# EAGLE schematic IoT4Bees-Ctrl_1V0 (EAGLE 7.7.0)
Assembly variants: Max, Std

## Sheet 1 of 22: MCU
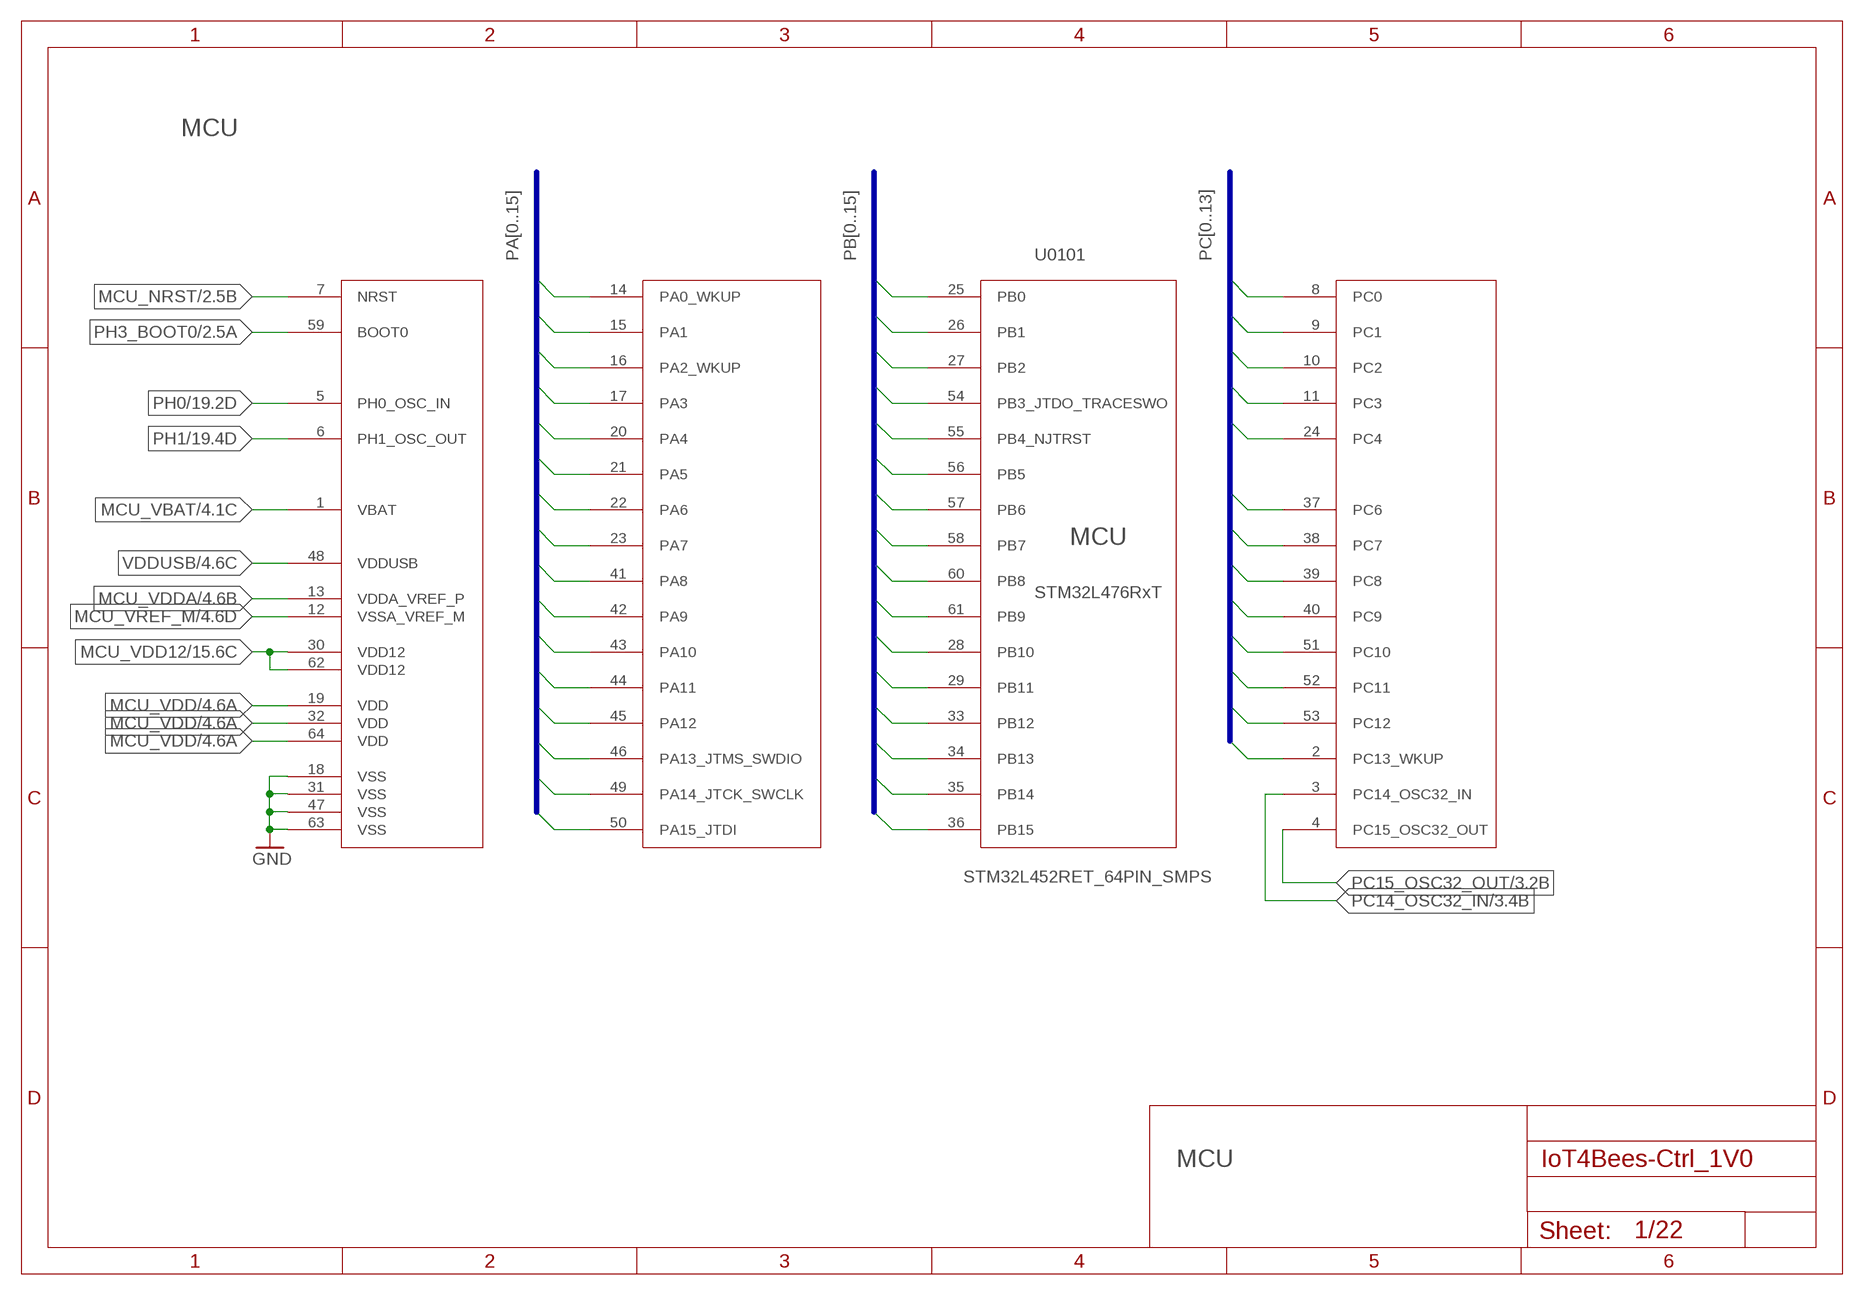
[diagram p0: schematic, sheet 1]

### Parts
U0101  STM32L452RET_64PIN_SMPS  [LQFP64]

### Nets
GND: U0101.18(VSS) U0101.31(VSS) U0101.47(VSS) U0101.63(VSS) ; also sheet 2,3,4,6,7,8,9,10,11,12,13,14,15,16,17,18,19,20,21,22
MCU_NRST: U0101.7(NRST) ; also sheet 2
MCU_VBAT: U0101.1(VBAT) ; also sheet 4
MCU_VDD: U0101.19(VDD) U0101.32(VDD) U0101.64(VDD) ; also sheet 4
MCU_VDD12: U0101.30(VDD12) U0101.62(VDD12) ; also sheet 15
MCU_VDDA: U0101.13(VDDA_VREF_P) ; also sheet 4
MCU_VREF_M: U0101.12(VSSA_VREF_M) ; also sheet 4
PA0: U0101.14(PA0_WKUP) ; also sheet 20
PA1: U0101.15(PA1) ; also sheet 21
PA2: U0101.16(PA2_WKUP) ; also sheet 21
PA3: U0101.17(PA3)
PA4: U0101.20(PA4) ; also sheet 4
PA5: U0101.21(PA5) ; also sheet 21
PA6: U0101.22(PA6) ; also sheet 21
PA7: U0101.23(PA7) ; also sheet 21
PA8: U0101.41(PA8) ; also sheet 15
PA9: U0101.42(PA9) ; also sheet 5,6,7,8,11,21
PA10: U0101.43(PA10) ; also sheet 5,6,7,8,11,21
PA11: U0101.44(PA11) ; also sheet 12
PA12: U0101.45(PA12) ; also sheet 12
PA13: U0101.46(PA13_JTMS_SWDIO) ; also sheet 2
PA14: U0101.49(PA14_JTCK_SWCLK) ; also sheet 2
PA15: U0101.50(PA15_JTDI)
PB0: U0101.25(PB0) ; also sheet 18
PB1: U0101.26(PB1) ; also sheet 21
PB2: U0101.27(PB2)
PB3: U0101.54(PB3_JTDO_TRACESWO)
PB4: U0101.55(PB4_NJTRST)
PB5: U0101.56(PB5) ; also sheet 16
PB6: U0101.57(PB6) ; also sheet 12
PB7: U0101.58(PB7) ; also sheet 12
PB8: U0101.60(PB8) ; also sheet 20
PB9: U0101.61(PB9)
PB10 [mil6_nofill]: U0101.28(PB10) ; also sheet 21
PB11: U0101.29(PB11) ; also sheet 21
PB12: U0101.33(PB12) ; also sheet 17
PB13 [mil6_nofill]: U0101.34(PB13) ; also sheet 21
PB14: U0101.35(PB14) ; also sheet 14
PB15: U0101.36(PB15) ; also sheet 15
PC0 [mil6_nofill]: U0101.8(PC0) ; also sheet 21
PC1: U0101.9(PC1) ; also sheet 21
PC2 [mil6_nofill]: U0101.10(PC2) ; also sheet 21
PC3: U0101.11(PC3) ; also sheet 21
PC4: U0101.24(PC4) ; also sheet 18,21
PC6: U0101.37(PC6)
PC7: U0101.38(PC7) ; also sheet 11
PC8: U0101.39(PC8) ; also sheet 8
PC9: U0101.40(PC9) ; also sheet 7
PC10: U0101.51(PC10) ; also sheet 9,10
PC11: U0101.52(PC11) ; also sheet 9,10
PC12: U0101.53(PC12) ; also sheet 9,10
PC13: U0101.2(PC13_WKUP) ; also sheet 9,21
PC14_OSC32_IN: U0101.3(PC14_OSC32_IN) ; also sheet 3
PC15_OSC32_OUT: U0101.4(PC15_OSC32_OUT) ; also sheet 3
PH0: U0101.5(PH0_OSC_IN) ; also sheet 19
PH1: U0101.6(PH1_OSC_OUT) ; also sheet 19
PH3_BOOT0: U0101.59(BOOT0) ; also sheet 2
VDDUSB: U0101.48(VDDUSB) ; also sheet 4

### Buses
PB[0..15]
PA[0..15]
PC[0..13]

### Notes on the sheet
- MCU
- MCU
- STM32L476RxT
- MCU

## Sheet 2 of 22: MCU Debug
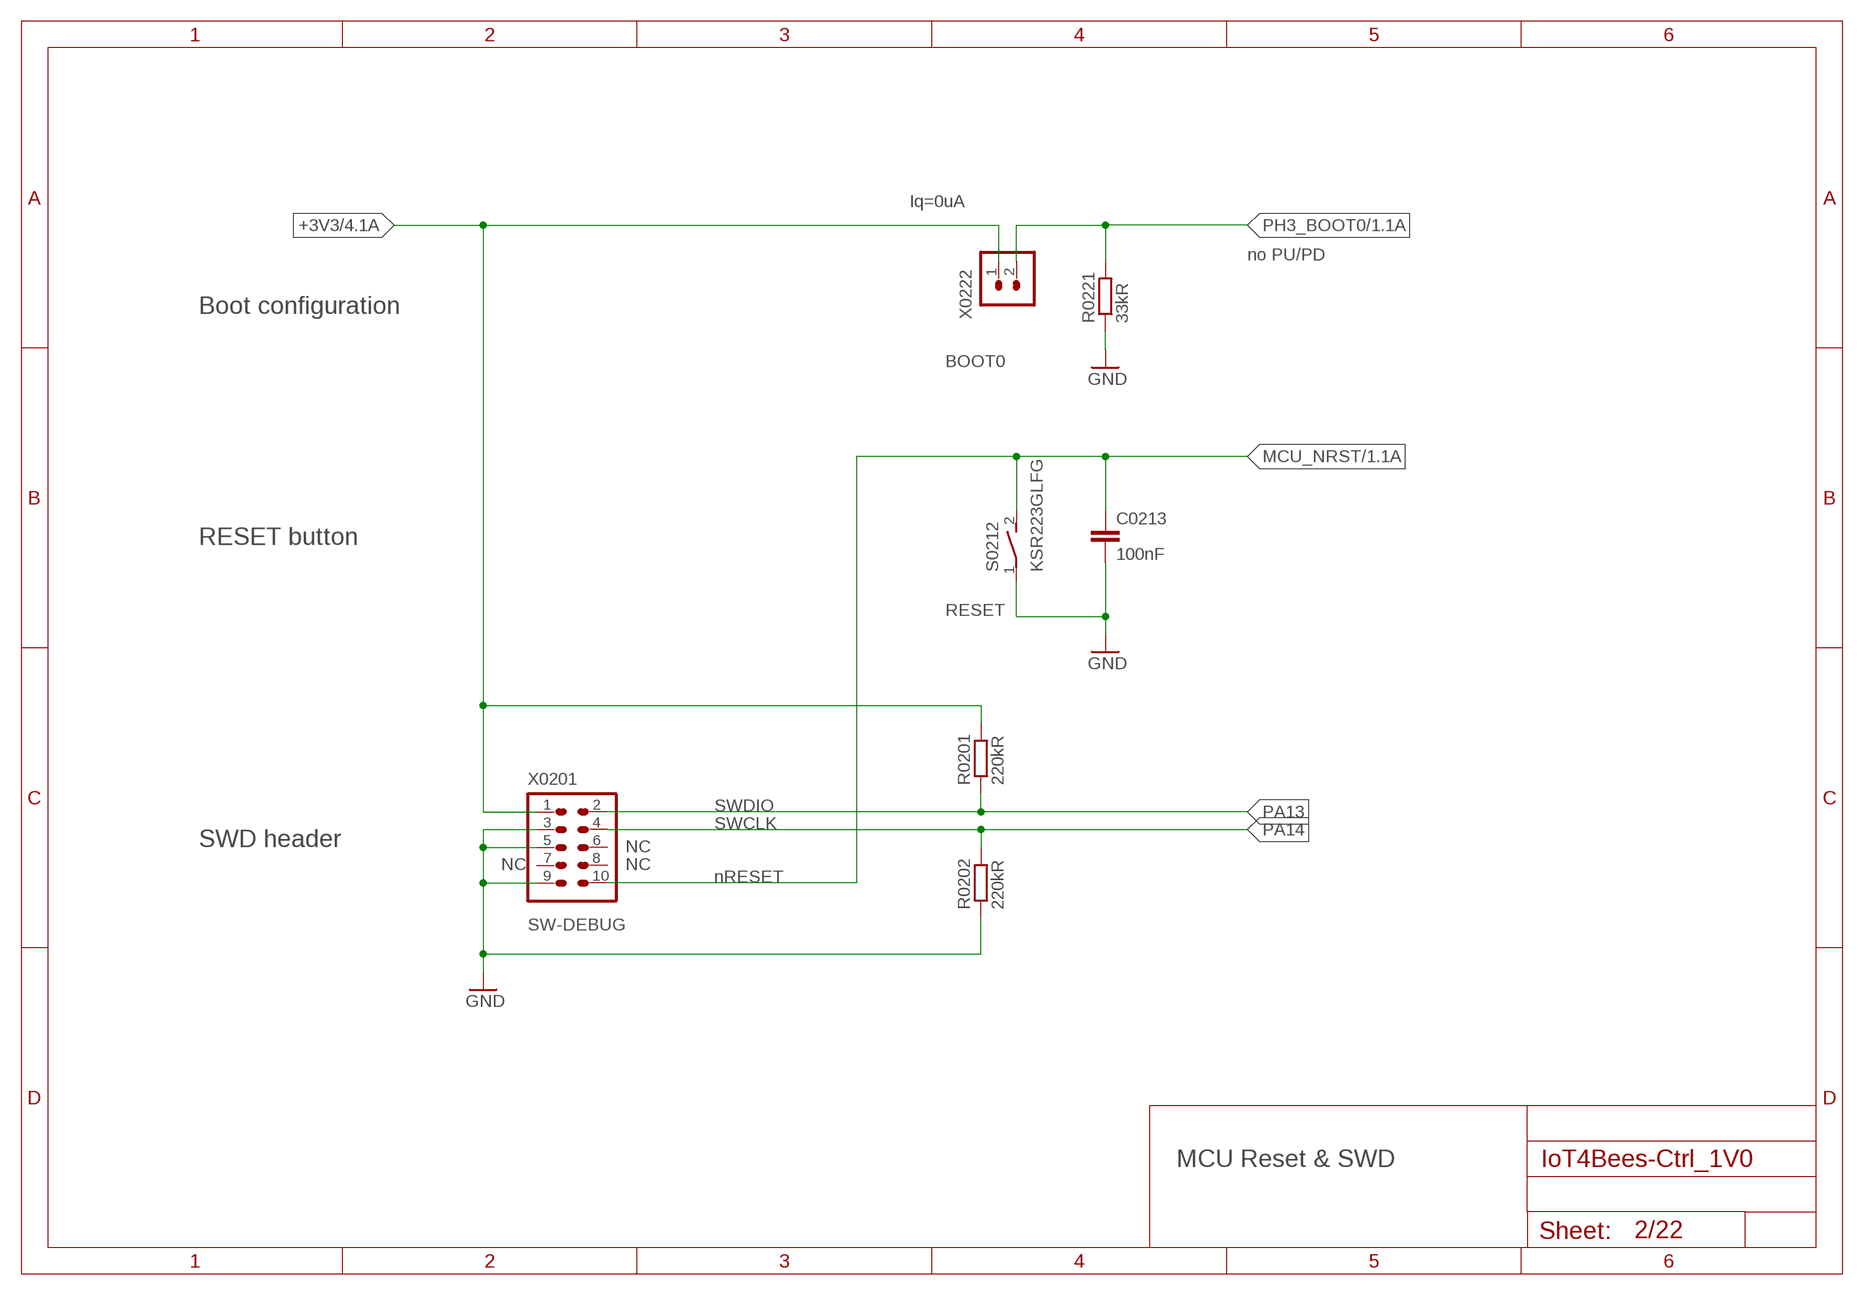
[diagram p1: schematic, sheet 2]

### Parts
C0213  100nF  C-EUC0402  [C0402]
R0201  220kR  R-EU_R0402  [R0402]
R0202  220kR  R-EU_R0402  [R0402]
R0221  33kR  R-EU_R0402  [R0402]
S0212  KSR223GLFG  KSR223G_SMD_1POL  [KSR223G_SMD_1POL]  (not fitted in variant Std)
X0201  FTSH-105-01-F-D-K  2X05_1MM27_SHROUDED_CORTEX_JTAG_SWD"  [2X05_1MM27_SHROUDED_CORTEX_JTAG_SWD]  (not fitted in variant Std)
X0222  HEADER-1X2  [1X02]  (not fitted in variant Std)

### Nets
+3V3: R0201.2 X0201.1 X0222.1 ; also sheet 4,13,14,15,16,17,18,20,21
GND: C0213.2 R0202.1 R0221.1 S0212.1(P) X0201.3 X0201.5 X0201.9 ; also sheet 1,3,4,6,7,8,9,10,11,12,13,14,15,16,17,18,19,20,21,22
MCU_NRST: C0213.1 S0212.2(S) X0201.10 ; also sheet 1
PA13: R0201.1 X0201.2 ; also sheet 1
PA14: R0202.2 X0201.4 ; also sheet 1
PH3_BOOT0: R0221.2 X0222.2 ; also sheet 1
Unconnected: X0201.6 X0201.7 X0201.8

### Notes on the sheet
- Iq=0uA
- no PU/PD
- Boot configuration
- BOOT0
- RESET button
- RESET
- SWDIO
- SWCLK
- SWD header
- NC
- NC | NC
- nRESET
- SW-DEBUG
- MCU Reset & SWD

## Sheet 3 of 22: MCU LSE 32.768 kHz
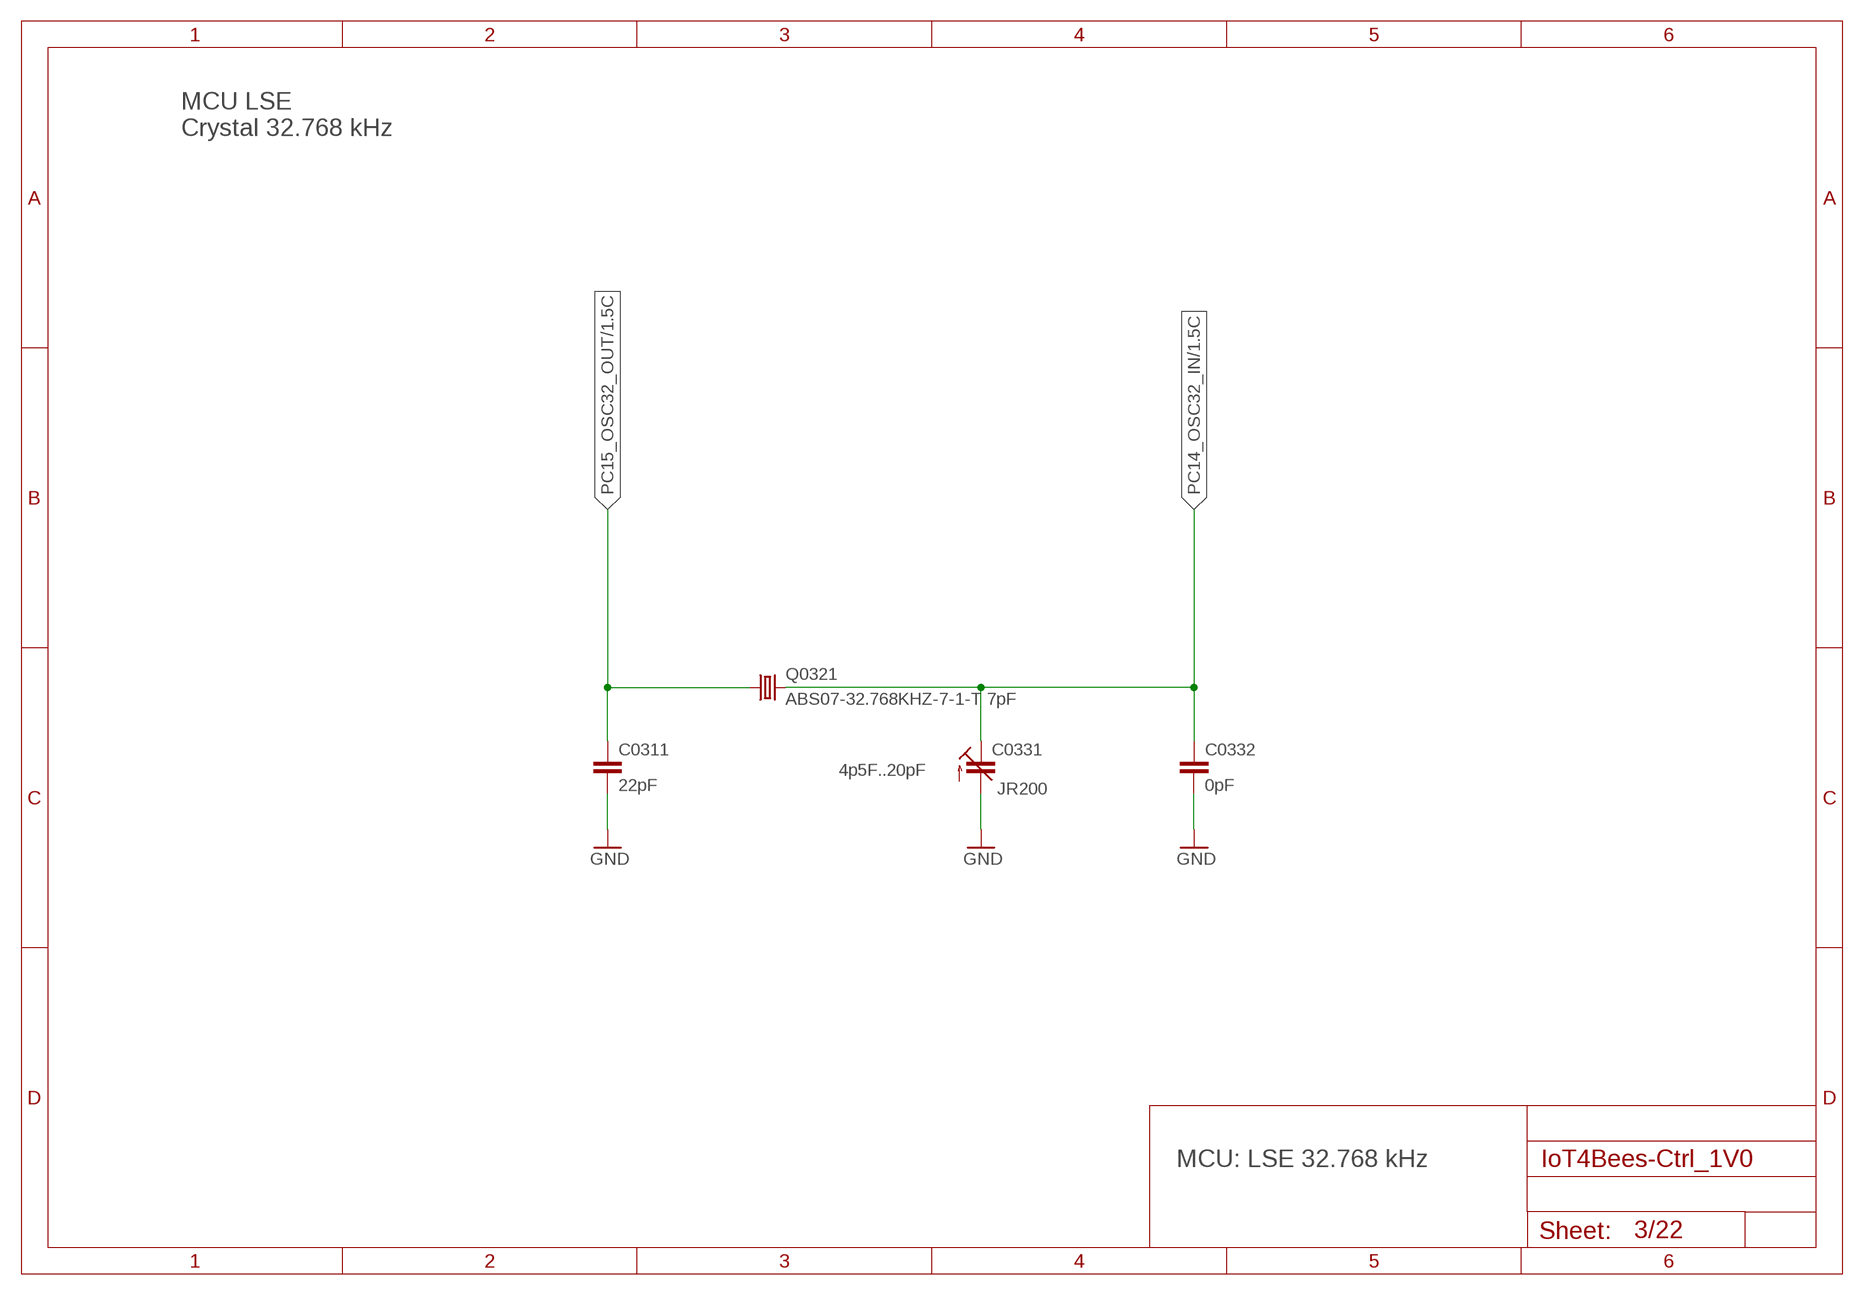
[diagram p2: schematic, sheet 3]

### Parts
C0311  22pF  C-EUC0402  [C0402]
C0331  JR200  C-TRIMM3MM2_2MM5  [3MM2_X_2MM5]  (not fitted in variant Std)
C0332  0pF  C-EUC0402  [C0402]  (variant Std: 10pF)  (not fitted in variant Max)
Q0321  ABS07-32.768KHZ-7-1-T 7pF  ABS07-32.768KHZ  [ABS07]

### Nets
GND: C0311.2 C0331.+(A) C0332.2 ; also sheet 1,2,4,6,7,8,9,10,11,12,13,14,15,16,17,18,19,20,21,22
PC14_OSC32_IN: C0331.-(E) C0332.1 Q0321.2 ; also sheet 1
PC15_OSC32_OUT: C0311.1 Q0321.1 ; also sheet 1

### Notes on the sheet
- MCU LSE
  Crystal 32.768 kHz
- 4p5F..20pF
- MCU: LSE 32.768 kHz

## Sheet 4 of 22: MCU Power Distribution
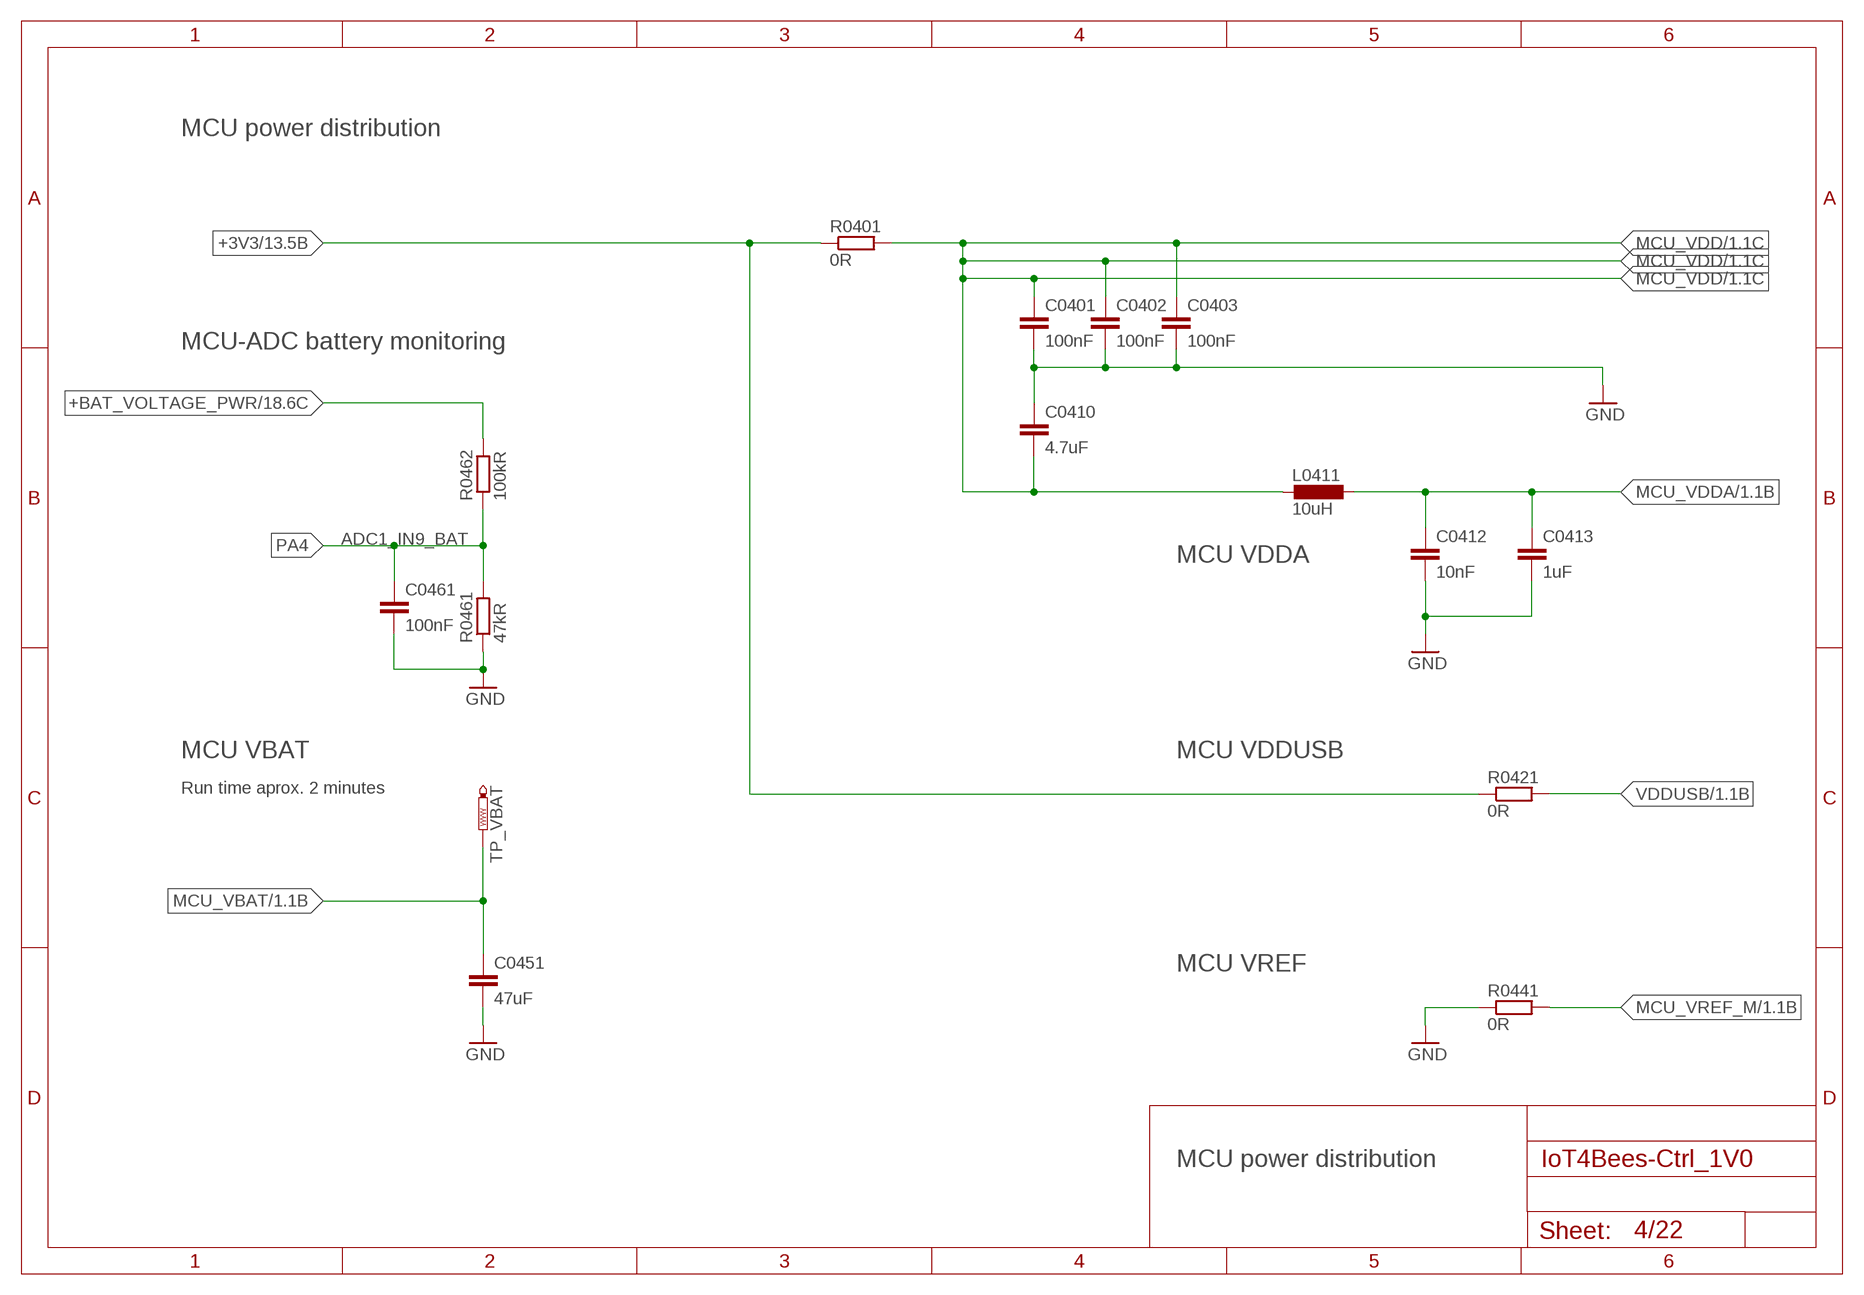
[diagram p3: schematic, sheet 4]

### Parts
C0401  100nF  C-EUC0402  [C0402]
C0402  100nF  C-EUC0402  [C0402]
C0403  100nF  C-EUC0402  [C0402]
C0410  4.7uF  C-EUC0603  [C0603]
C0412  10nF  C-EUC0402  [C0402]
C0413  1uF  C-EUC0402  [C0402]
C0451  47uF  C-EUC0805  [C0805]
C0461  100nF  C-EUC0402  [C0402]
L0411  10uH  L-EUL0603  [L0603]
R0401  0R  R-EU_R0402  [R0402]
R0421  0R  R-EU_R0402  [R0402]
R0441  0R  R-EU_R0402  [R0402]
R0461  47kR  R-EU_R0402  [R0402]
R0462  100kR  R-EU_R0402  [R0402]
TP_VBAT  PTR1TP06R  [TP06R]

### Nets
+3V3: R0401.1 R0421.1 ; also sheet 2,13,14,15,16,17,18,20,21
+BAT_VOLTAGE_PWR: R0462.2 ; also sheet 18,21
GND: C0401.2 C0402.2 C0403.2 C0410.1 C0412.2 C0413.2 C0451.2 C0461.2 R0441.1 R0461.1 ; also sheet 1,2,3,6,7,8,9,10,11,12,13,14,15,16,17,18,19,20,21,22
MCU_VBAT: C0451.1 TP_VBAT.TP ; also sheet 1
MCU_VDD: C0401.1 C0402.1 C0403.1 C0410.2 L0411.1 R0401.2 ; also sheet 1
MCU_VDDA: C0412.1 C0413.1 L0411.2 ; also sheet 1
MCU_VREF_M: R0441.2 ; also sheet 1
PA4: C0461.1 R0461.2 R0462.1 ; also sheet 1
VDDUSB: R0421.2 ; also sheet 1

### Notes on the sheet
- MCU power distribution
- MCU-ADC battery monitoring
- ADC1_IN9_BAT
- MCU VDDA
- MCU VBAT | MCU VDDUSB
- Run time aprox. 2 minutes
- MCU VREF
- MCU power distribution

## Sheet 5 of 22: I2C1 Termination / Addr space
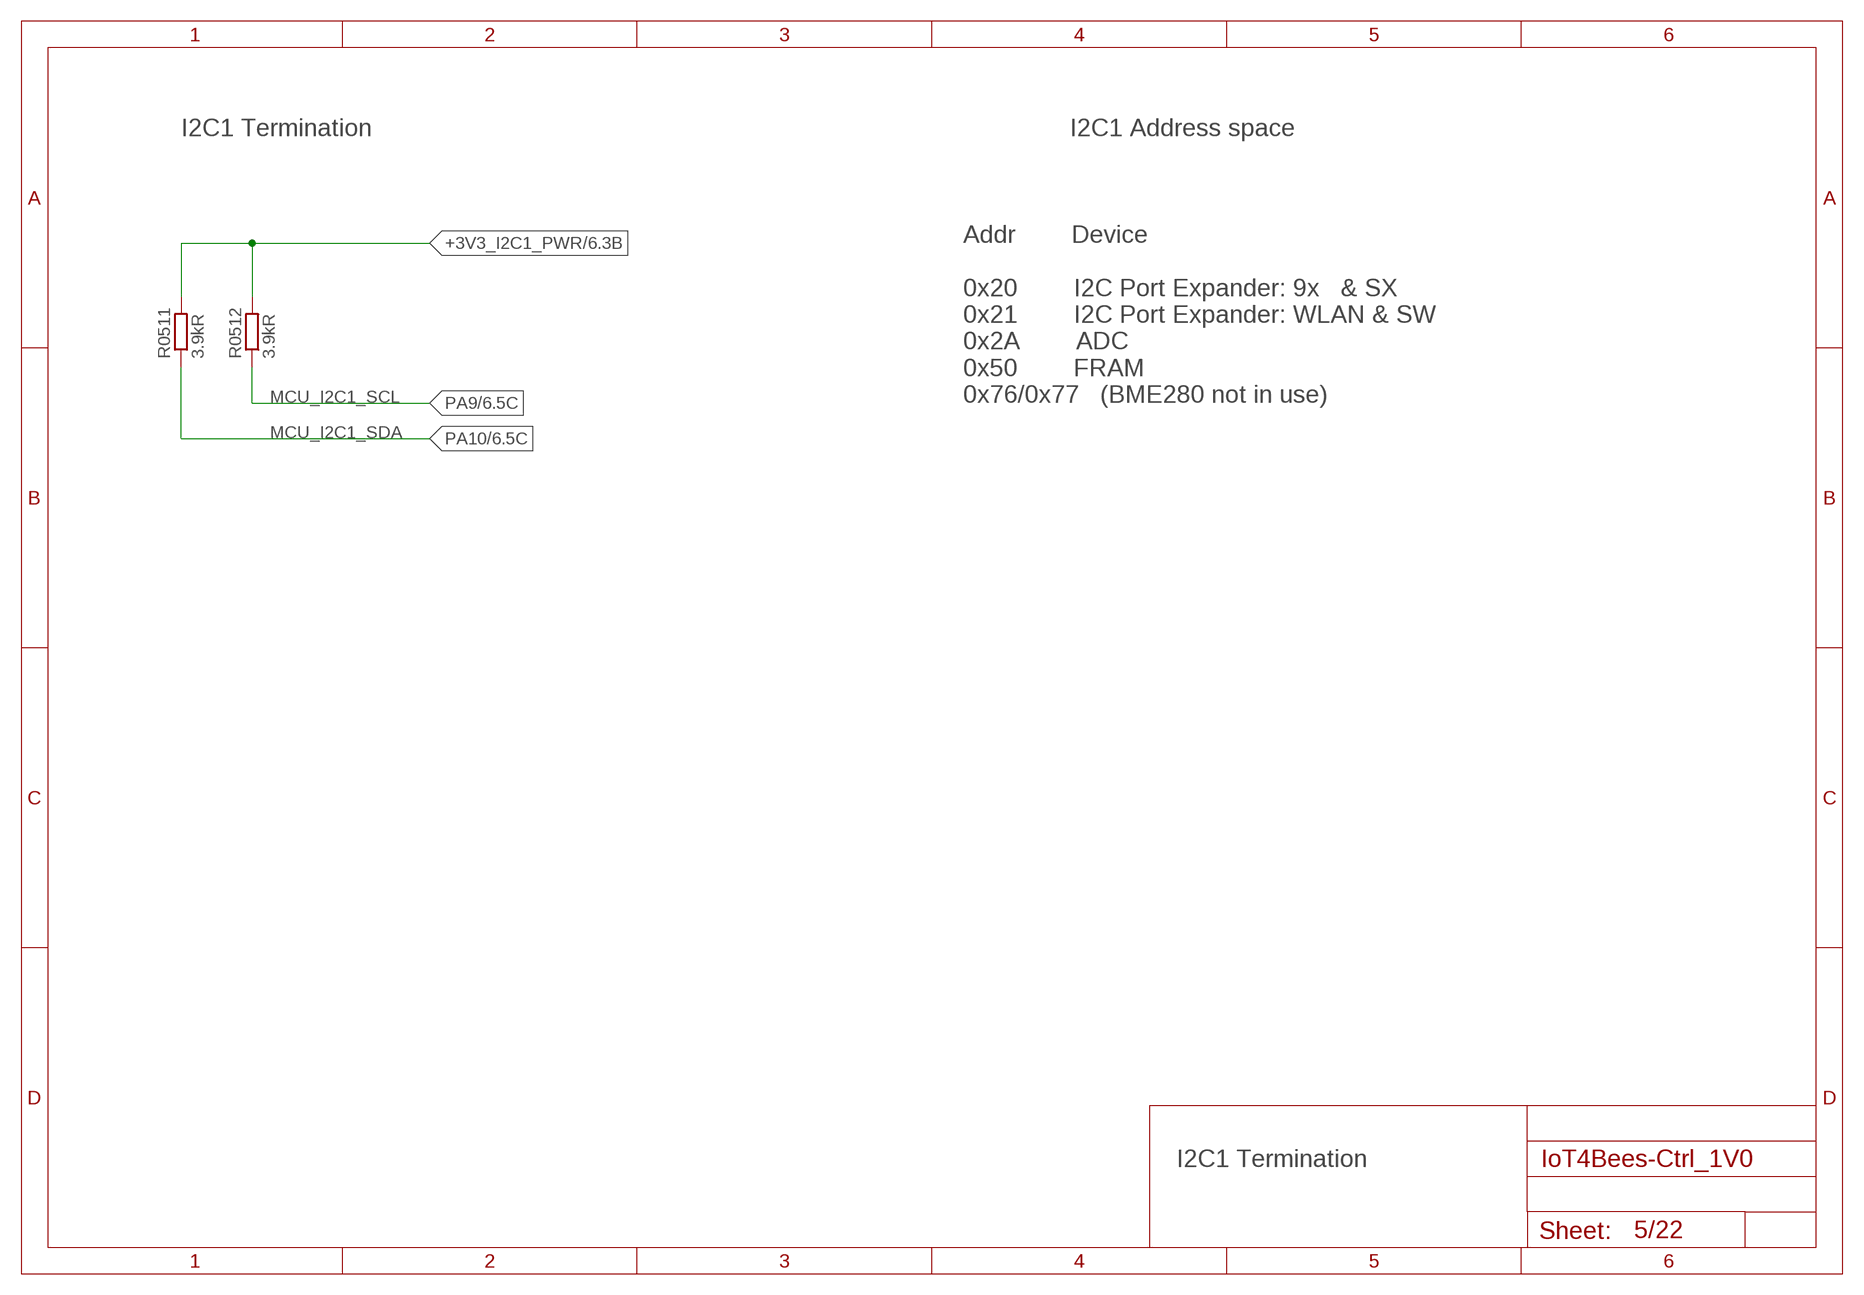
[diagram p4: schematic, sheet 5]

### Parts
R0511  3.9kR  R-EU_R0402  [R0402]
R0512  3.9kR  R-EU_R0402  [R0402]

### Nets
+3V3_I2C1_PWR: R0511.2 R0512.2 ; also sheet 6,7,8,11,15,21
PA9: R0512.1 ; also sheet 1,6,7,8,11,21
PA10: R0511.1 ; also sheet 1,6,7,8,11,21

### Notes on the sheet
- I2C1 Termination | I2C1 Address space
- MCU_I2C1_SCL
- Addr        Device
  
  0x20        I2C Port Expander: 9x   & SX
  0x21        I2C Port Expander: WLAN & SW
  0x2A        ADC
  0x50        FRAM
  0x76/0x77   (BME280 not in use)
- MCU_I2C1_SDA
- I2C1 Termination

## Sheet 6 of 22: I2C1 - FRAM 64k x 8b
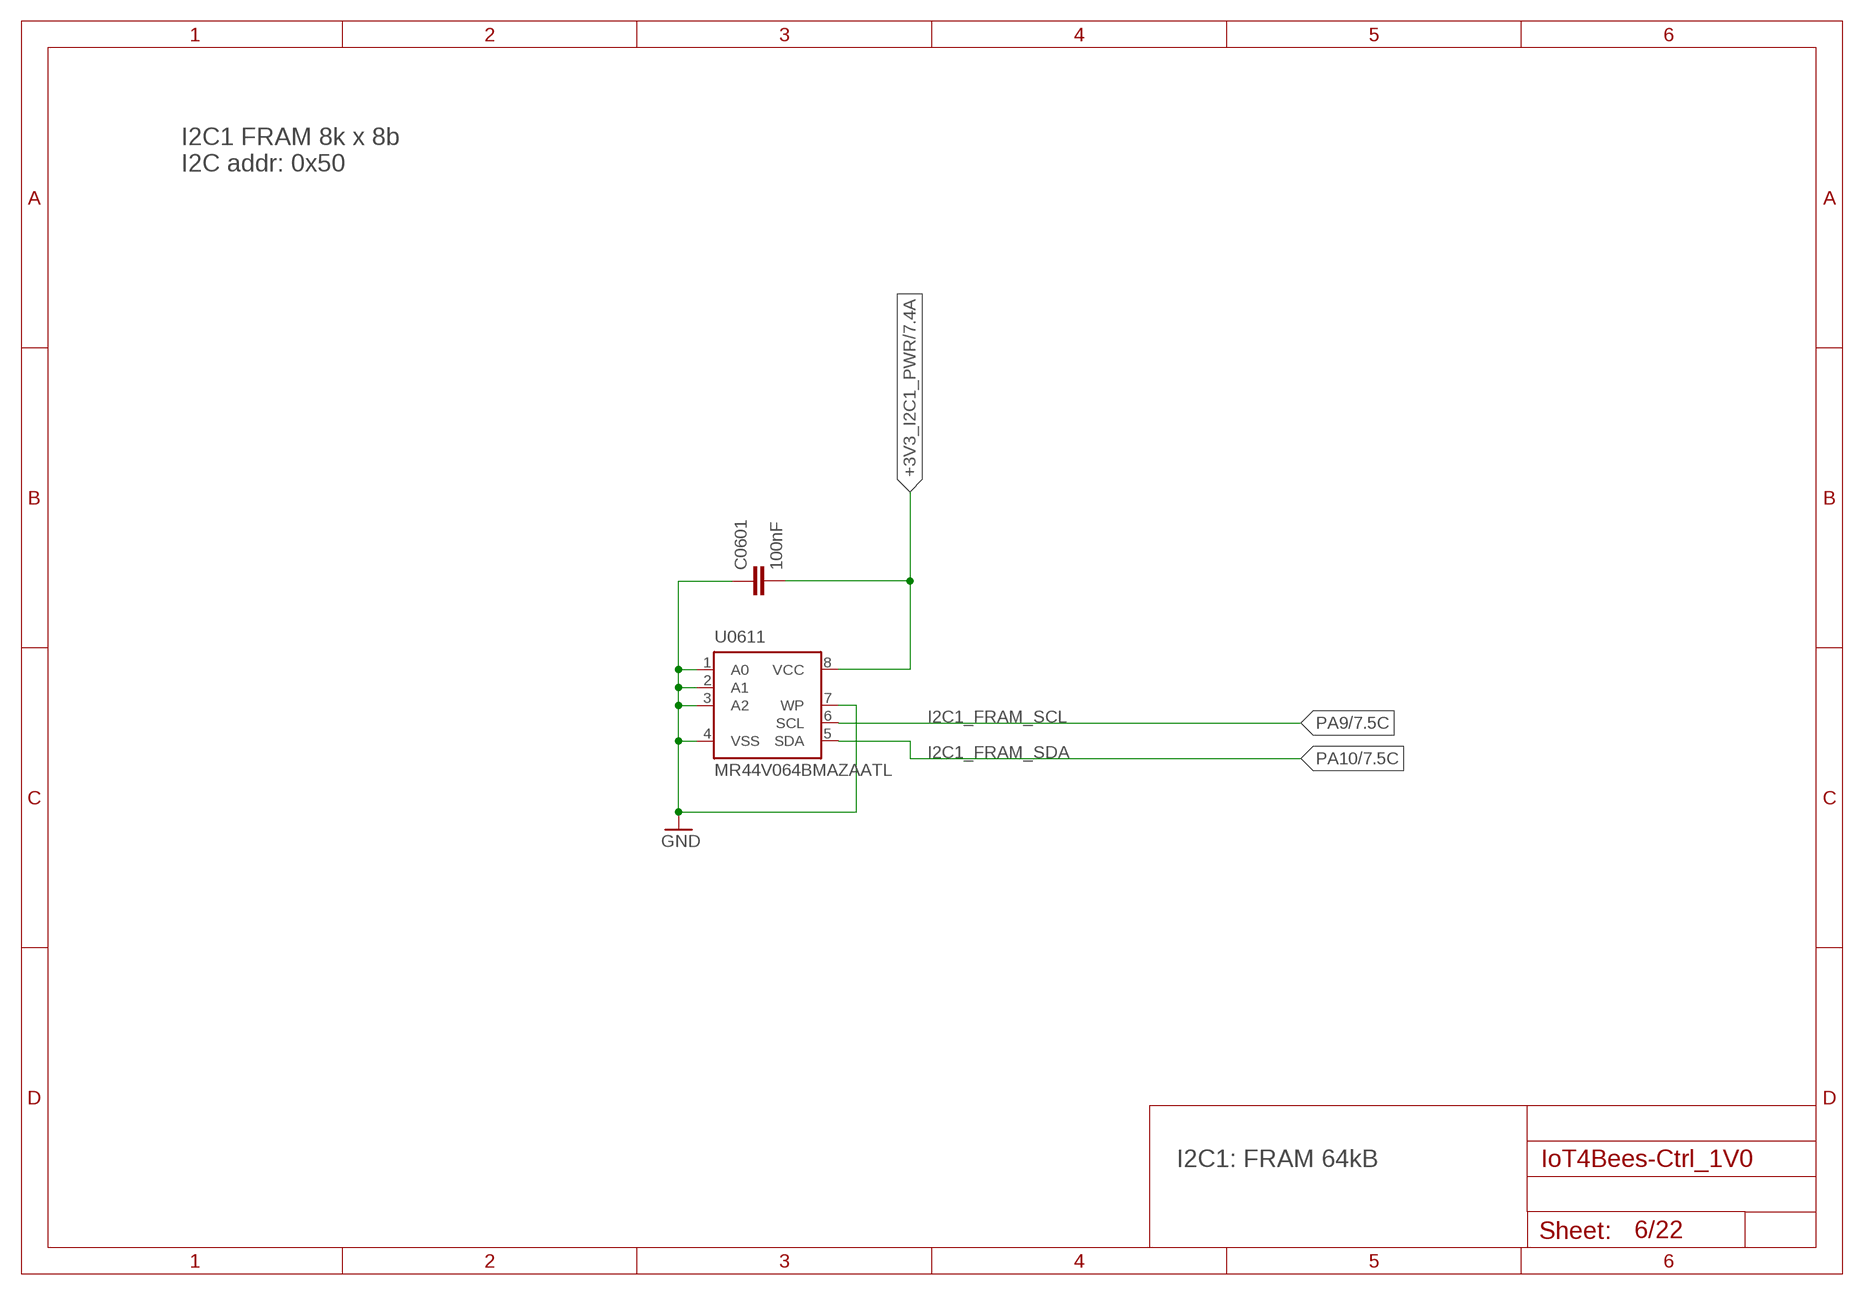
[diagram p5: schematic, sheet 6]

### Parts
C0601  100nF  C-EUC0402  [C0402]
U0611  MR44V064BMAZAATL  FEDR44V064B-02_FRAM_8K-8_I2C  [SOIC8_150MIL]

### Nets
+3V3_I2C1_PWR: C0601.2 U0611.8(VCC) ; also sheet 5,7,8,11,15,21
GND: C0601.1 U0611.1(A0) U0611.2(A1) U0611.3(A2) U0611.4(VSS) U0611.7(WP) ; also sheet 1,2,3,4,7,8,9,10,11,12,13,14,15,16,17,18,19,20,21,22
PA9: U0611.6(SCL) ; also sheet 1,5,7,8,11,21
PA10: U0611.5(SDA) ; also sheet 1,5,7,8,11,21

### Notes on the sheet
- I2C1 FRAM 8k x 8b
  I2C addr: 0x50
- I2C1_FRAM_SCL
- I2C1_FRAM_SDA
- I2C1: FRAM 64kB

## Sheet 7 of 22: I2C1 - ADC
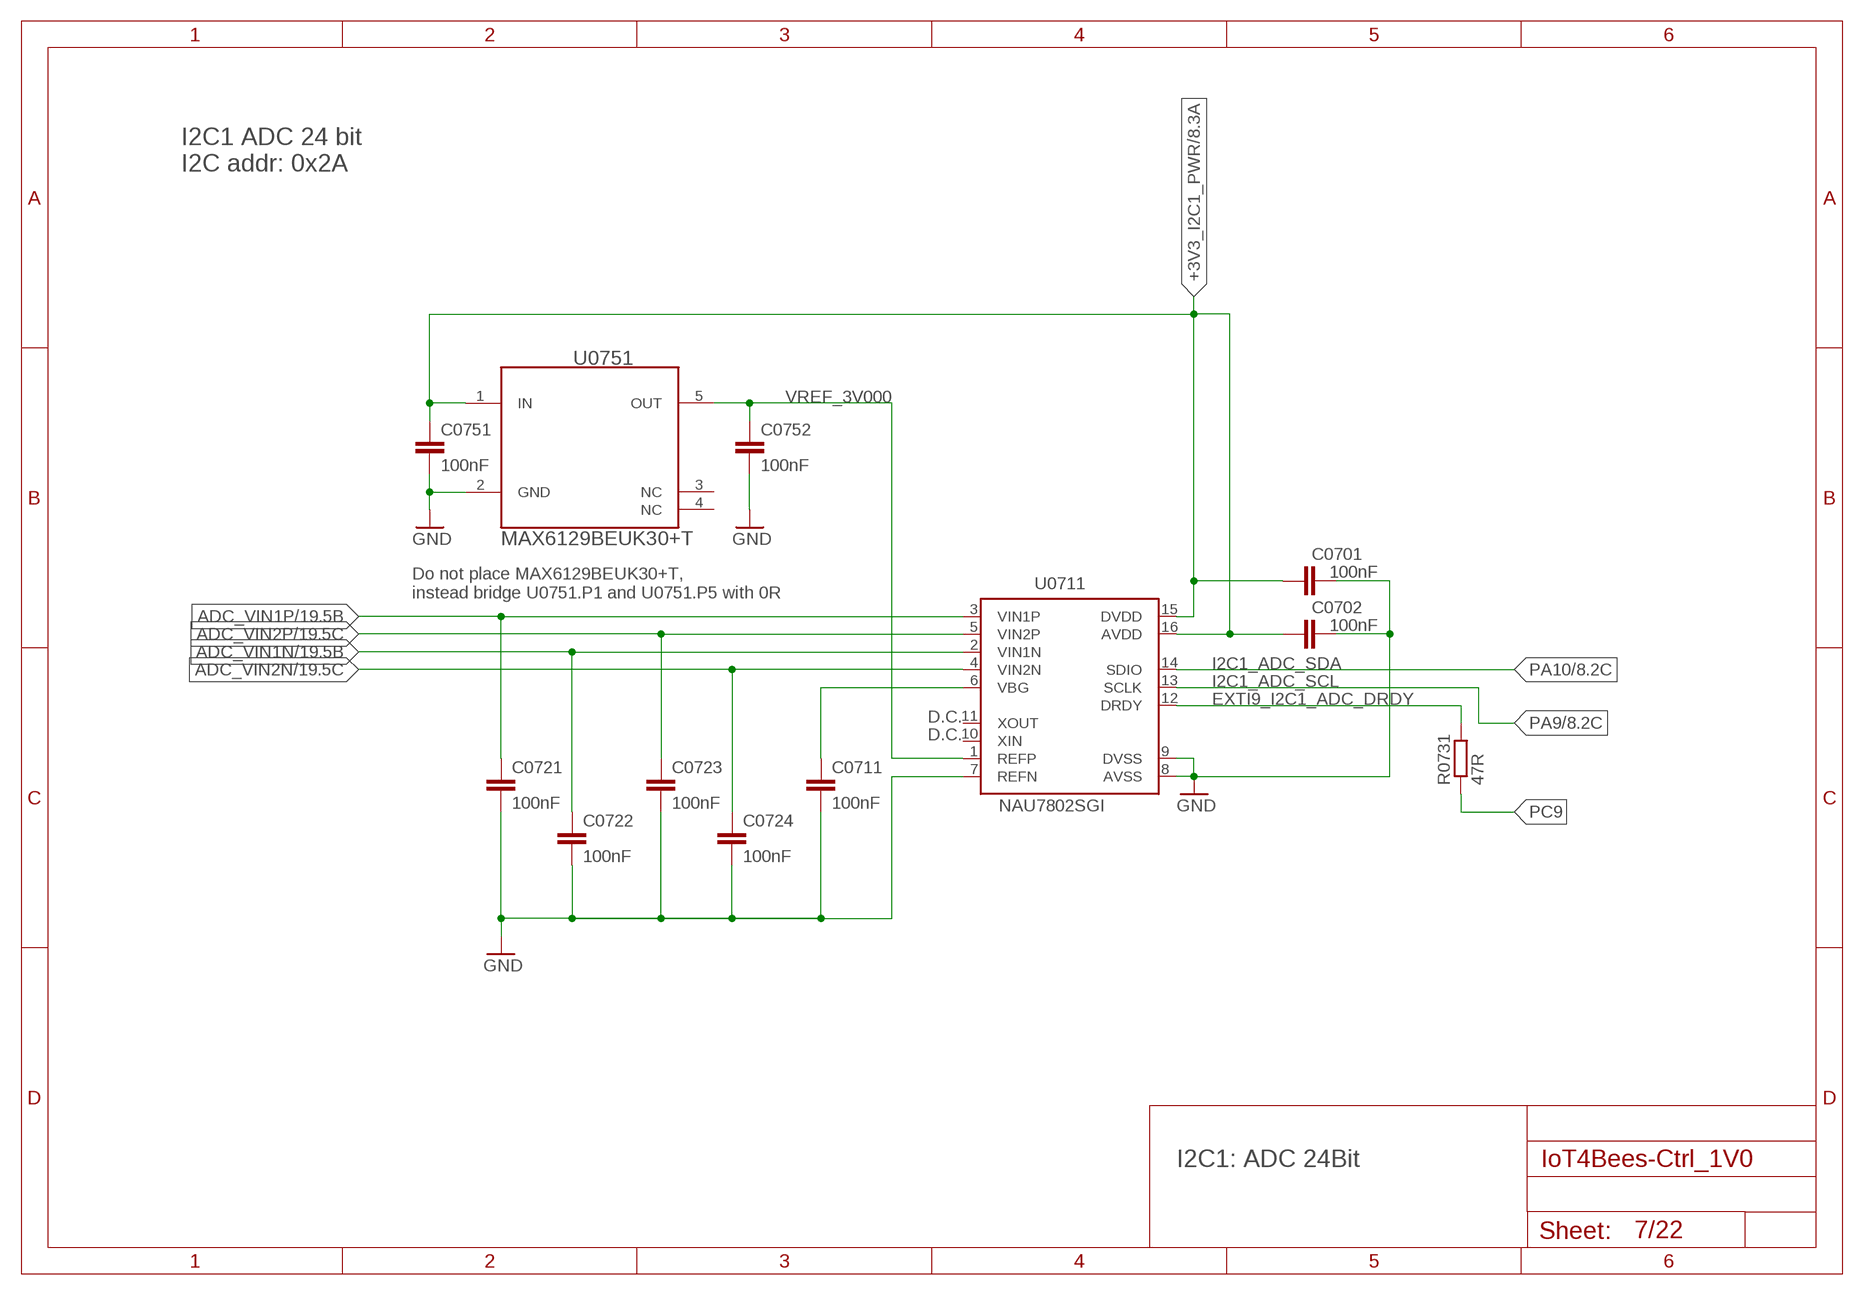
[diagram p6: schematic, sheet 7]

### Parts
C0701  100nF  C-EUC0402  [C0402]  (not fitted in variant Std)
C0702  100nF  C-EUC0402  [C0402]
C0711  100nF  C-EUC0402  [C0402]
C0721  100nF  C-EUC0402  [C0402]
C0722  100nF  C-EUC0402  [C0402]
C0723  100nF  C-EUC0402  [C0402]
C0724  100nF  C-EUC0402  [C0402]
C0751  100nF  C-EUC0402  [C0402]
C0752  100nF  C-EUC0402  [C0402]
R0731  47R  R-EU_R0402  [R0402]
U0711  NAU7802SGI  NAU7802_24BIT_I2C  [LSOP16]
U0751  MAX6129BEUK30+T  MAX6129_VREF  [SOT23P290X160-5N]

### Nets
+3V3_I2C1_PWR: C0701.1 C0702.1 C0751.1 U0711.15(DVDD) U0711.16(AVDD) U0751.1(IN) ; also sheet 5,6,8,11,15,21
ADC_VBG: C0711.1 U0711.6(VBG)
ADC_VIN1N: C0722.1 U0711.2(VIN1N) ; also sheet 19
ADC_VIN1P: C0721.1 U0711.3(VIN1P) ; also sheet 19
ADC_VIN2N: C0724.1 U0711.4(VIN2N) ; also sheet 19
ADC_VIN2P: C0723.1 U0711.5(VIN2P) ; also sheet 19
EXTI9_I2C1_ADC_DRDY: R0731.2 U0711.12(DRDY)
GND: C0701.2 C0702.2 C0711.2 C0721.2 C0722.2 C0723.2 C0724.2 C0751.2 C0752.2 U0711.7(REFN) U0711.8(AVSS) U0711.9(DVSS) U0751.2(GND) ; also sheet 1,2,3,4,6,8,9,10,11,12,13,14,15,16,17,18,19,20,21,22
PA9: U0711.13(SCLK) ; also sheet 1,5,6,8,11,21
PA10: U0711.14(SDIO) ; also sheet 1,5,6,8,11,21
PC9: R0731.1 ; also sheet 1
VREF_3V000: C0752.1 U0711.1(REFP) U0751.5(OUT)
Unconnected: U0711.10(XIN) U0711.11(XOUT) U0751.3(NC) U0751.4(NC)

### Notes on the sheet
- I2C1 ADC 24 bit
  I2C addr: 0x2A
- Do not place MAX6129BEUK30+T,
  instead bridge U0751.P1 and U0751.P5 with 0R
- I2C1_ADC_SDA
- I2C1_ADC_SCL
- D.C.
- D.C.
- I2C1: ADC 24Bit

## Sheet 8 of 22: I2C1 - PORT EXPANDER A: 9x, SX
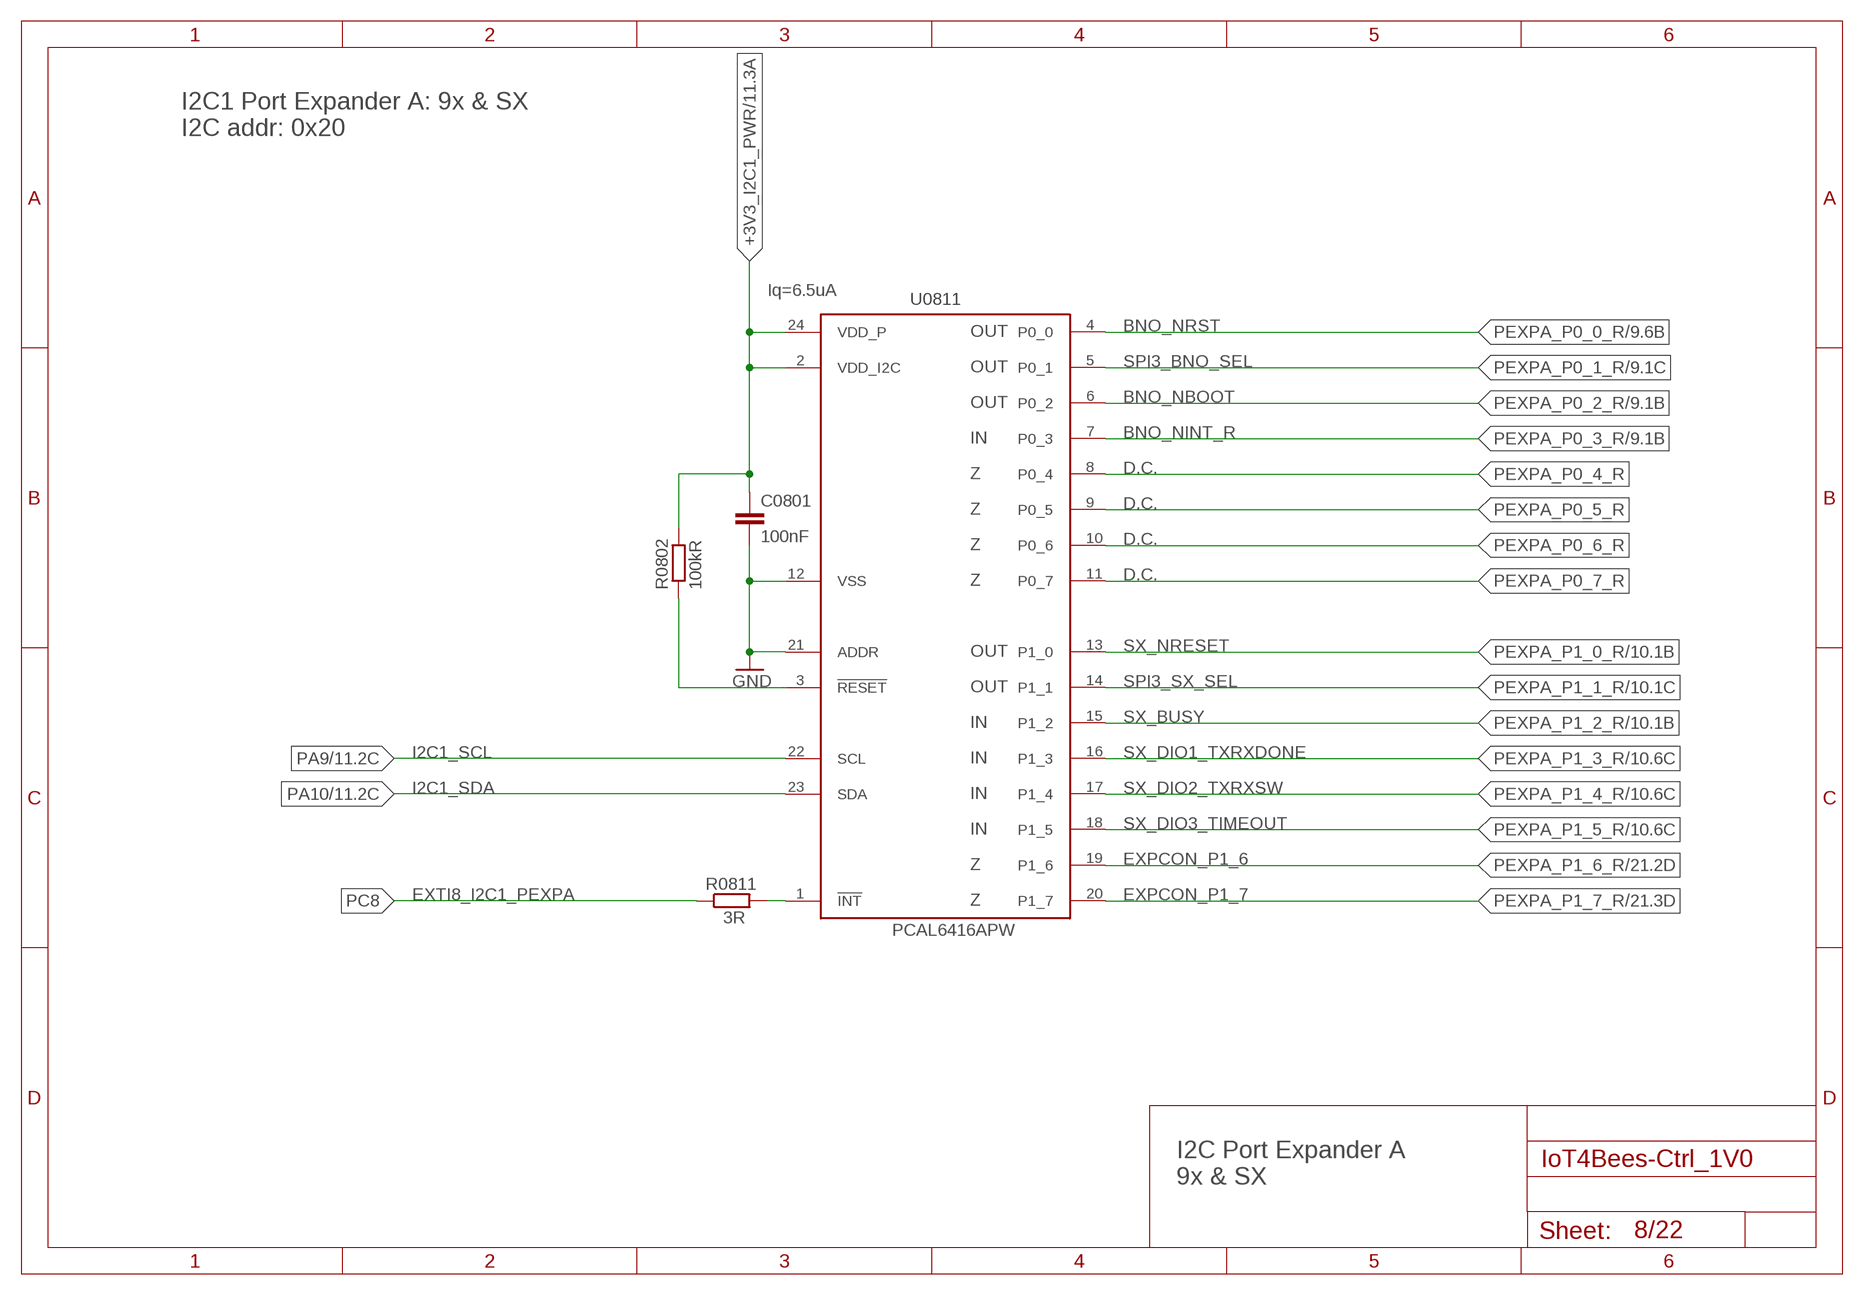
[diagram p7: schematic, sheet 8]

### Parts
C0801  100nF  C-EUC0402  [C0402]
R0802  100kR  R-EU_R0402  [R0402]
R0811  3R  R-EU_R0402  [R0402]
U0811  PCAL6416APW  [TSSOP24_SOT355-1]

### Nets
+3V3_I2C1_PWR: C0801.1 R0802.2 U0811.2(VDD_I2C) U0811.24(VDD_P) ; also sheet 5,6,7,11,15,21
GND: C0801.2 U0811.12(VSS) U0811.21(ADDR) ; also sheet 1,2,3,4,6,7,9,10,11,12,13,14,15,16,17,18,19,20,21,22
PA9: U0811.22(SCL) ; also sheet 1,5,6,7,11,21
PA10: U0811.23(SDA) ; also sheet 1,5,6,7,11,21
PC8: R0811.1 ; also sheet 1
PEXPA_INTN: R0811.2 U0811.1(!INT)
PEXPA_P0_0_R: U0811.4(P0_0) ; also sheet 9
PEXPA_P0_1_R: U0811.5(P0_1) ; also sheet 9
PEXPA_P0_2_R: U0811.6(P0_2) ; also sheet 9
PEXPA_P0_3_R: U0811.7(P0_3) ; also sheet 9
PEXPA_P0_4_R: U0811.8(P0_4)
PEXPA_P0_5_R: U0811.9(P0_5)
PEXPA_P0_6_R: U0811.10(P0_6)
PEXPA_P0_7_R: U0811.11(P0_7)
PEXPA_P1_0_R: U0811.13(P1_0) ; also sheet 10
PEXPA_P1_1_R: U0811.14(P1_1) ; also sheet 10
PEXPA_P1_2_R: U0811.15(P1_2) ; also sheet 10
PEXPA_P1_3_R: U0811.16(P1_3) ; also sheet 10
PEXPA_P1_4_R: U0811.17(P1_4) ; also sheet 10
PEXPA_P1_5_R: U0811.18(P1_5) ; also sheet 10
PEXPA_P1_6_R: U0811.19(P1_6) ; also sheet 21
PEXPA_P1_7_R: U0811.20(P1_7) ; also sheet 21
PEXPA_RESET: R0802.1 U0811.3(!RESET)

### Notes on the sheet
- I2C1 Port Expander A: 9x & SX
  I2C addr: 0x20
- Iq=6.5uA
- BNO_NRST
- OUT
- SPI3_BNO_SEL
- OUT
- BNO_NBOOT
- OUT
- BNO_NINT_R
- IN
- D.C.
- Z
- D.C.
- Z
- D.C.
- Z
- D.C.
- Z
- SX_NRESET
- OUT
- SPI3_SX_SEL
- OUT
- SX_BUSY
- IN
- I2C1_SCL | SX_DIO1_TXRXDONE
- IN
- I2C1_SDA | SX_DIO2_TXRXSW
- IN
- SX_DIO3_TIMEOUT
- IN
- EXPCON_P1_6
- Z
- EXTI8_I2C1_PEXPA | EXPCON_P1_7
- Z
- I2C Port Expander A
  9x & SX

## Sheet 9 of 22: SPI3 - 9 axis motion sensor
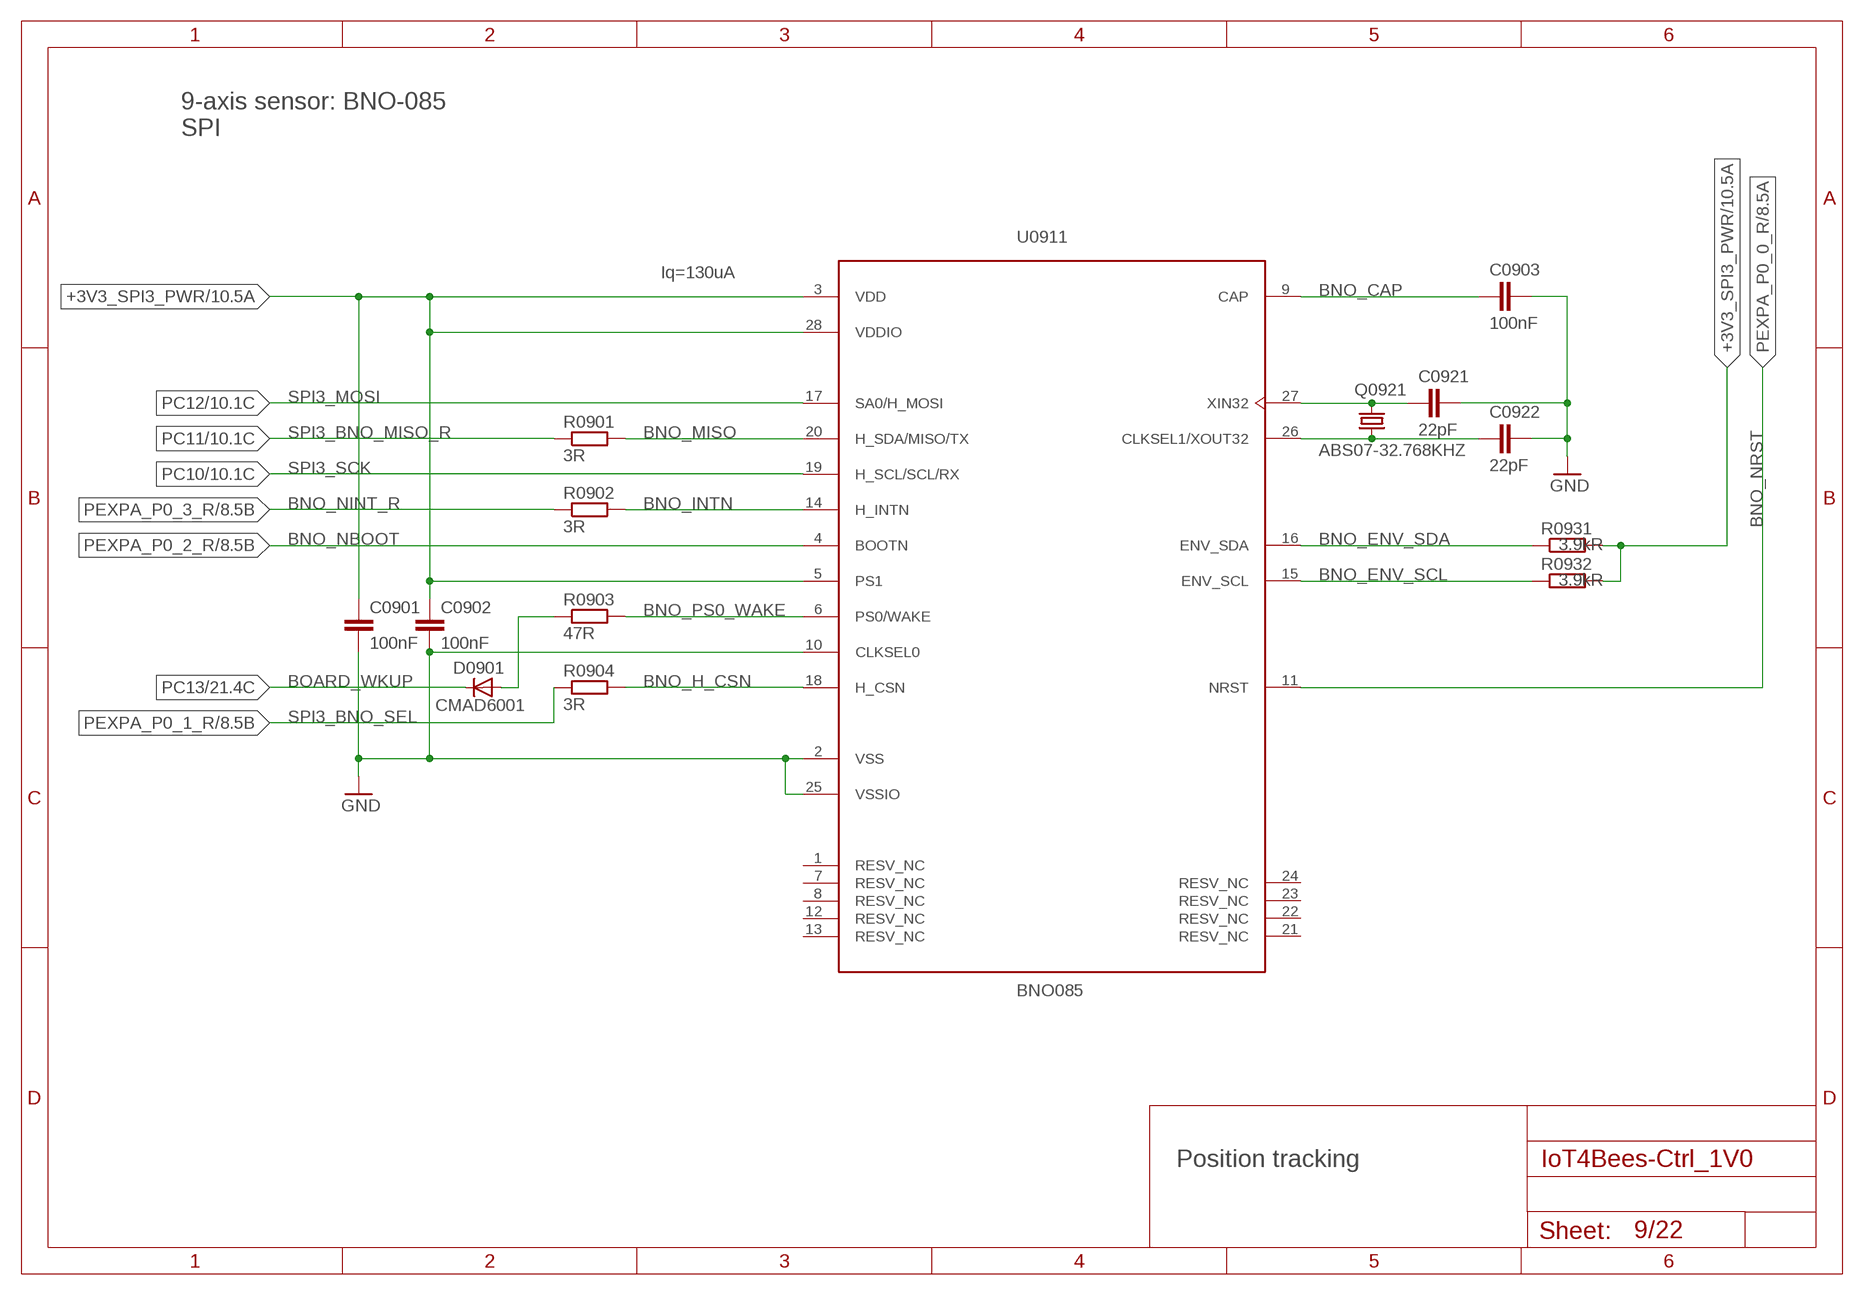
[diagram p8: schematic, sheet 9]

### Parts
C0901  100nF  C-EUC0402  [C0402]  (not fitted in variant Std)
C0902  100nF  C-EUC0402  [C0402]  (not fitted in variant Std)
C0903  100nF  C-EUC0402  [C0402]  (not fitted in variant Std)
C0921  22pF  C-EUC0402  [C0402]  (not fitted in variant Std)
C0922  22pF  C-EUC0402  [C0402]  (not fitted in variant Std)
D0901  CMAD6001  D_SOD923  [SOD923]  (not fitted in variant Std)
Q0921  ABS07-32.768KHZ  [ABS07]  (not fitted in variant Std)
R0901  3R  R-EU_R0402  [R0402]  (not fitted in variant Std)
R0902  3R  R-EU_R0402  [R0402]  (not fitted in variant Std)
R0903  47R  R-EU_R0402  [R0402]  (not fitted in variant Std)
R0904  3R  R-EU_R0402  [R0402]  (not fitted in variant Std)
R0931  3.9kR  R-EU_R0402  [R0402]  (not fitted in variant Std)
R0932  3.9kR  R-EU_R0402  [R0402]  (not fitted in variant Std)
U0911  BNO085  [BNO085_LGA28]  (not fitted in variant Std)

### Nets
+3V3_SPI3_PWR: C0901.1 C0902.1 R0931.2 R0932.2 U0911.3(VDD) U0911.5(PS1) U0911.28(VDDIO) ; also sheet 10,16,21
BNO085_PS0_WAKE_R: D0901.A R0903.1
BNO_CAP: C0903.1 U0911.9(CAP)
BNO_CLKSEL1_XOUT32: C0922.1 Q0921.1 U0911.26(CLKSEL1/XOUT32)
BNO_ENV_SCL: R0932.1 U0911.15(ENV_SCL)
BNO_ENV_SDA: R0931.1 U0911.16(ENV_SDA)
BNO_H_CSN: R0904.2 U0911.18(H_CSN)
BNO_INTN: R0902.2 U0911.14(H_INTN)
BNO_MISO: R0901.2 U0911.20(H_SDA/MISO/TX)
BNO_PS0_WAKE: R0903.2 U0911.6(PS0/WAKE)
BNO_XIN32: C0921.1 Q0921.2 U0911.27(XIN32)
GND: C0901.2 C0902.2 C0903.2 C0921.2 C0922.2 U0911.2(VSS) U0911.10(CLKSEL0) U0911.25(VSSIO) ; also sheet 1,2,3,4,6,7,8,10,11,12,13,14,15,16,17,18,19,20,21,22
PC10: U0911.19(H_SCL/SCL/RX) ; also sheet 1,10
PC11: R0901.1 ; also sheet 1,10
PC12: U0911.17(SA0/H_MOSI) ; also sheet 1,10
PC13: D0901.C ; also sheet 1,21
PEXPA_P0_0_R: U0911.11(NRST) ; also sheet 8
PEXPA_P0_1_R: R0904.1 ; also sheet 8
PEXPA_P0_2_R: U0911.4(BOOTN) ; also sheet 8
PEXPA_P0_3_R: R0902.1 ; also sheet 8
Unconnected: U0911.1(RESV_NC) U0911.7(RESV_NC) U0911.8(RESV_NC) U0911.12(RESV_NC) U0911.13(RESV_NC) U0911.21(RESV_NC) U0911.22(RESV_NC) U0911.23(RESV_NC) U0911.24(RESV_NC)

### Notes on the sheet
- 9-axis sensor: BNO-085
  SPI
- Iq=130uA
- SPI3_MOSI
- SPI3_BNO_MISO_R
- SPI3_SCK
- BNO_NINT_R
- BNO_NRST
- BNO_NBOOT
- BOARD_WKUP
- SPI3_BNO_SEL
- Position tracking

## Sheet 10 of 22: SPI3 - LoRaWAN TRX
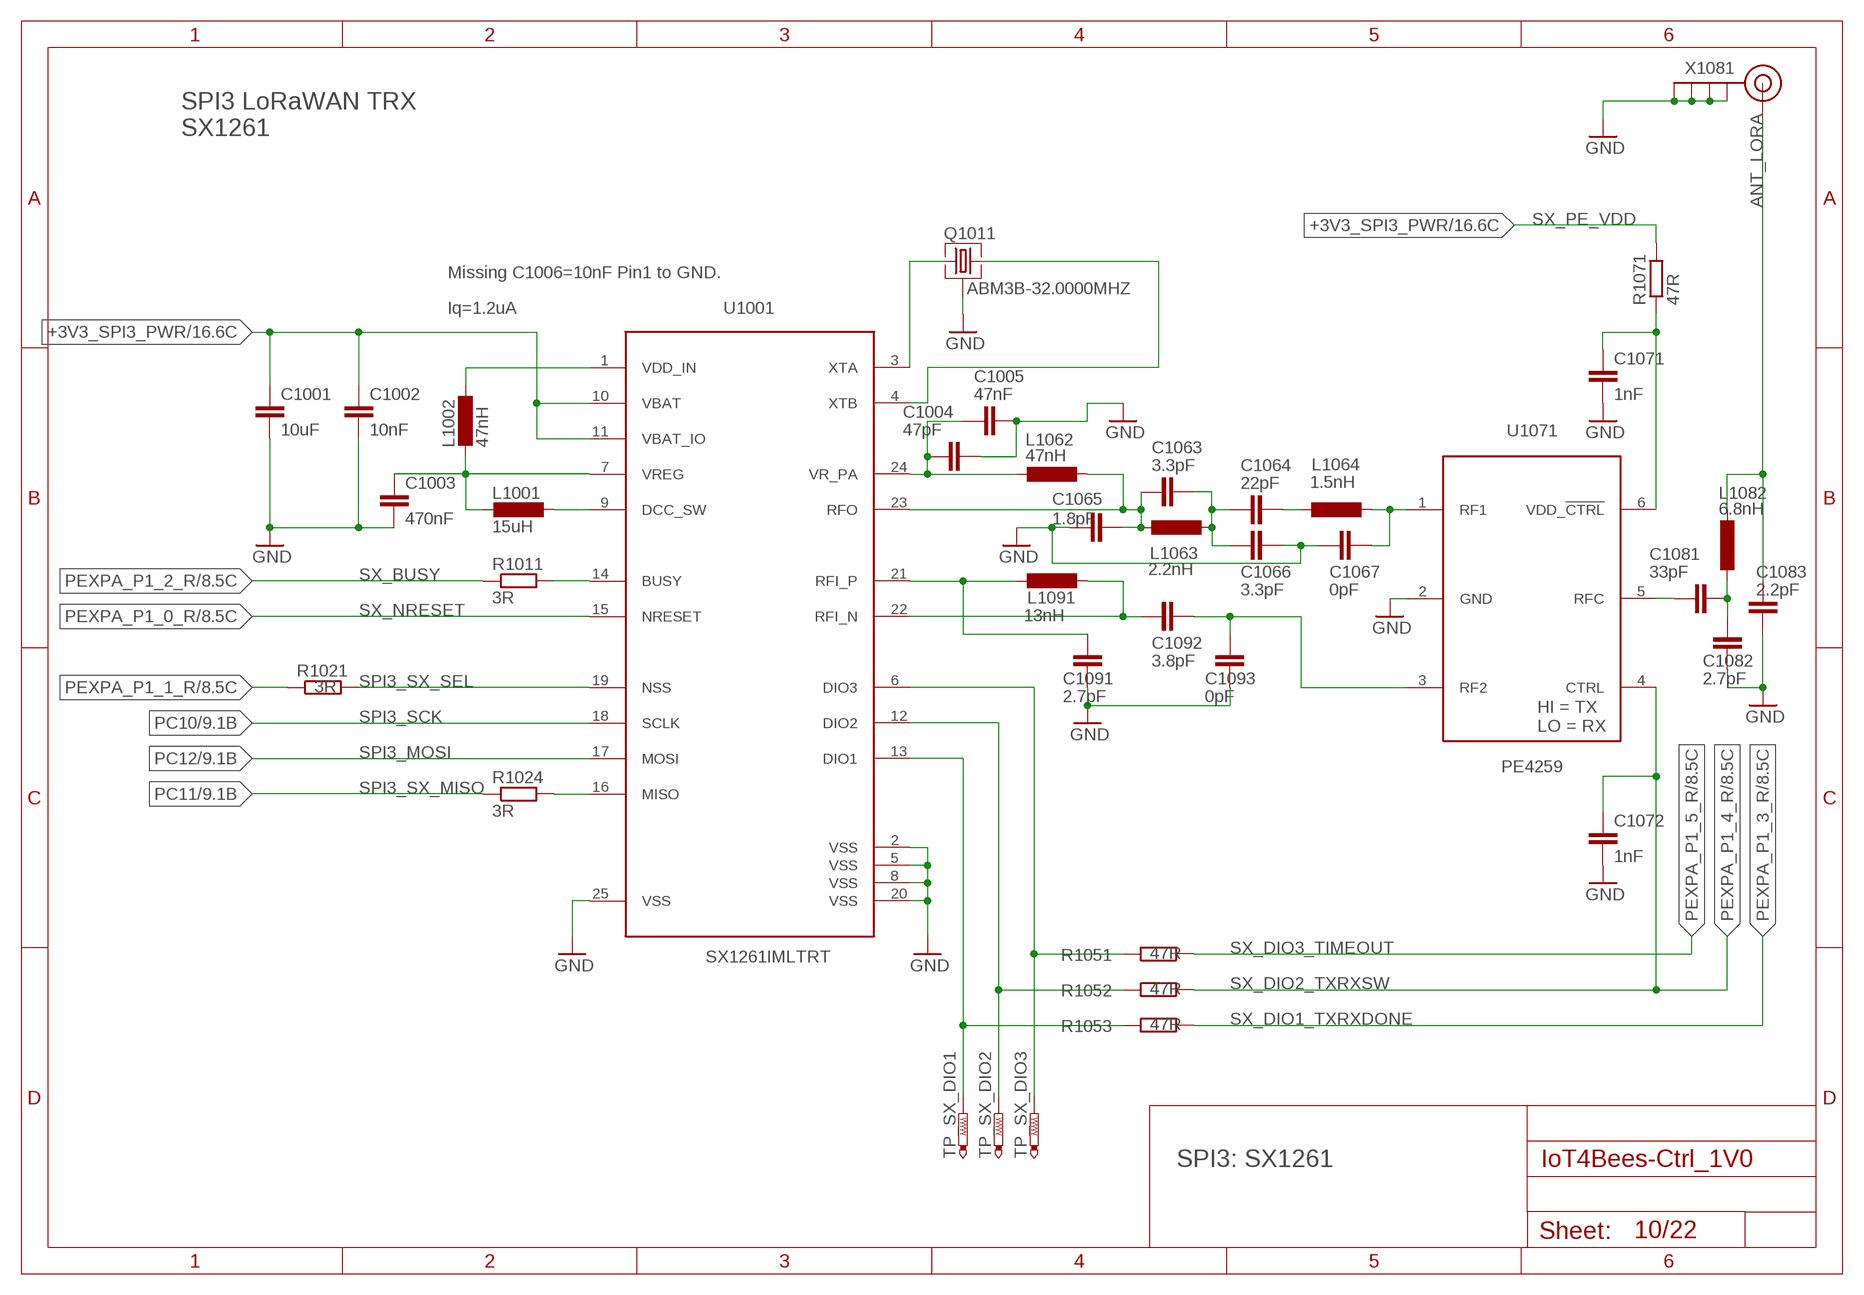
[diagram p9: schematic, sheet 10]

### Parts
C1001  10uF  C-EUC0603  [C0603]
C1002  10nF  C-EUC0402  [C0402]
C1003  470nF  C-EUC0402  [C0402]
C1004  47pF  C-EUC0402  [C0402]
C1005  47nF  C-EUC0402  [C0402]
C1063  3.3pF  C-EUC0402  [C0402]
C1064  22pF  C-EUC0402  [C0402]
C1065  1.8pF  C-EUC0402  [C0402]
C1066  3.3pF  C-EUC0402  [C0402]
C1067  0pF  C-EUC0402  [C0402]
C1071  1nF  C-EUC0402  [C0402]
C1072  1nF  C-EUC0402  [C0402]
C1081  33pF  C-EUC0402  [C0402]
C1082  2.7pF  C-EUC0402  [C0402]
C1083  2.2pF  C-EUC0402  [C0402]
C1091  2.7pF  C-EUC0402  [C0402]
C1092  3.8pF  C-EUC0402  [C0402]
C1093  0pF  C-EUC0402  [C0402]
L1001  15uH  L-EUL0805  [L0805]
L1002  47nH  L-EUL0603  [L0603]
L1062  47nH  L-EUL0603  [L0603]
L1063  2.2nH  L-EUL0603  [L0603]
L1064  1.5nH  L-EUL0603  [L0603]
L1082  6.8nH  L-EUL0603  [L0603]
L1091  13nH  L-EUL0603  [L0603]
Q1011  ABM3B-32.0000MHZ  [ABM3B]
R1011  3R  R-EU_R0402  [R0402]
R1021  3R  R-EU_R0402  [R0402]
R1024  3R  R-EU_R0402  [R0402]
R1051  47R  R-EU_R0402  [R0402]
R1052  47R  R-EU_R0402  [R0402]
R1053  47R  R-EU_R0402  [R0402]
R1071  47R  R-EU_R0402  [R0402]
TP_SX_DIO1  PTR1TP06R  [TP06R]
TP_SX_DIO2  PTR1TP06R  [TP06R]
TP_SX_DIO3  PTR1TP06R  [TP06R]
U1001  SX1261IMLTRT  SX1261  [QFN24-4X4-0P5-PAD]
U1071  PE4259  [SC-70_6-LEAD_2X1MM25_0P65]
X1081  ANTENNATINY  [SMA_UFL_PAD_TINY]

### Nets
+3V3_SPI3_PWR: C1001.1 C1002.1 R1071.2 U1001.10(VBAT) U1001.11(VBAT_IO) ; also sheet 9,16,21
ANT_LORA: C1083.2 L1082.1 X1081.ANT1(SIGNAL) X1081.ANT2(SIGNAL) X1081.ANT3(SIGNAL)
GND: C1001.2 C1002.2 C1003.2 C1004.2 C1005.2 C1065.1 C1066.2 C1067.2 C1071.2 C1072.2 C1082.1 C1083.1 C1091.1 C1093.1 Q1011.2 Q1011.4 U1001.2(VSS) U1001.5(VSS) U1001.8(VSS) U1001.20(VSS) U1001.25(VSS) U1071.2(GND) X1081.GND1(GND) X1081.GND2(GND) X1081.GND3(GND) X1081.GND4(GND) ; also sheet 1,2,3,4,6,7,8,9,11,12,13,14,15,16,17,18,19,20,21,22
MCU_SX_SEL_OUT: R1021.2 U1001.19(NSS)
PC10: U1001.18(SCLK) ; also sheet 1,9
PC11: R1024.1 ; also sheet 1,9
PC12: U1001.17(MOSI) ; also sheet 1,9
PE_!CTRL: C1071.1 R1071.1 U1071.6(VDD_!CTRL)
PE_RFC: C1081.1 U1071.5(RFC)
PE_RFC_2: C1081.2 C1082.2 L1082.2
PEXPA_P1_0_R: U1001.15(NRESET) ; also sheet 8
PEXPA_P1_1_R: R1021.1 ; also sheet 8
PEXPA_P1_2_R: R1011.1 ; also sheet 8
PEXPA_P1_3_R: R1053.2 ; also sheet 8
PEXPA_P1_4_R: C1072.1 R1052.2 U1071.4(CTRL) ; also sheet 8
PEXPA_P1_5_R: R1051.2 ; also sheet 8
SX_BUSY: R1011.2 U1001.14(BUSY)
SX_DCC_SW: L1001.1 U1001.9(DCC_SW)
SX_DIO1: R1053.1 TP_SX_DIO1.TP U1001.13(DIO1)
SX_DIO2: R1052.1 TP_SX_DIO2.TP U1001.12(DIO2)
SX_DIO3: R1051.1 TP_SX_DIO3.TP U1001.6(DIO3)
SX_MISO: R1024.2 U1001.16(MISO)
SX_RFI_2: C1092.2 C1093.2 U1071.3(RF2)
SX_RFI_N: C1092.1 L1091.1 U1001.22(RFI_N)
SX_RFI_P: C1091.2 L1091.2 U1001.21(RFI_P)
SX_RFO: C1063.1 C1065.2 L1062.1 L1063.2 U1001.23(RFO)
SX_RFO_3: C1063.2 C1064.1 C1066.1 L1063.1
SX_RFO_4: C1064.2 L1064.2
SX_RFO_5: C1067.1 L1064.1 U1071.1(RF1)
SX_VDD_IN: L1002.1 U1001.1(VDD_IN)
SX_VR_PA: C1004.1 C1005.1 L1062.2 U1001.24(VR_PA)
SX_VREG: C1003.1 L1001.2 L1002.2 U1001.7(VREG)
SX_XTA: Q1011.1 U1001.3(XTA)
SX_XTB: Q1011.3 U1001.4(XTB)

### Notes on the sheet
- X1081
- SPI3 LoRaWAN TRX
  SX1261
- SX_PE_VDD
- Missing C1006=10nF Pin1 to GND.
- Iq=1.2uA
- SX_BUSY
- SX_NRESET
- SPI3_SX_SEL
- SPI3_SCK
- HI = TX
  LO = RX
- SPI3_MOSI
- SPI3_SX_MISO
- SX_DIO3_TIMEOUT
- SX_DIO2_TXRXSW
- SX_DIO1_TXRXDONE
- SPI3: SX1261

## Sheet 11 of 22: I2C1 - PORT EXPANDER B: WLAN & SW
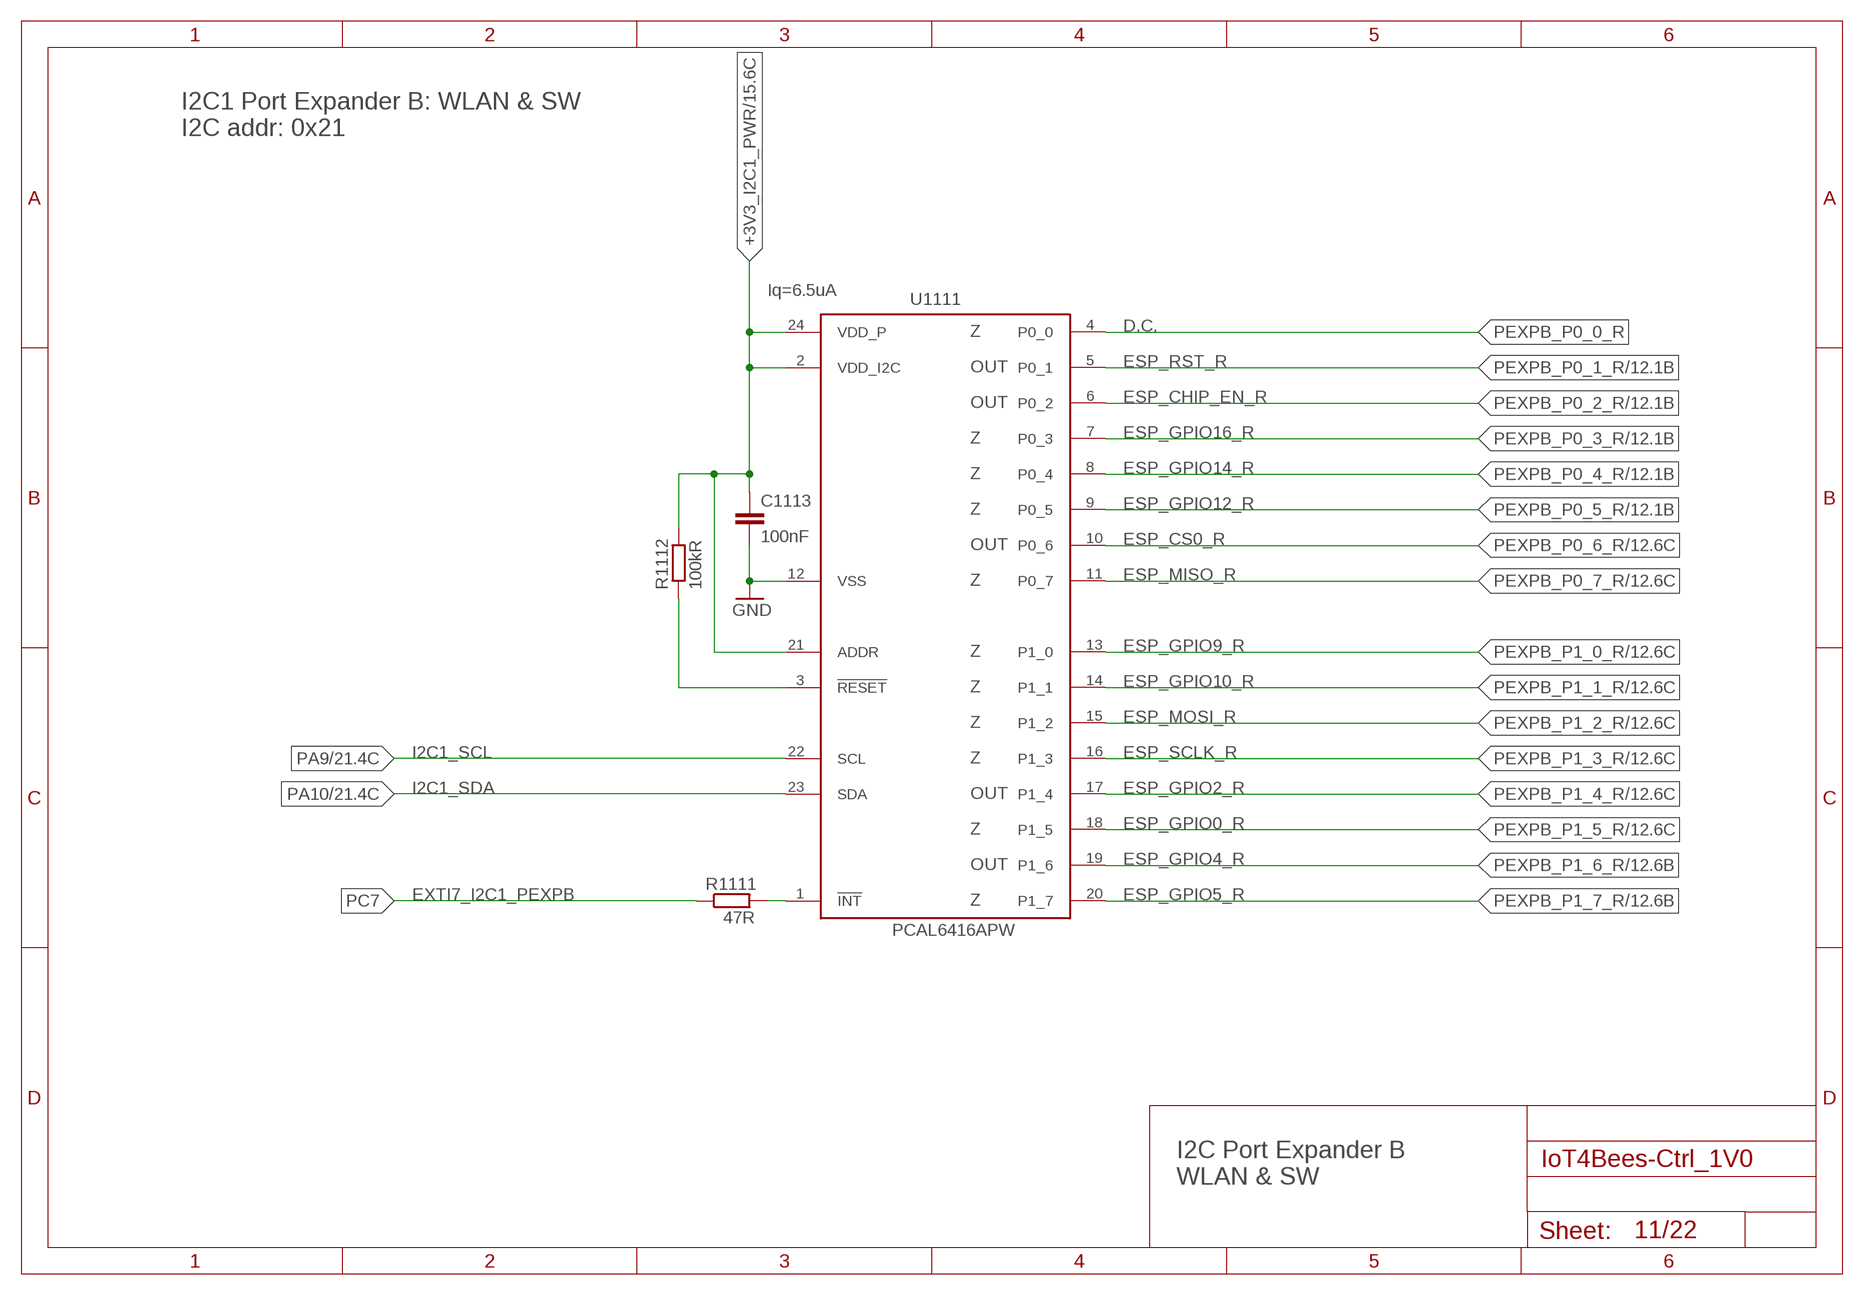
[diagram p10: schematic, sheet 11]

### Parts
C1113  100nF  C-EUC0402  [C0402]
R1111  47R  R-EU_R0402  [R0402]
R1112  100kR  R-EU_R0402  [R0402]
U1111  PCAL6416APW  [TSSOP24_SOT355-1]

### Nets
+3V3_I2C1_PWR: C1113.1 R1112.2 U1111.2(VDD_I2C) U1111.21(ADDR) U1111.24(VDD_P) ; also sheet 5,6,7,8,15,21
GND: C1113.2 U1111.12(VSS) ; also sheet 1,2,3,4,6,7,8,9,10,12,13,14,15,16,17,18,19,20,21,22
PA9: U1111.22(SCL) ; also sheet 1,5,6,7,8,21
PA10: U1111.23(SDA) ; also sheet 1,5,6,7,8,21
PC7: R1111.1 ; also sheet 1
PEXPB_INTN: R1111.2 U1111.1(!INT)
PEXPB_P0_0_R: U1111.4(P0_0)
PEXPB_P0_1_R: U1111.5(P0_1) ; also sheet 12
PEXPB_P0_2_R: U1111.6(P0_2) ; also sheet 12
PEXPB_P0_3_R: U1111.7(P0_3) ; also sheet 12
PEXPB_P0_4_R: U1111.8(P0_4) ; also sheet 12
PEXPB_P0_5_R: U1111.9(P0_5) ; also sheet 12
PEXPB_P0_6_R: U1111.10(P0_6) ; also sheet 12
PEXPB_P0_7_R: U1111.11(P0_7) ; also sheet 12
PEXPB_P1_0_R: U1111.13(P1_0) ; also sheet 12
PEXPB_P1_1_R: U1111.14(P1_1) ; also sheet 12
PEXPB_P1_2_R: U1111.15(P1_2) ; also sheet 12
PEXPB_P1_3_R: U1111.16(P1_3) ; also sheet 12
PEXPB_P1_4_R: U1111.17(P1_4) ; also sheet 12
PEXPB_P1_5_R: U1111.18(P1_5) ; also sheet 12
PEXPB_P1_6_R: U1111.19(P1_6) ; also sheet 12
PEXPB_P1_7_R: U1111.20(P1_7) ; also sheet 12
PEXPB_RESET: R1112.1 U1111.3(!RESET)

### Notes on the sheet
- I2C1 Port Expander B: WLAN & SW
  I2C addr: 0x21
- Iq=6.5uA
- D.C.
- Z
- ESP_RST_R
- OUT
- ESP_CHIP_EN_R
- OUT
- ESP_GPIO16_R
- Z
- ESP_GPIO14_R
- Z
- ESP_GPIO12_R
- Z
- ESP_CS0_R
- OUT
- ESP_MISO_R
- Z
- ESP_GPIO9_R
- Z
- ESP_GPIO10_R
- Z
- ESP_MOSI_R
- Z
- I2C1_SCL | ESP_SCLK_R
- Z
- I2C1_SDA | ESP_GPIO2_R
- OUT
- ESP_GPIO0_R
- Z
- ESP_GPIO4_R
- OUT
- EXTI7_I2C1_PEXPB | ESP_GPIO5_R
- Z
- I2C Port Expander B
  WLAN & SW

## Sheet 12 of 22: SPI3 - WLAN / BLE
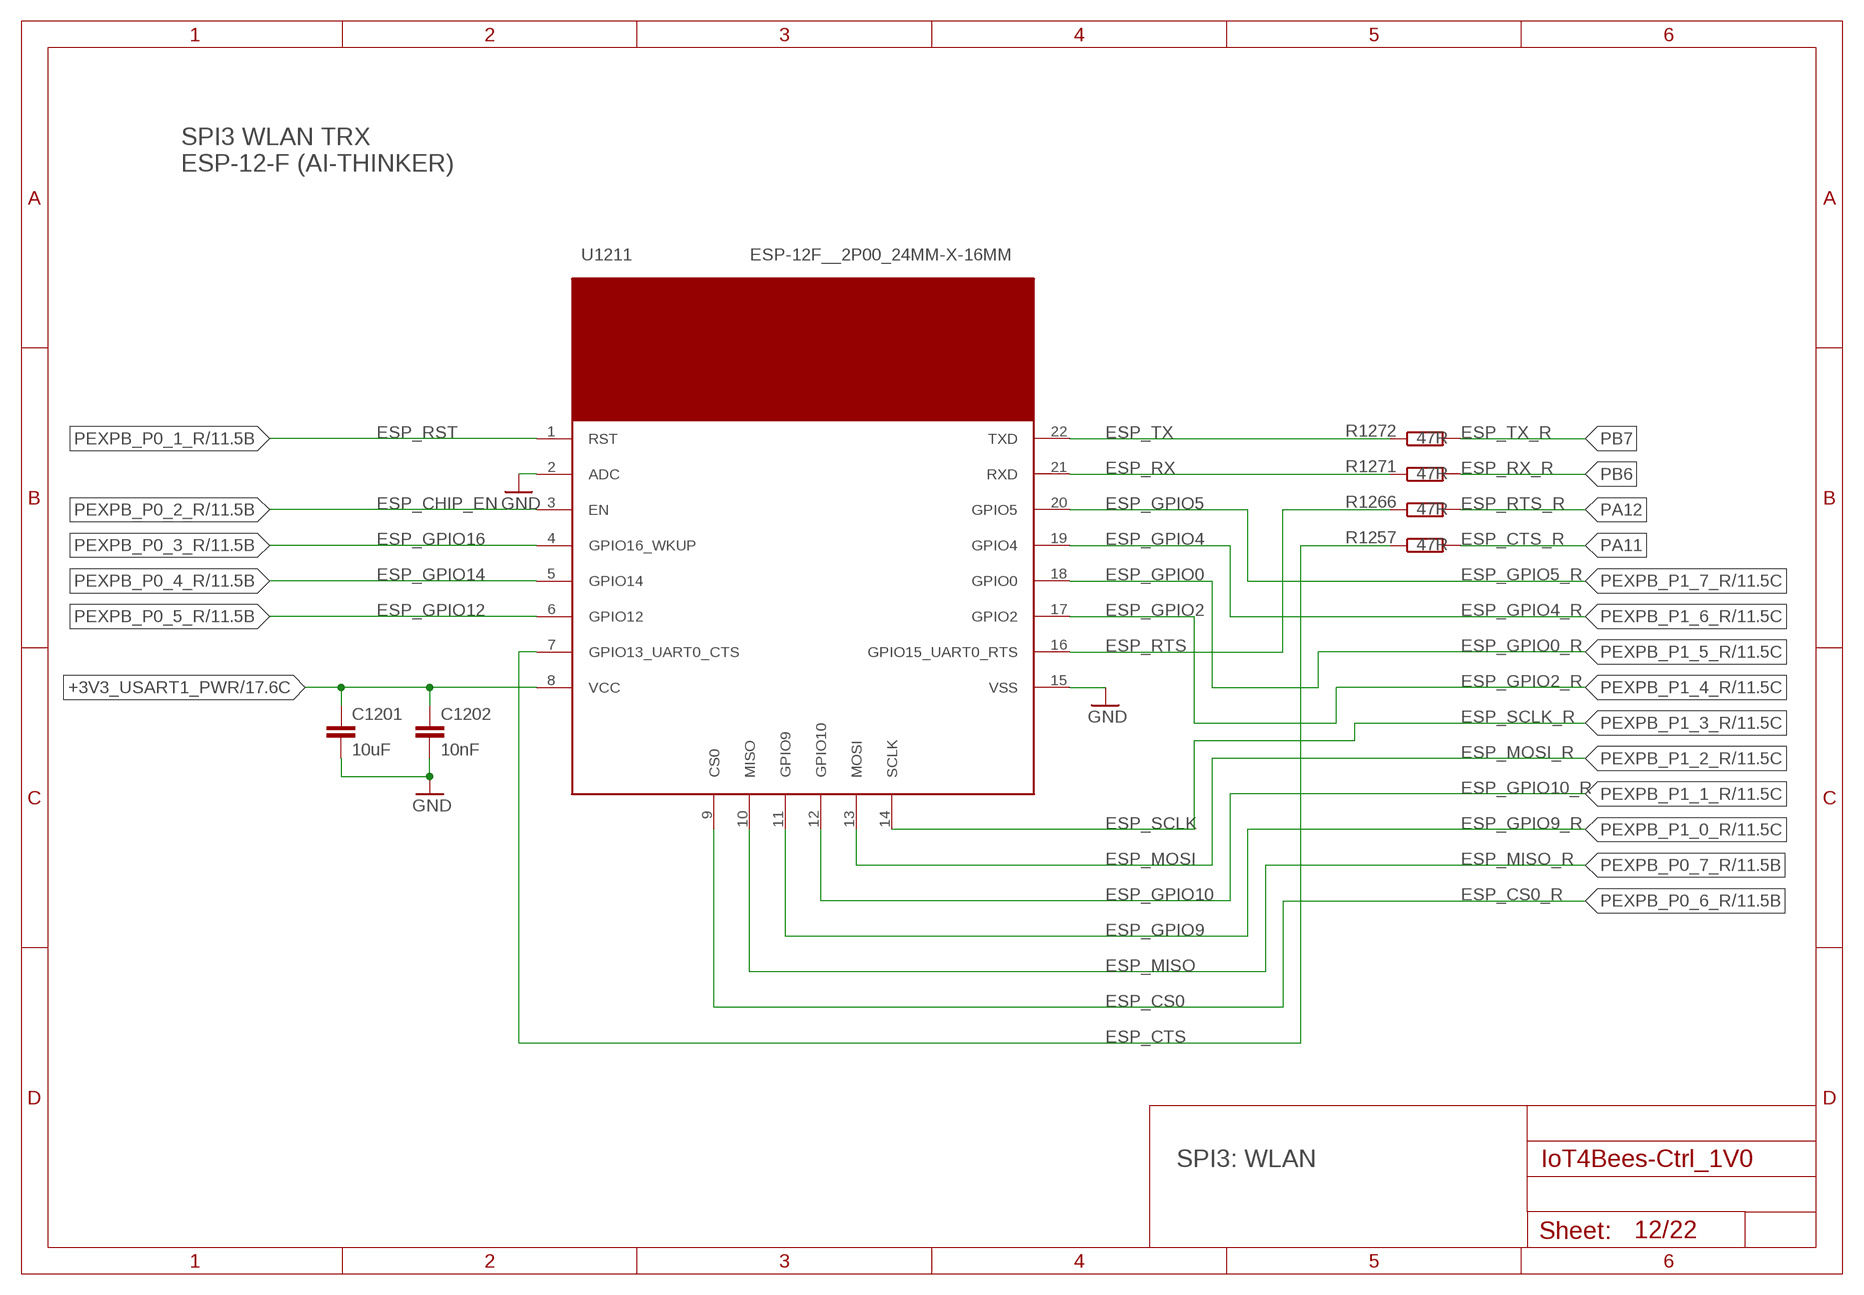
[diagram p11: schematic, sheet 12]

### Parts
C1201  10uF  C-EUC0603  [C0603]
C1202  10nF  C-EUC0402  [C0402]
R1257  47R  R-EU_R0402  [R0402]
R1266  47R  R-EU_R0402  [R0402]
R1271  47R  R-EU_R0402  [R0402]
R1272  47R  R-EU_R0402  [R0402]
U1211  ESP-12F__2P00_24MM-X-16MM  [ESP-12F__2P00_24MM-X-16MM]

### Nets
+3V3_USART1_PWR: C1201.1 C1202.1 U1211.8(VCC) ; also sheet 17
ESP_CTS: R1257.1 U1211.7(GPIO13_UART0_CTS)
ESP_RTS: R1266.1 U1211.16(GPIO15_UART0_RTS)
ESP_RX: R1271.1 U1211.21(RXD)
ESP_TX: R1272.1 U1211.22(TXD)
GND: C1201.2 C1202.2 U1211.2(ADC) U1211.15(VSS) ; also sheet 1,2,3,4,6,7,8,9,10,11,13,14,15,16,17,18,19,20,21,22
PA11: R1257.2 ; also sheet 1
PA12: R1266.2 ; also sheet 1
PB6: R1271.2 ; also sheet 1
PB7: R1272.2 ; also sheet 1
PEXPB_P0_1_R: U1211.1(RST) ; also sheet 11
PEXPB_P0_2_R: U1211.3(EN) ; also sheet 11
PEXPB_P0_3_R: U1211.4(GPIO16_WKUP) ; also sheet 11
PEXPB_P0_4_R: U1211.5(GPIO14) ; also sheet 11
PEXPB_P0_5_R: U1211.6(GPIO12) ; also sheet 11
PEXPB_P0_6_R: U1211.9(CS0) ; also sheet 11
PEXPB_P0_7_R: U1211.10(MISO) ; also sheet 11
PEXPB_P1_0_R: U1211.11(GPIO9) ; also sheet 11
PEXPB_P1_1_R: U1211.12(GPIO10) ; also sheet 11
PEXPB_P1_2_R: U1211.13(MOSI) ; also sheet 11
PEXPB_P1_3_R: U1211.14(SCLK) ; also sheet 11
PEXPB_P1_4_R: U1211.17(GPIO2) ; also sheet 11
PEXPB_P1_5_R: U1211.18(GPIO0) ; also sheet 11
PEXPB_P1_6_R: U1211.19(GPIO4) ; also sheet 11
PEXPB_P1_7_R: U1211.20(GPIO5) ; also sheet 11

### Notes on the sheet
- SPI3 WLAN TRX
  ESP-12-F (AI-THINKER)
- ESP_RST | ESP_TX_R
- ESP_RX_R
- ESP_CHIP_EN | ESP_GPIO5 | ESP_RTS_R
- ESP_GPIO16 | ESP_GPIO4 | ESP_CTS_R
- ESP_GPIO14 | ESP_GPIO0 | ESP_GPIO5_R
- ESP_GPIO12 | ESP_GPIO2 | ESP_GPIO4_R
- ESP_GPIO0_R
- ESP_GPIO2_R
- ESP_SCLK_R
- ESP_MOSI_R
- ESP_GPIO10_R
- ESP_SCLK | ESP_GPIO9_R
- ESP_MOSI | ESP_MISO_R
- ESP_GPIO10 | ESP_CS0_R
- ESP_GPIO9
- ESP_MISO
- ESP_CS0
- SPI3: WLAN

## Sheet 13 of 22: PMIC 4V .. 6V5 --> 3V3
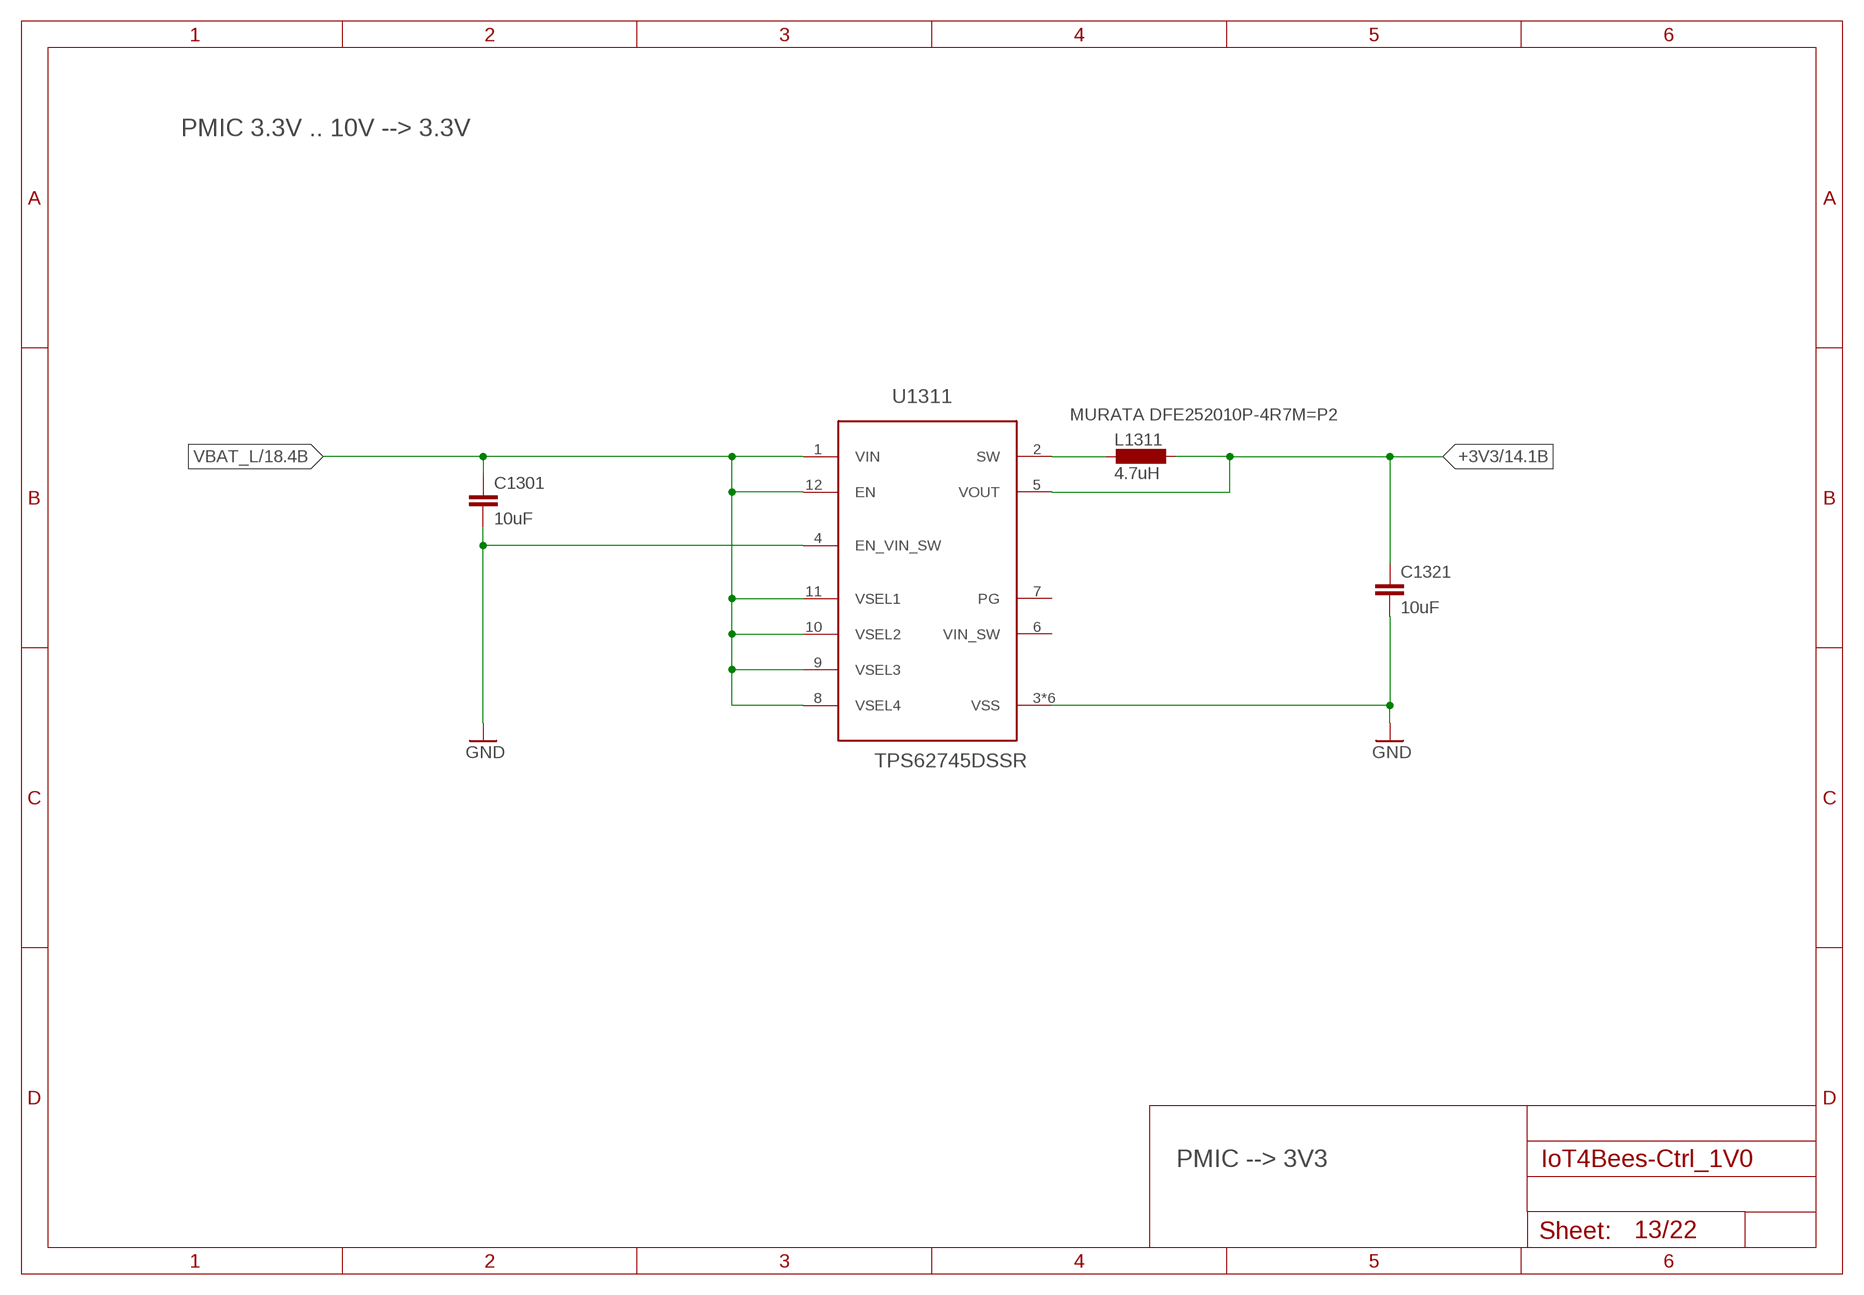
[diagram p12: schematic, sheet 13]

### Parts
C1301  10uF  C-EUC0603  [C0603]
C1321  10uF  C-EUC0603  [C0603]
L1311  4.7uH  L-EUL2520  [L2520]
U1311  TPS62745DSSR  TPS62745  [WSON-12]

### Nets
+3V3: C1321.1 L1311.1 U1311.5(VOUT) ; also sheet 2,4,14,15,16,17,18,20,21
GND: C1301.2 C1321.2 U1311.3(VSS) U1311.4(EN_VIN_SW) U1311.13(VSS) U1311.14(VSS) U1311.G1(VSS) U1311.G2(VSS) U1311.G3(VSS) ; also sheet 1,2,3,4,6,7,8,9,10,11,12,14,15,16,17,18,19,20,21,22
PMIC3V3_SW: L1311.2 U1311.2(SW)
VBAT_L: C1301.1 U1311.1(VIN) U1311.8(VSEL4) U1311.9(VSEL3) U1311.10(VSEL2) U1311.11(VSEL1) U1311.12(EN) ; also sheet 18,20,21
Unconnected: U1311.6(VIN_SW) U1311.7(PG)

### Notes on the sheet
- PMIC 3.3V .. 10V --> 3.3V
- MURATA DFE252010P-4R7M=P2
- PMIC --> 3V3

## Sheet 14 of 22: PMIC 3V3 --> 1V2
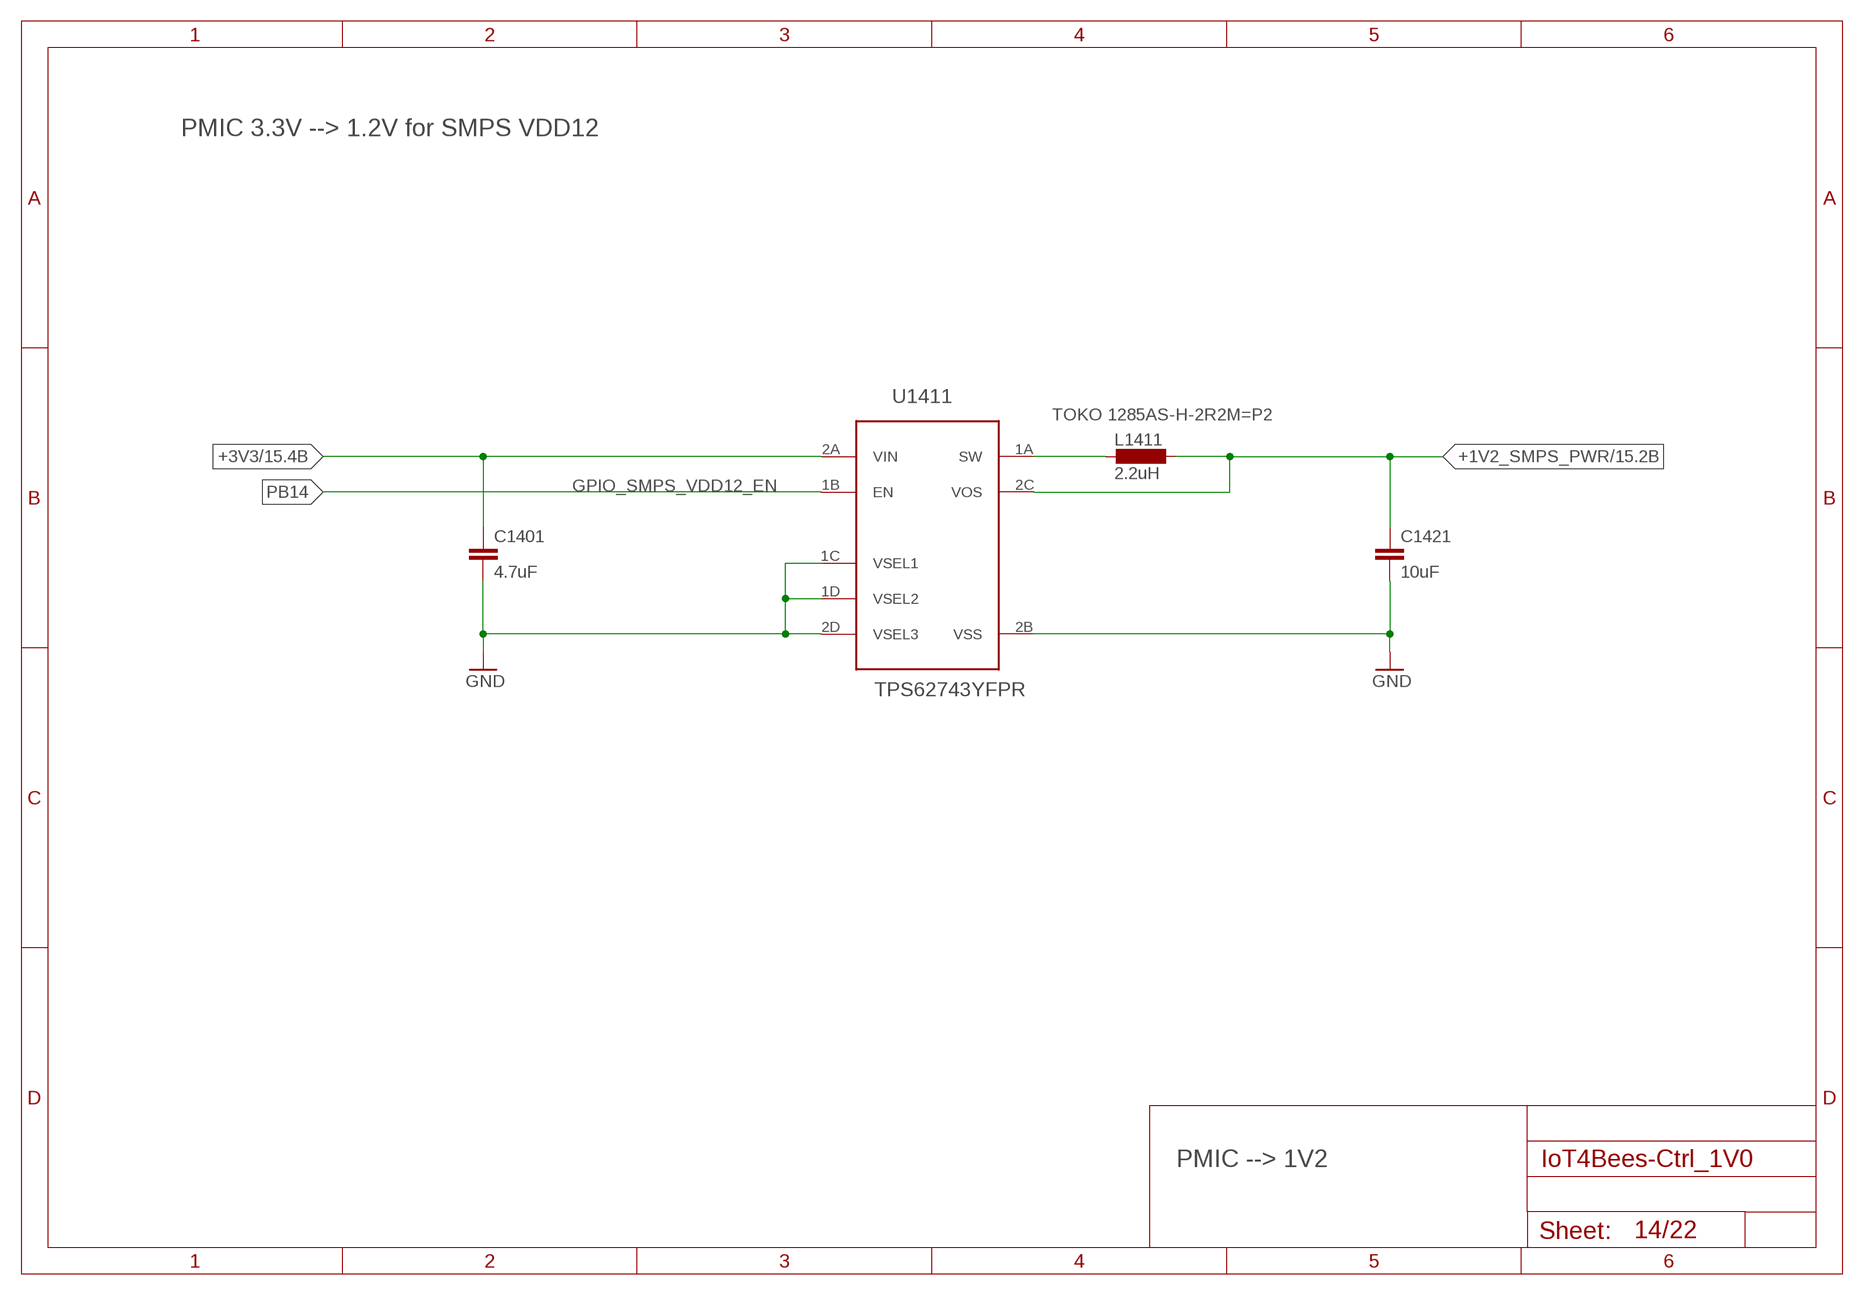
[diagram p13: schematic, sheet 14]

### Parts
C1401  4.7uF  C-EUC0603  [C0603]
C1421  10uF  C-EUC0603  [C0603]
L1411  2.2uH  L-EUL2016  [L2016]
U1411  TPS62743YFPR  TPS62743  [WCSP-8]

### Nets
+1V2_SMPS_PWR: C1421.1 L1411.1 U1411.2C(VOS) ; also sheet 15
+3V3: C1401.1 U1411.2A(VIN) ; also sheet 2,4,13,15,16,17,18,20,21
GND: C1401.2 C1421.2 U1411.1C(VSEL1) U1411.1D(VSEL2) U1411.2B(VSS) U1411.2D(VSEL3) ; also sheet 1,2,3,4,6,7,8,9,10,11,12,13,15,16,17,18,19,20,21,22
PB14: U1411.1B(EN) ; also sheet 1
PMIC1V2_SW: L1411.2 U1411.1A(SW)

### Notes on the sheet
- PMIC 3.3V --> 1.2V for SMPS VDD12
- TOKO 1285AS-H-2R2M=P2
- GPIO_SMPS_VDD12_EN
- PMIC --> 1V2

## Sheet 15 of 22: SW SMPS VDD12, I2C1 PWR
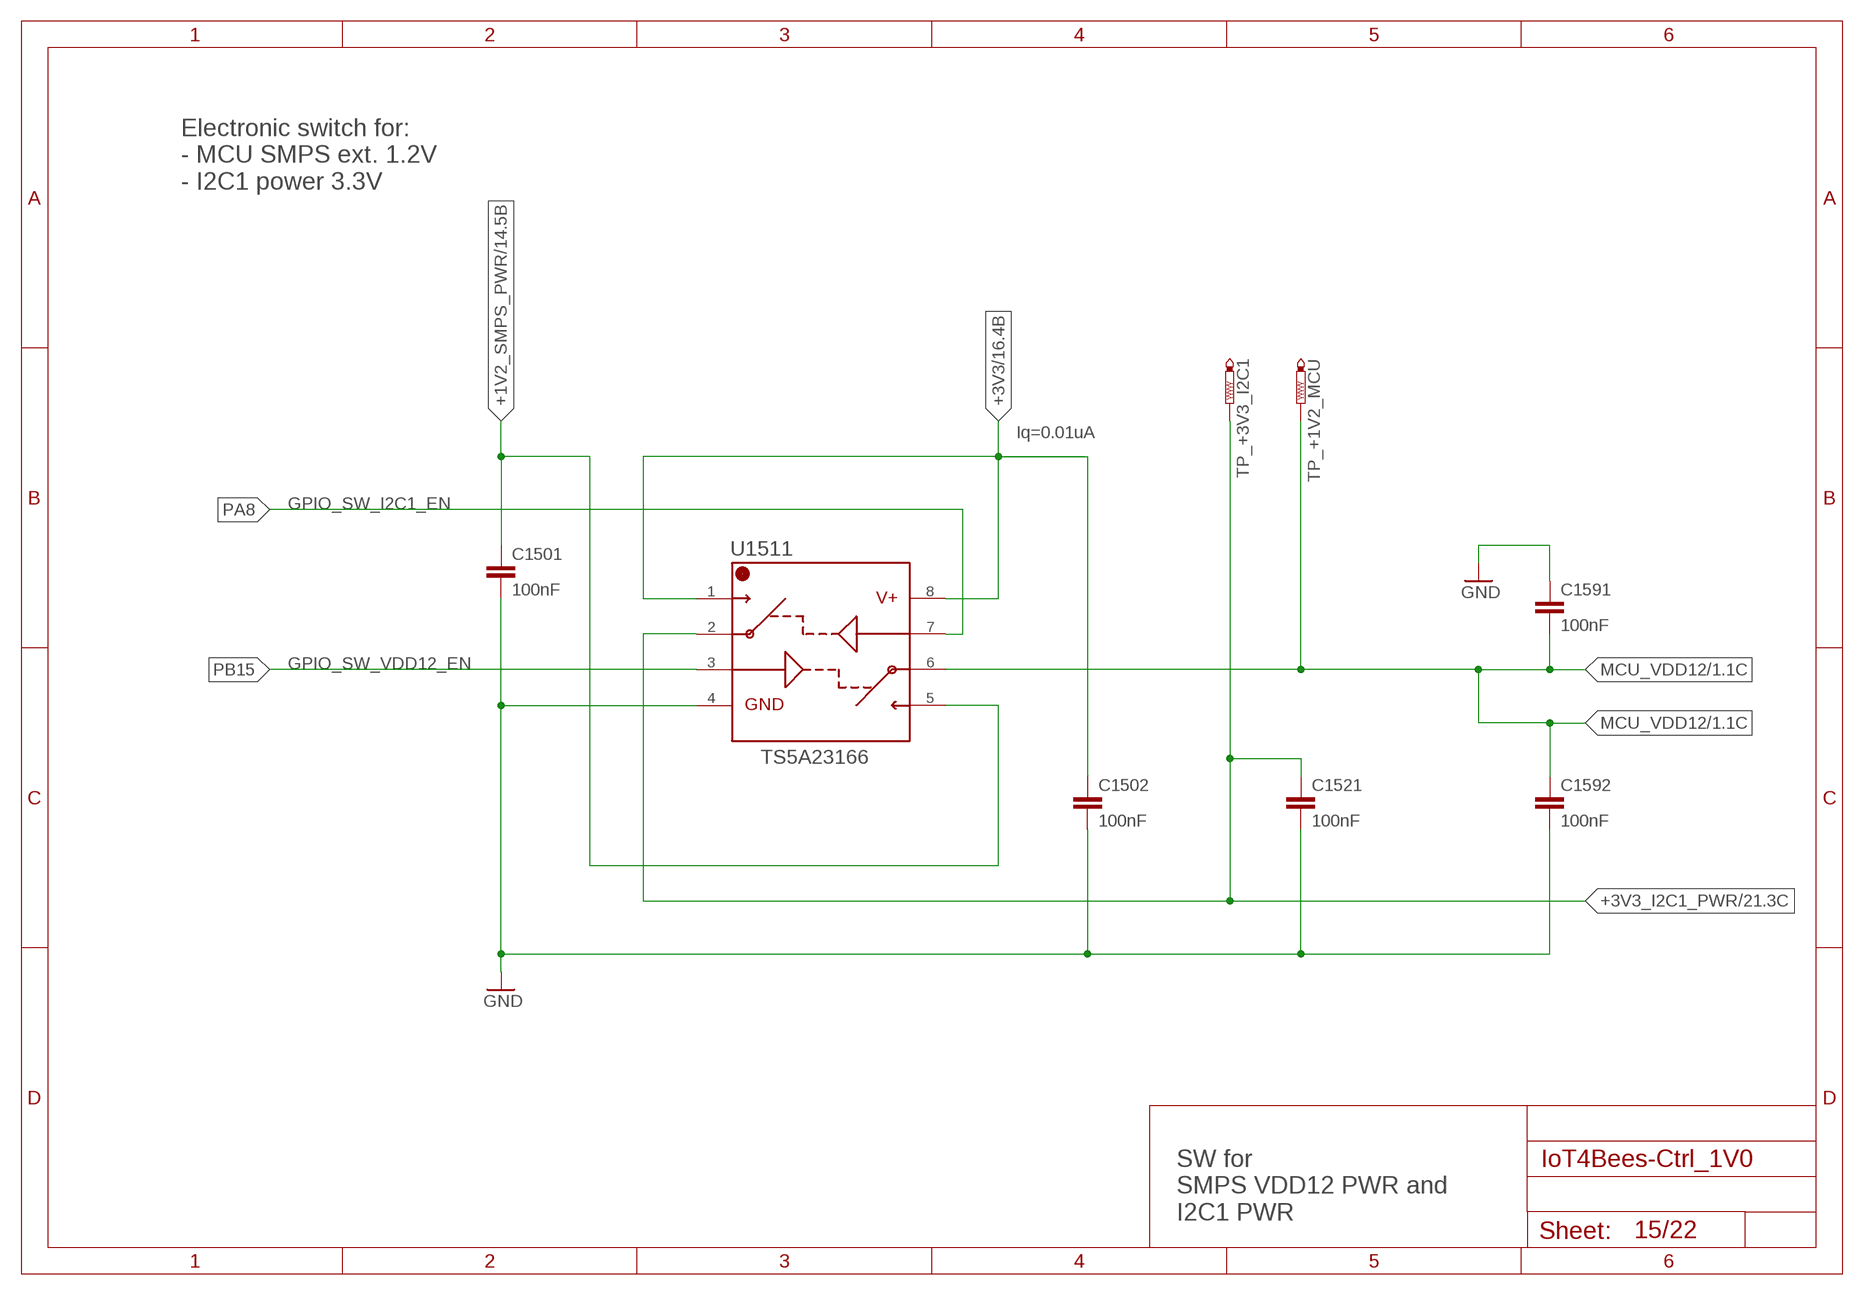
[diagram p14: schematic, sheet 15]

### Parts
C1501  100nF  C-EUC0402  [C0402]
C1502  100nF  C-EUC0402  [C0402]
C1521  100nF  C-EUC0402  [C0402]
C1591  100nF  C-EUC0402  [C0402]
C1592  100nF  C-EUC0402  [C0402]
TP_+1V2_MCU  PTR1TP06R  [TP06R]
TP_+3V3_I2C1  PTR1TP06R  [TP06R]
U1511  TS5A23166  [R-PDSO-G8]

### Nets
+1V2_SMPS_PWR: C1501.1 U1511.5 ; also sheet 14
+3V3: C1502.1 U1511.1 U1511.8 ; also sheet 2,4,13,14,16,17,18,20,21
+3V3_I2C1_PWR: C1521.1 TP_+3V3_I2C1.TP U1511.2 ; also sheet 5,6,7,8,11,21
GND: C1501.2 C1502.2 C1521.2 C1591.1 C1592.2 U1511.4 ; also sheet 1,2,3,4,6,7,8,9,10,11,12,13,14,16,17,18,19,20,21,22
MCU_VDD12: C1591.2 C1592.1 TP_+1V2_MCU.TP U1511.6 ; also sheet 1
PA8: U1511.7 ; also sheet 1
PB15: U1511.3 ; also sheet 1

### Notes on the sheet
- Electronic switch for:
  - MCU SMPS ext. 1.2V
  - I2C1 power 3.3V
- Iq=0.01uA
- GPIO_SW_I2C1_EN
- GPIO_SW_VDD12_EN
- SW for 
  SMPS VDD12 PWR and
  I2C1 PWR

## Sheet 16 of 22: SW SPI3 PWR
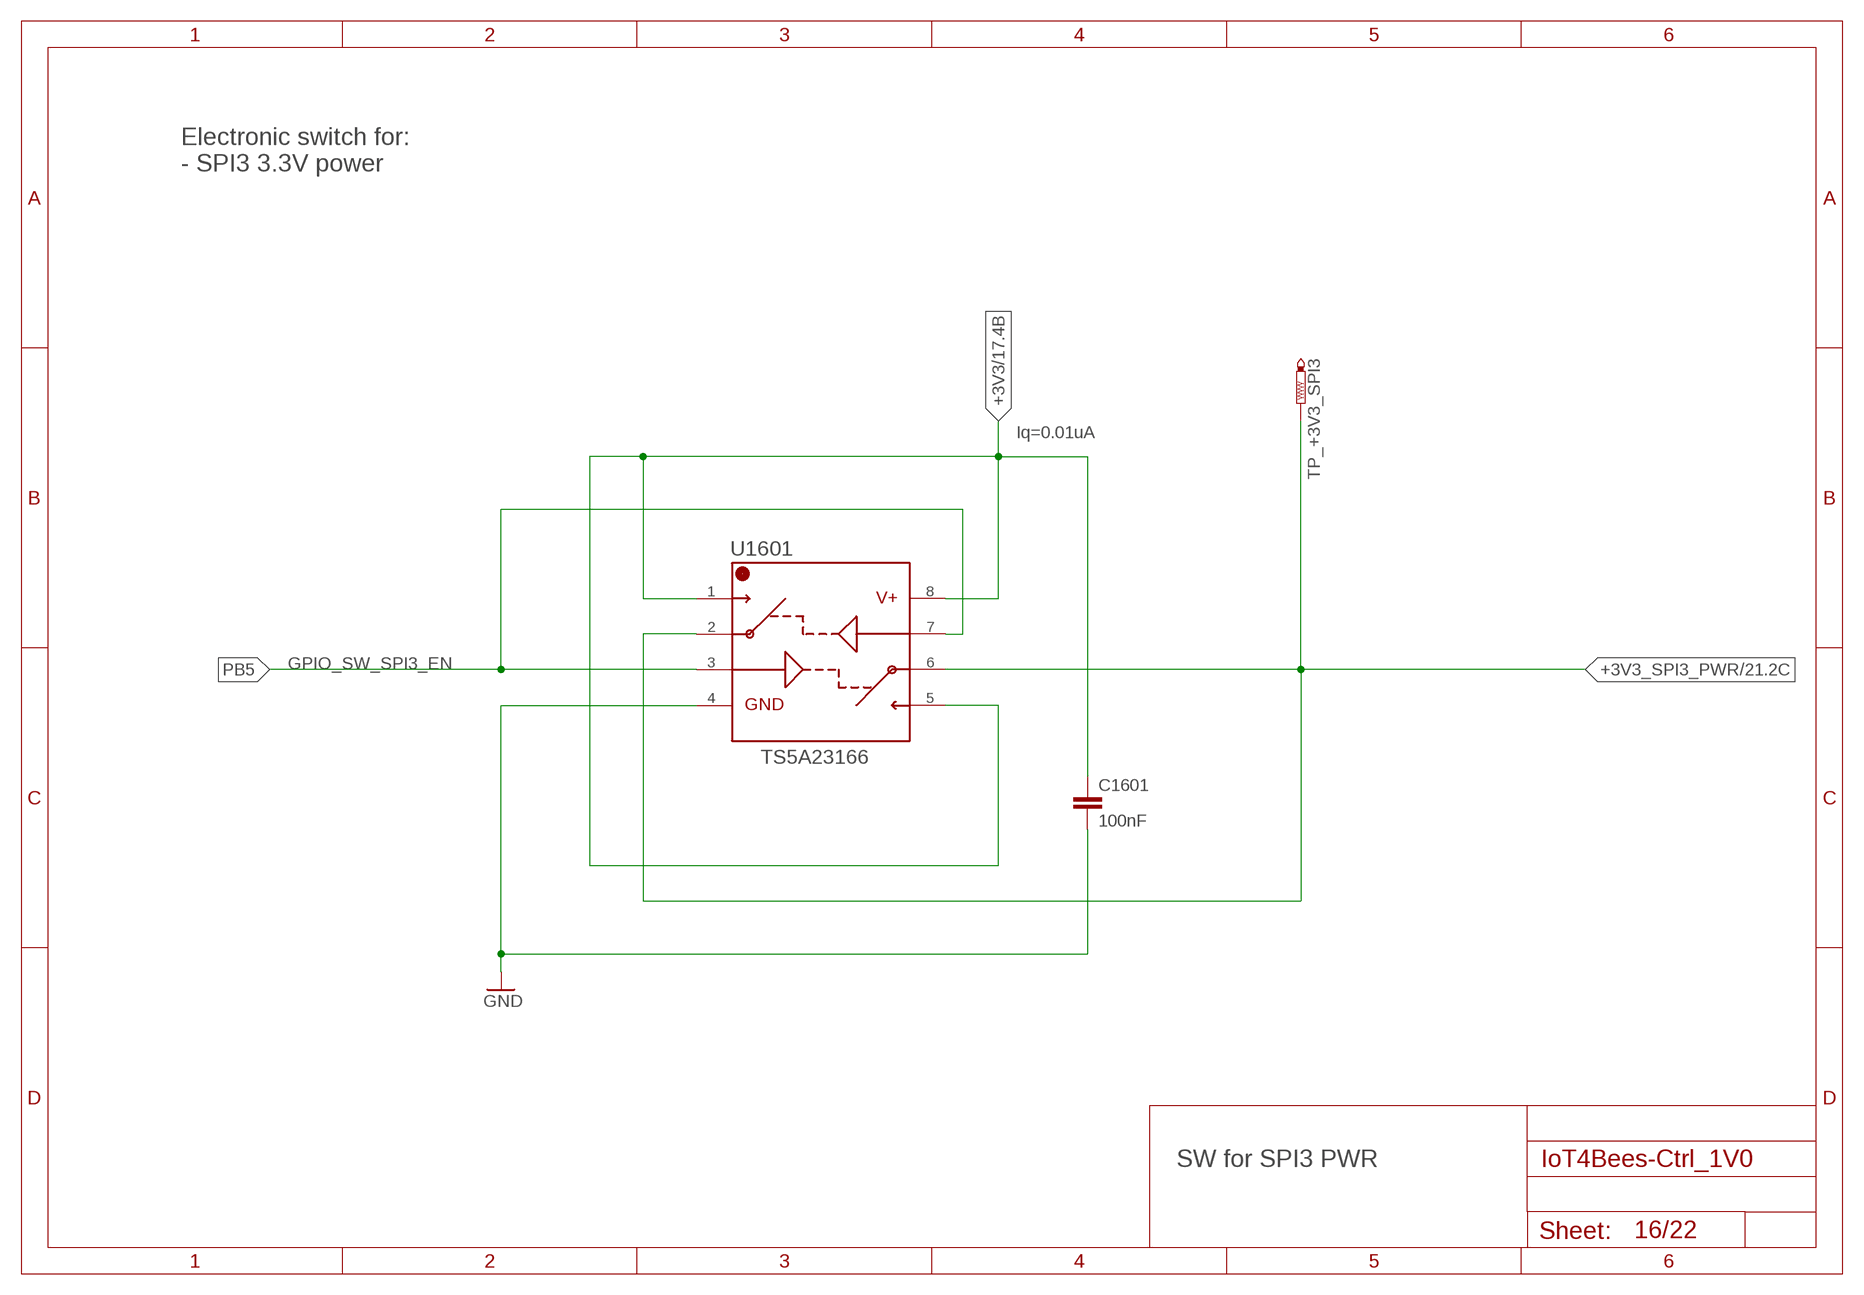
[diagram p15: schematic, sheet 16]

### Parts
C1601  100nF  C-EUC0402  [C0402]
TP_+3V3_SPI3  PTR1TP06R  [TP06R]
U1601  TS5A23166  [R-PDSO-G8]

### Nets
+3V3: C1601.1 U1601.1 U1601.5 U1601.8 ; also sheet 2,4,13,14,15,17,18,20,21
+3V3_SPI3_PWR: TP_+3V3_SPI3.TP U1601.2 U1601.6 ; also sheet 9,10,21
GND: C1601.2 U1601.4 ; also sheet 1,2,3,4,6,7,8,9,10,11,12,13,14,15,17,18,19,20,21,22
PB5: U1601.3 U1601.7 ; also sheet 1

### Notes on the sheet
- Electronic switch for:
  - SPI3 3.3V power
- Iq=0.01uA
- GPIO_SW_SPI3_EN
- SW for SPI3 PWR

## Sheet 17 of 22: SW USART1 PWR (WLAN)
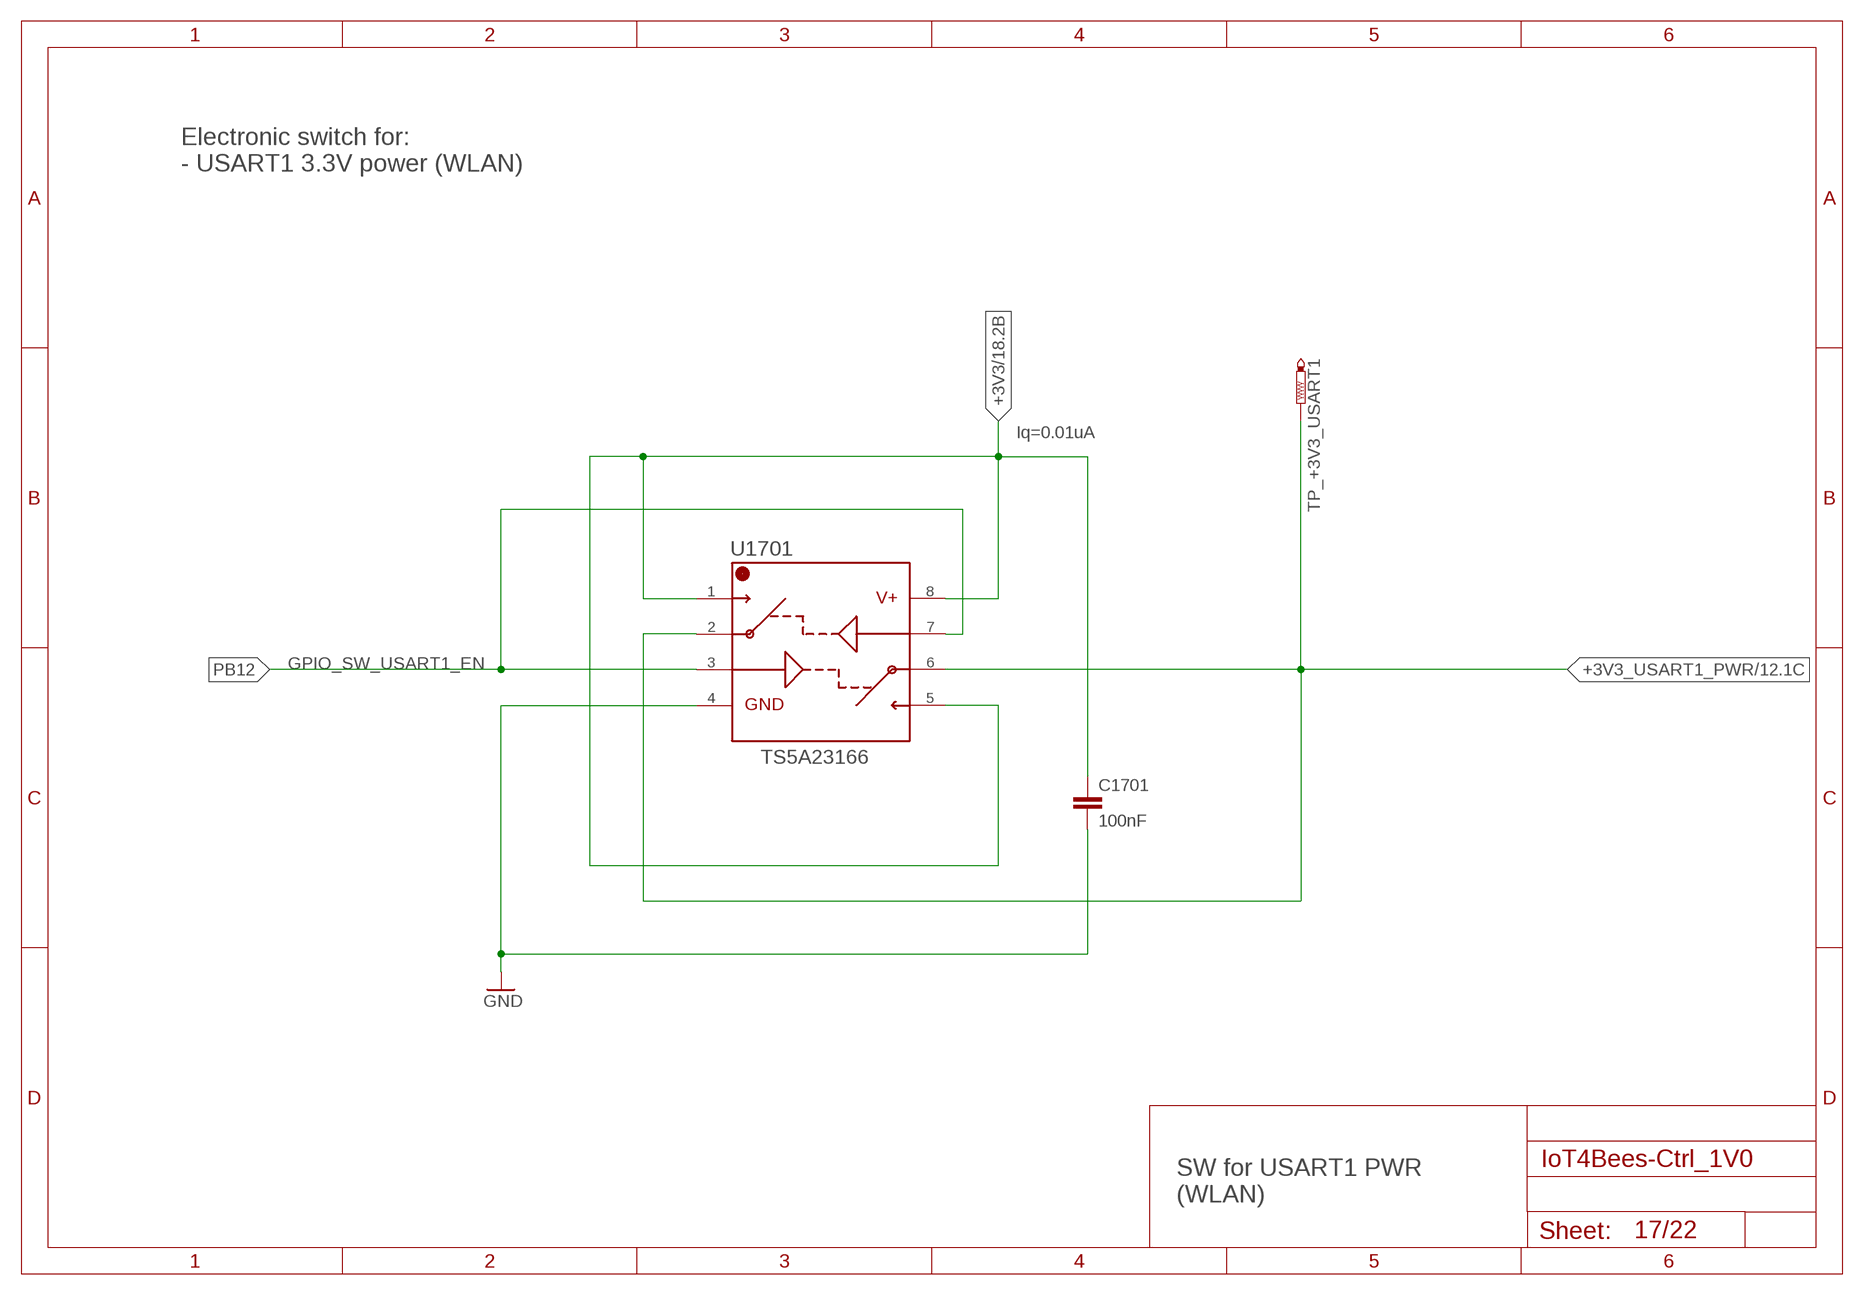
[diagram p16: schematic, sheet 17]

### Parts
C1701  100nF  C-EUC0402  [C0402]
TP_+3V3_USART1  PTR1TP06R  [TP06R]
U1701  TS5A23166  [R-PDSO-G8]

### Nets
+3V3: C1701.1 U1701.1 U1701.5 U1701.8 ; also sheet 2,4,13,14,15,16,18,20,21
+3V3_USART1_PWR: TP_+3V3_USART1.TP U1701.2 U1701.6 ; also sheet 12
GND: C1701.2 U1701.4 ; also sheet 1,2,3,4,6,7,8,9,10,11,12,13,14,15,16,18,19,20,21,22
PB12: U1701.3 U1701.7 ; also sheet 1

### Notes on the sheet
- Electronic switch for:
  - USART1 3.3V power (WLAN)
- Iq=0.01uA
- GPIO_SW_USART1_EN
- SW for USART1 PWR
  (WLAN)

## Sheet 18 of 22: SW BRIDGES, BAT_VOLTAGE
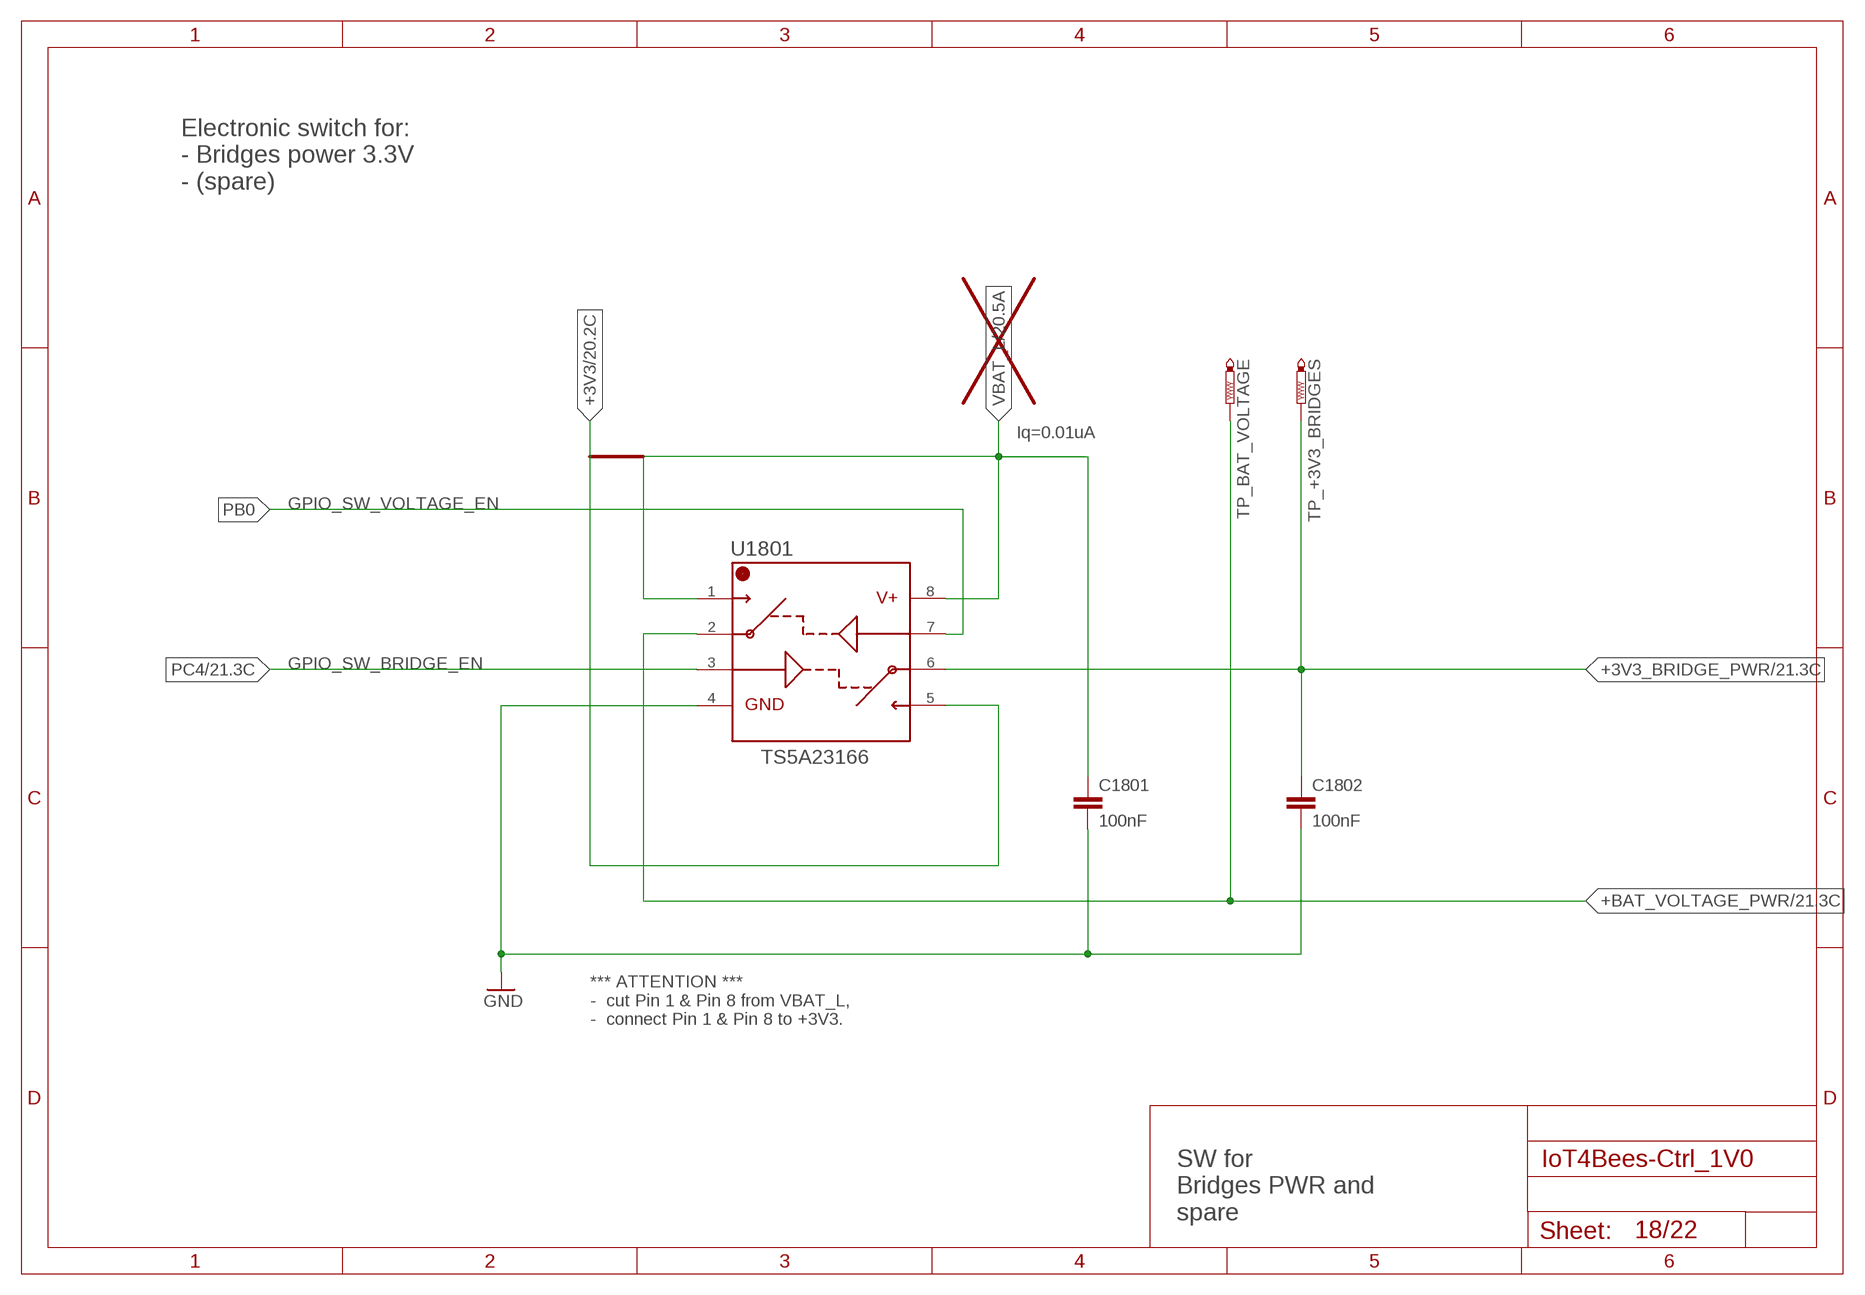
[diagram p17: schematic, sheet 18]

### Parts
C1801  100nF  C-EUC0402  [C0402]
C1802  100nF  C-EUC0402  [C0402]
TP_+3V3_BRIDGES  PTR1TP06R  [TP06R]
TP_BAT_VOLTAGE  PTR1TP06R  [TP06R]
U1801  TS5A23166  [R-PDSO-G8]  (not fitted in variant Max)  (not fitted in variant Std)

### Nets
+3V3: U1801.5 ; also sheet 2,4,13,14,15,16,17,20,21
+3V3_BRIDGE_PWR: C1802.1 TP_+3V3_BRIDGES.TP U1801.6 ; also sheet 19,21
+BAT_VOLTAGE_PWR: TP_BAT_VOLTAGE.TP U1801.2 ; also sheet 4,21
GND: C1801.2 C1802.2 U1801.4 ; also sheet 1,2,3,4,6,7,8,9,10,11,12,13,14,15,16,17,19,20,21,22
PB0: U1801.7 ; also sheet 1
PC4: U1801.3 ; also sheet 1,21
VBAT_L: C1801.1 U1801.1 U1801.8 ; also sheet 13,20,21

### Notes on the sheet
- Electronic switch for:
  - Bridges power 3.3V
  - (spare)
- Iq=0.01uA
- GPIO_SW_VOLTAGE_EN
- GPIO_SW_BRIDGE_EN
- *** ATTENTION ***
  -  cut Pin 1 & Pin 8 from VBAT_L,
  -  connect Pin 1 & Pin 8 to +3V3.
- SW for 
  Bridges PWR and
  spare

## Sheet 19 of 22: ADC MUXER
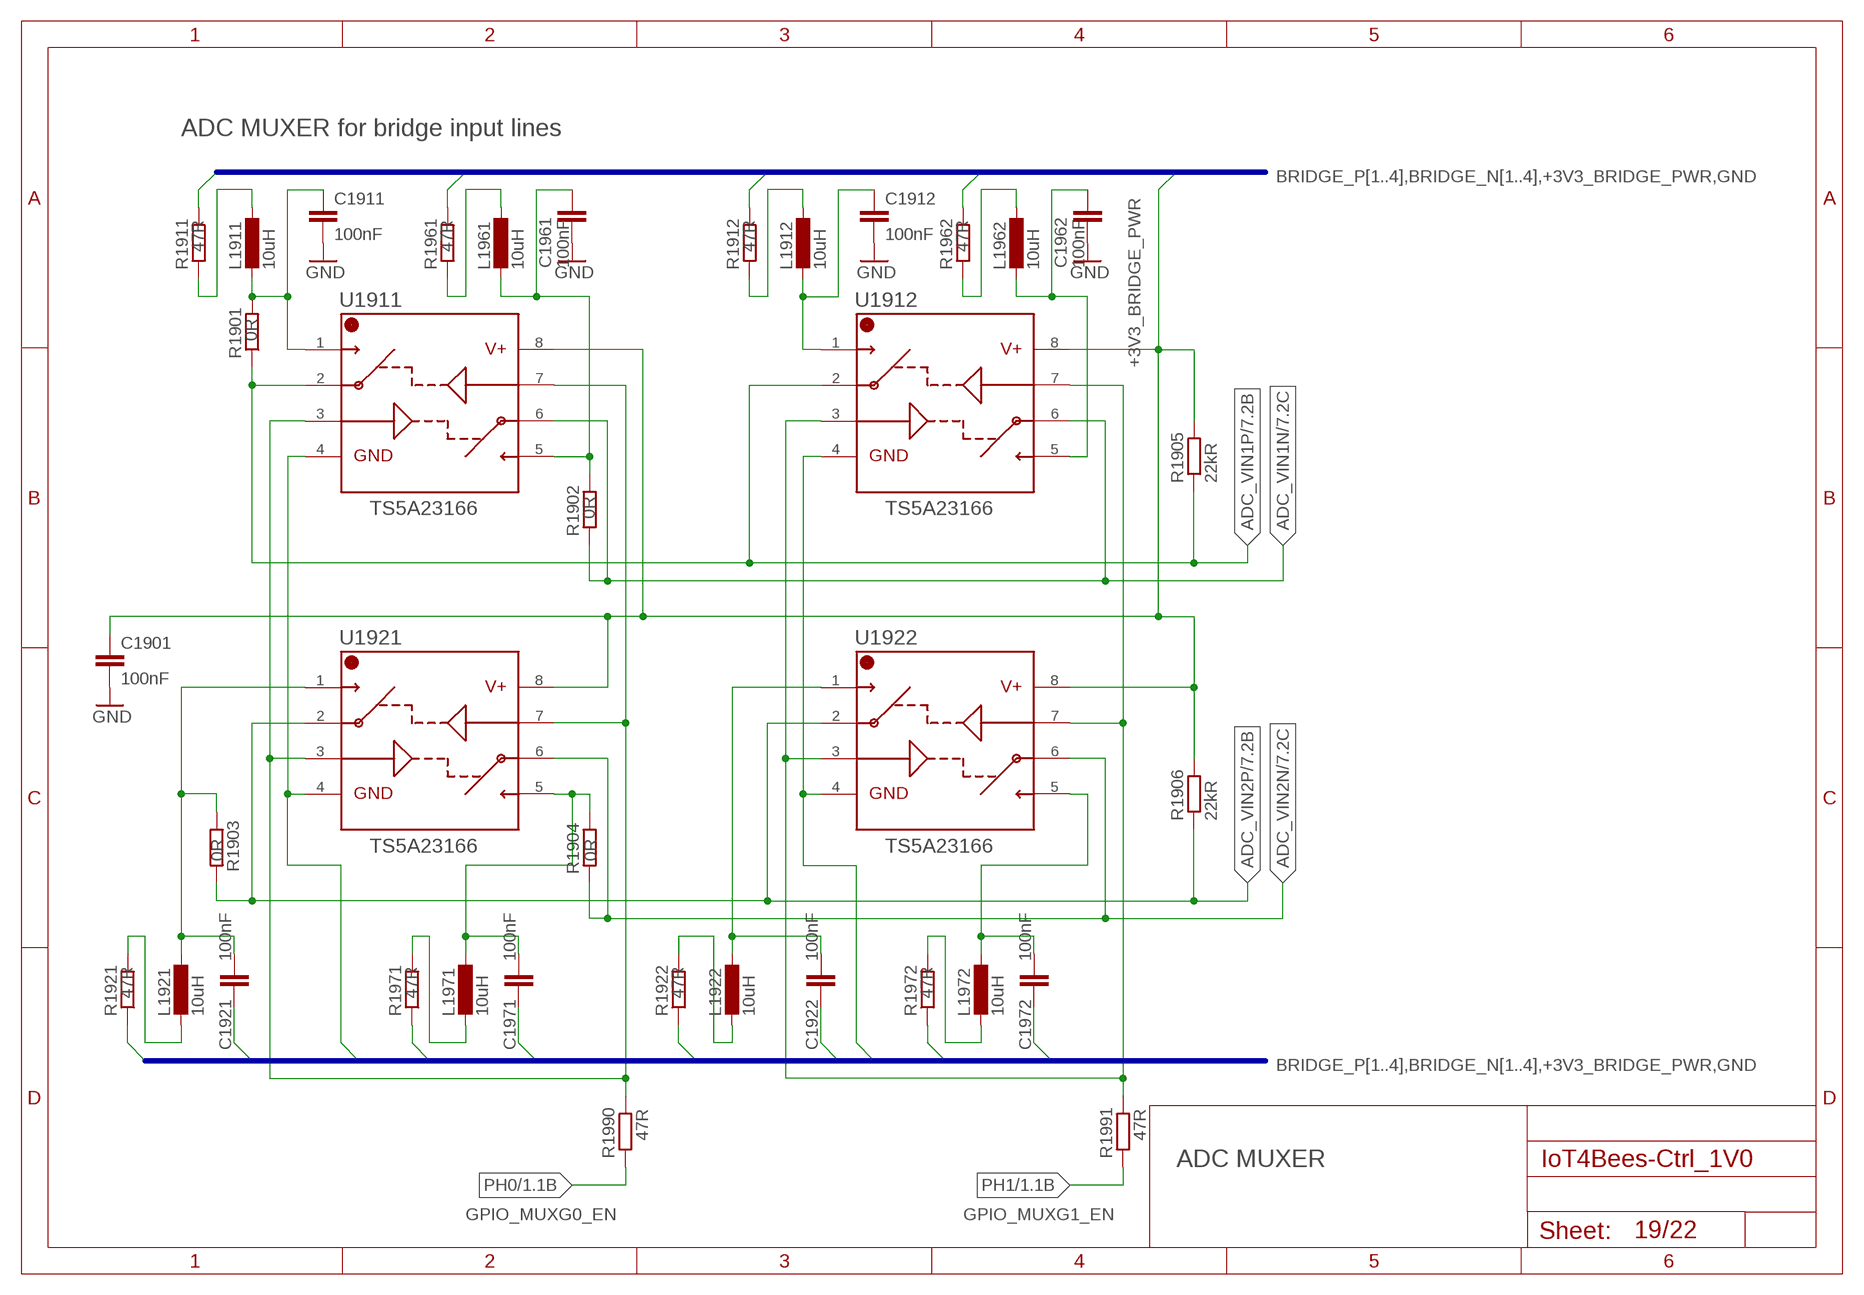
[diagram p18: schematic, sheet 19]

### Parts
C1901  100nF  C-EUC0402  [C0402]  (not fitted in variant Std)
C1911  100nF  C-EUC0402  [C0402]
C1912  100nF  C-EUC0402  [C0402]
C1921  100nF  C-EUC0402  [C0402]
C1922  100nF  C-EUC0402  [C0402]
C1961  100nF  C-EUC0402  [C0402]
C1962  100nF  C-EUC0402  [C0402]
C1971  100nF  C-EUC0402  [C0402]
C1972  100nF  C-EUC0402  [C0402]
L1911  10uH  L-EUL0603  [L0603]
L1912  10uH  L-EUL0603  [L0603]
L1921  10uH  L-EUL0603  [L0603]
L1922  10uH  L-EUL0603  [L0603]
L1961  10uH  L-EUL0603  [L0603]
L1962  10uH  L-EUL0603  [L0603]
L1971  10uH  L-EUL0603  [L0603]
L1972  10uH  L-EUL0603  [L0603]
R1901  0R  R-EU_R0402  [R0402]  (not fitted in variant Max)
R1902  0R  R-EU_R0402  [R0402]  (not fitted in variant Max)
R1903  0R  R-EU_R0402  [R0402]  (not fitted in variant Max)
R1904  0R  R-EU_R0402  [R0402]  (not fitted in variant Max)
R1905  22kR  R-EU_R0402  [R0402]  (not fitted in variant Std)
R1906  22kR  R-EU_R0402  [R0402]  (not fitted in variant Std)
R1911  47R  R-EU_R0402  [R0402]
R1912  47R  R-EU_R0402  [R0402]
R1921  47R  R-EU_R0402  [R0402]
R1922  47R  R-EU_R0402  [R0402]
R1961  47R  R-EU_R0402  [R0402]
R1962  47R  R-EU_R0402  [R0402]
R1971  47R  R-EU_R0402  [R0402]
R1972  47R  R-EU_R0402  [R0402]
R1990  47R  R-EU_R0402  [R0402]  (not fitted in variant Std)
R1991  47R  R-EU_R0402  [R0402]  (not fitted in variant Std)
U1911  TS5A23166  [R-PDSO-G8]  (not fitted in variant Std)
U1912  TS5A23166  [R-PDSO-G8]  (not fitted in variant Std)
U1921  TS5A23166  [R-PDSO-G8]  (not fitted in variant Std)
U1922  TS5A23166  [R-PDSO-G8]  (not fitted in variant Std)

### Nets
+3V3_BRIDGE_PWR: C1901.1 R1905.2 R1906.2 U1911.8 U1912.8 U1921.8 U1922.8 ; also sheet 18,21
ADC_MUX1_P1: C1911.1 L1911.1 R1901.2 U1911.1
ADC_MUX1_P1_L: L1911.2 R1911.1
ADC_MUX1_P5: C1961.1 L1961.1 R1902.2 U1911.5
ADC_MUX1_P5_L: L1961.2 R1961.1
ADC_MUX2_P1: C1921.1 L1921.2 R1903.1 U1921.1
ADC_MUX2_P1_L: L1921.1 R1921.2
ADC_MUX2_P5: C1971.1 L1971.2 R1904.1 U1921.5
ADC_MUX2_P5_L: L1971.1 R1971.2
ADC_MUX3_P1: C1912.1 L1912.1 U1912.1
ADC_MUX3_P1_L: L1912.2 R1912.1
ADC_MUX3_P5: C1962.1 L1962.1 U1912.5
ADC_MUX3_P5_L: L1962.2 R1962.1
ADC_MUX4_P1: C1922.1 L1922.2 U1922.1
ADC_MUX4_P1_L: L1922.1 R1922.2
ADC_MUX4_P5: C1972.1 L1972.2 U1922.5
ADC_MUX4_P5_L: L1972.1 R1972.2
ADC_MUX_GROUP0: R1990.2 U1911.3 U1911.7 U1921.3 U1921.7
ADC_MUX_GROUP1: R1991.2 U1912.3 U1912.7 U1922.3 U1922.7
ADC_VIN1N: R1902.1 U1911.6 U1912.6 ; also sheet 7
ADC_VIN1P: R1901.1 R1905.1 U1911.2 U1912.2 ; also sheet 7
ADC_VIN2N: R1904.2 U1921.6 U1922.6 ; also sheet 7
ADC_VIN2P: R1903.2 R1906.1 U1921.2 U1922.2 ; also sheet 7
BRIDGE_N1: R1961.2 ; also sheet 21
BRIDGE_N2: R1971.1 ; also sheet 21
BRIDGE_N3: R1962.2 ; also sheet 21
BRIDGE_N4: R1972.1 ; also sheet 21
BRIDGE_P1: R1911.2 ; also sheet 21
BRIDGE_P2: R1921.1 ; also sheet 21
BRIDGE_P3: R1912.2 ; also sheet 21
BRIDGE_P4: R1922.1 ; also sheet 21
GND: C1901.2 C1911.2 C1912.2 C1921.2 C1922.2 C1961.2 C1962.2 C1971.2 C1972.2 U1911.4 U1912.4 U1921.4 U1922.4 ; also sheet 1,2,3,4,6,7,8,9,10,11,12,13,14,15,16,17,18,20,21,22
PH0: R1990.1 ; also sheet 1
PH1: R1991.1 ; also sheet 1

### Buses
BRIDGE_P[1..4],BRIDGE_N[1..4],+3V3_BRIDGE_PWR,GND

### Notes on the sheet
- ADC MUXER for bridge input lines
- ADC MUXER
- GPIO_MUXG0_EN | GPIO_MUXG1_EN

## Sheet 20 of 22: Batteries - Reed contact
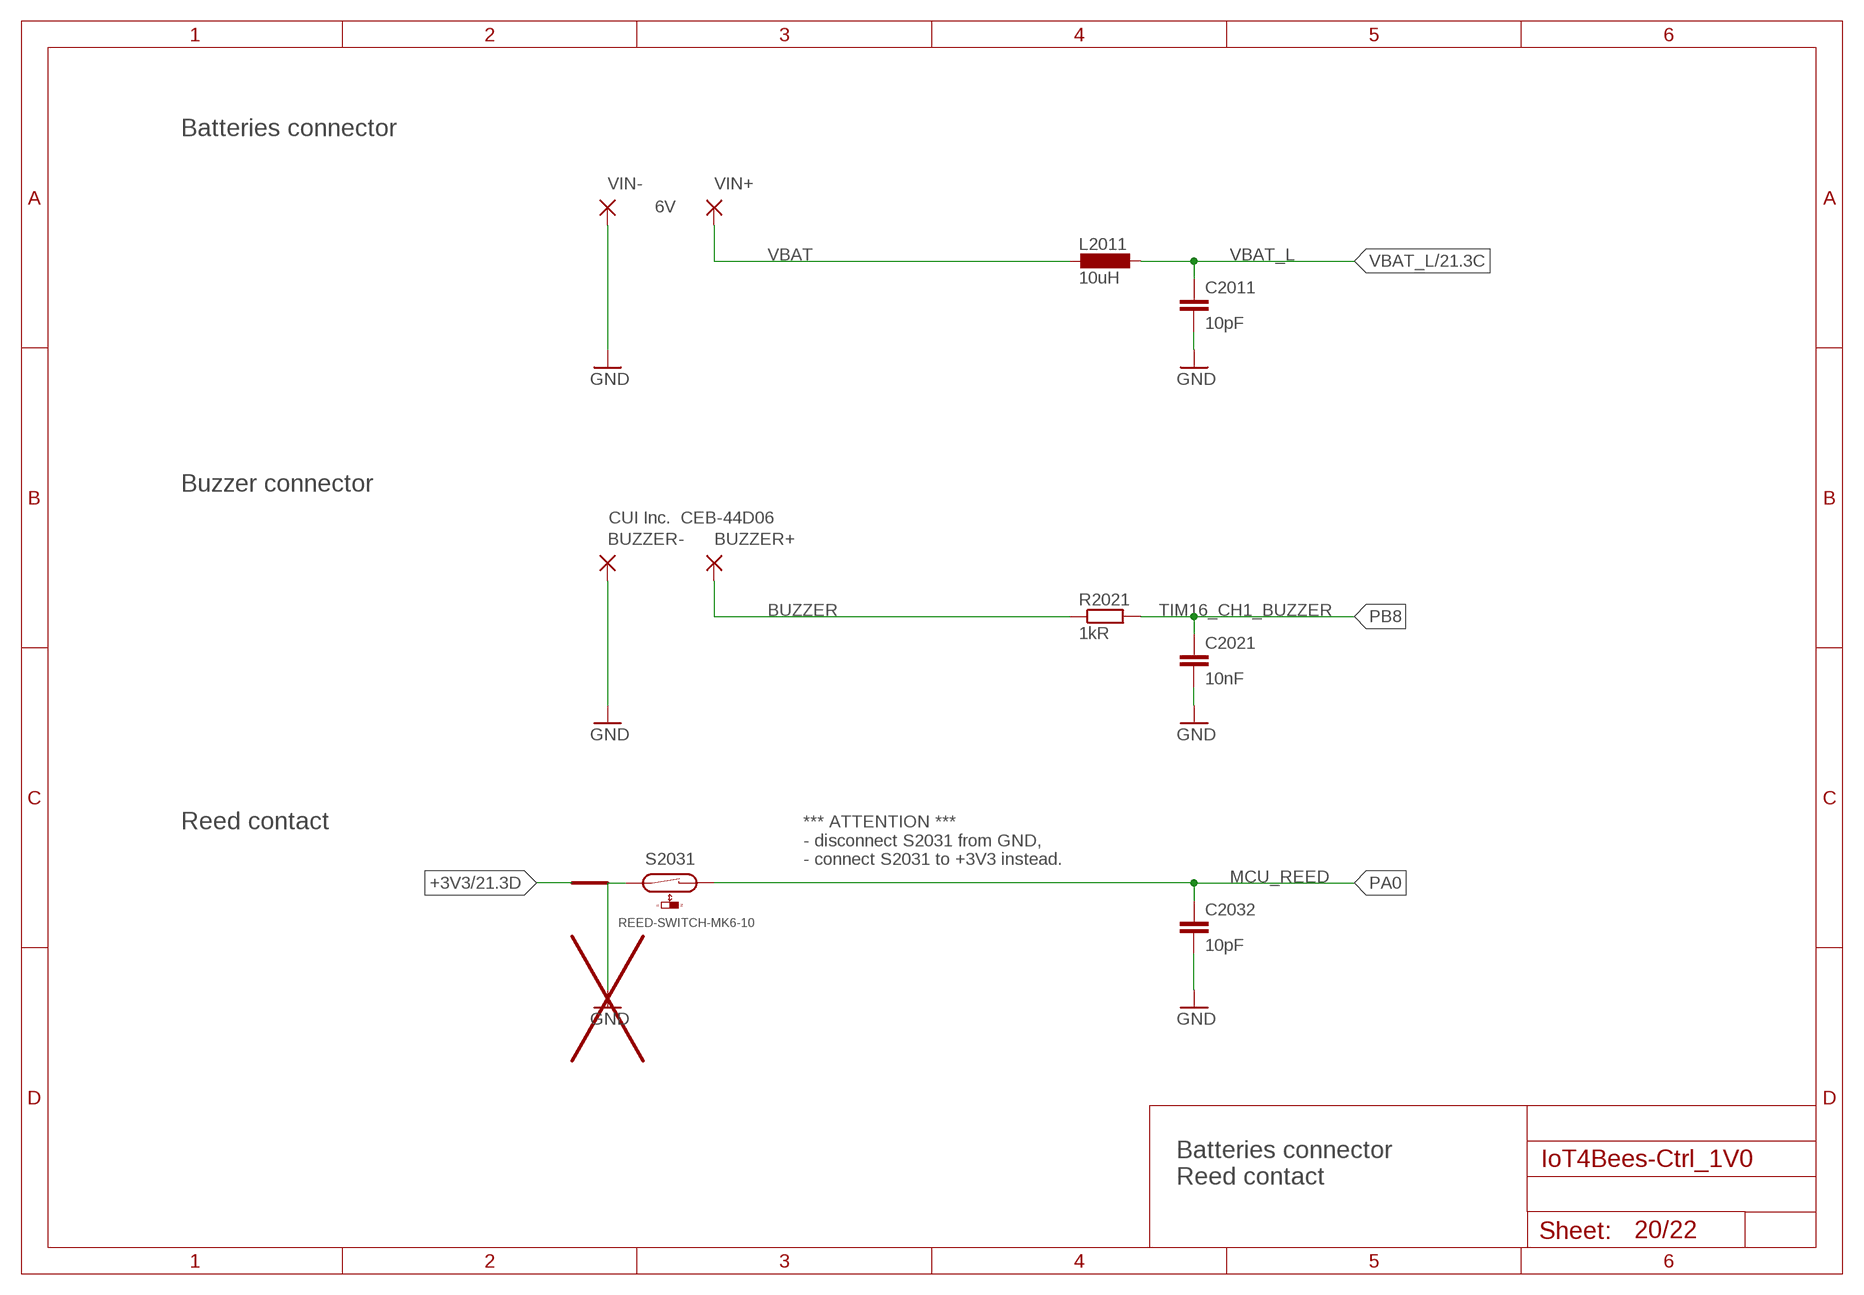
[diagram p19: schematic, sheet 20]

### Parts
BUZZER+  CUI Inc. CEB-44D06  SMD5  [SMD2,54-5,08]
BUZZER-  CUI Inc. CEB-44D06  SMD5  [SMD2,54-5,08]
C2011  10pF  C-EUC0402  [C0402]
C2021  10nF  C-EUC0402  [C0402]
C2032  10pF  C-EUC0402  [C0402]
L2011  10uH  L-EUL0603  [L0603]
R2021  1kR  R-EU_R0402  [R0402]
S2031  REED-SWITCH-MK6-10  [MK6-10]
VIN+  6V  SMD5  [SMD2,54-5,08]
VIN-  6V  SMD5  [SMD2,54-5,08]

### Nets
BUZZER: BUZZER+.1(P) R2021.1
GND: BUZZER-.1(P) C2011.2 C2021.2 C2032.2 S2031.2 VIN-.1(P) ; also sheet 1,2,3,4,6,7,8,9,10,11,12,13,14,15,16,17,18,19,21,22
PA0: C2032.1 S2031.1 ; also sheet 1
PB8: C2021.1 R2021.2 ; also sheet 1
VBAT: L2011.2 VIN+.1(P)
VBAT_L: C2011.1 L2011.1 ; also sheet 13,18,21

### Notes on the sheet
- Batteries connector
- Buzzer connector
- TIM16_CH1_BUZZER
- Reed contact
- *** ATTENTION ***
  - disconnect S2031 from GND,
  - connect S2031 to +3V3 instead.
- MCU_REED
- Batteries connector
  Reed contact

## Sheet 21 of 22: Connectors
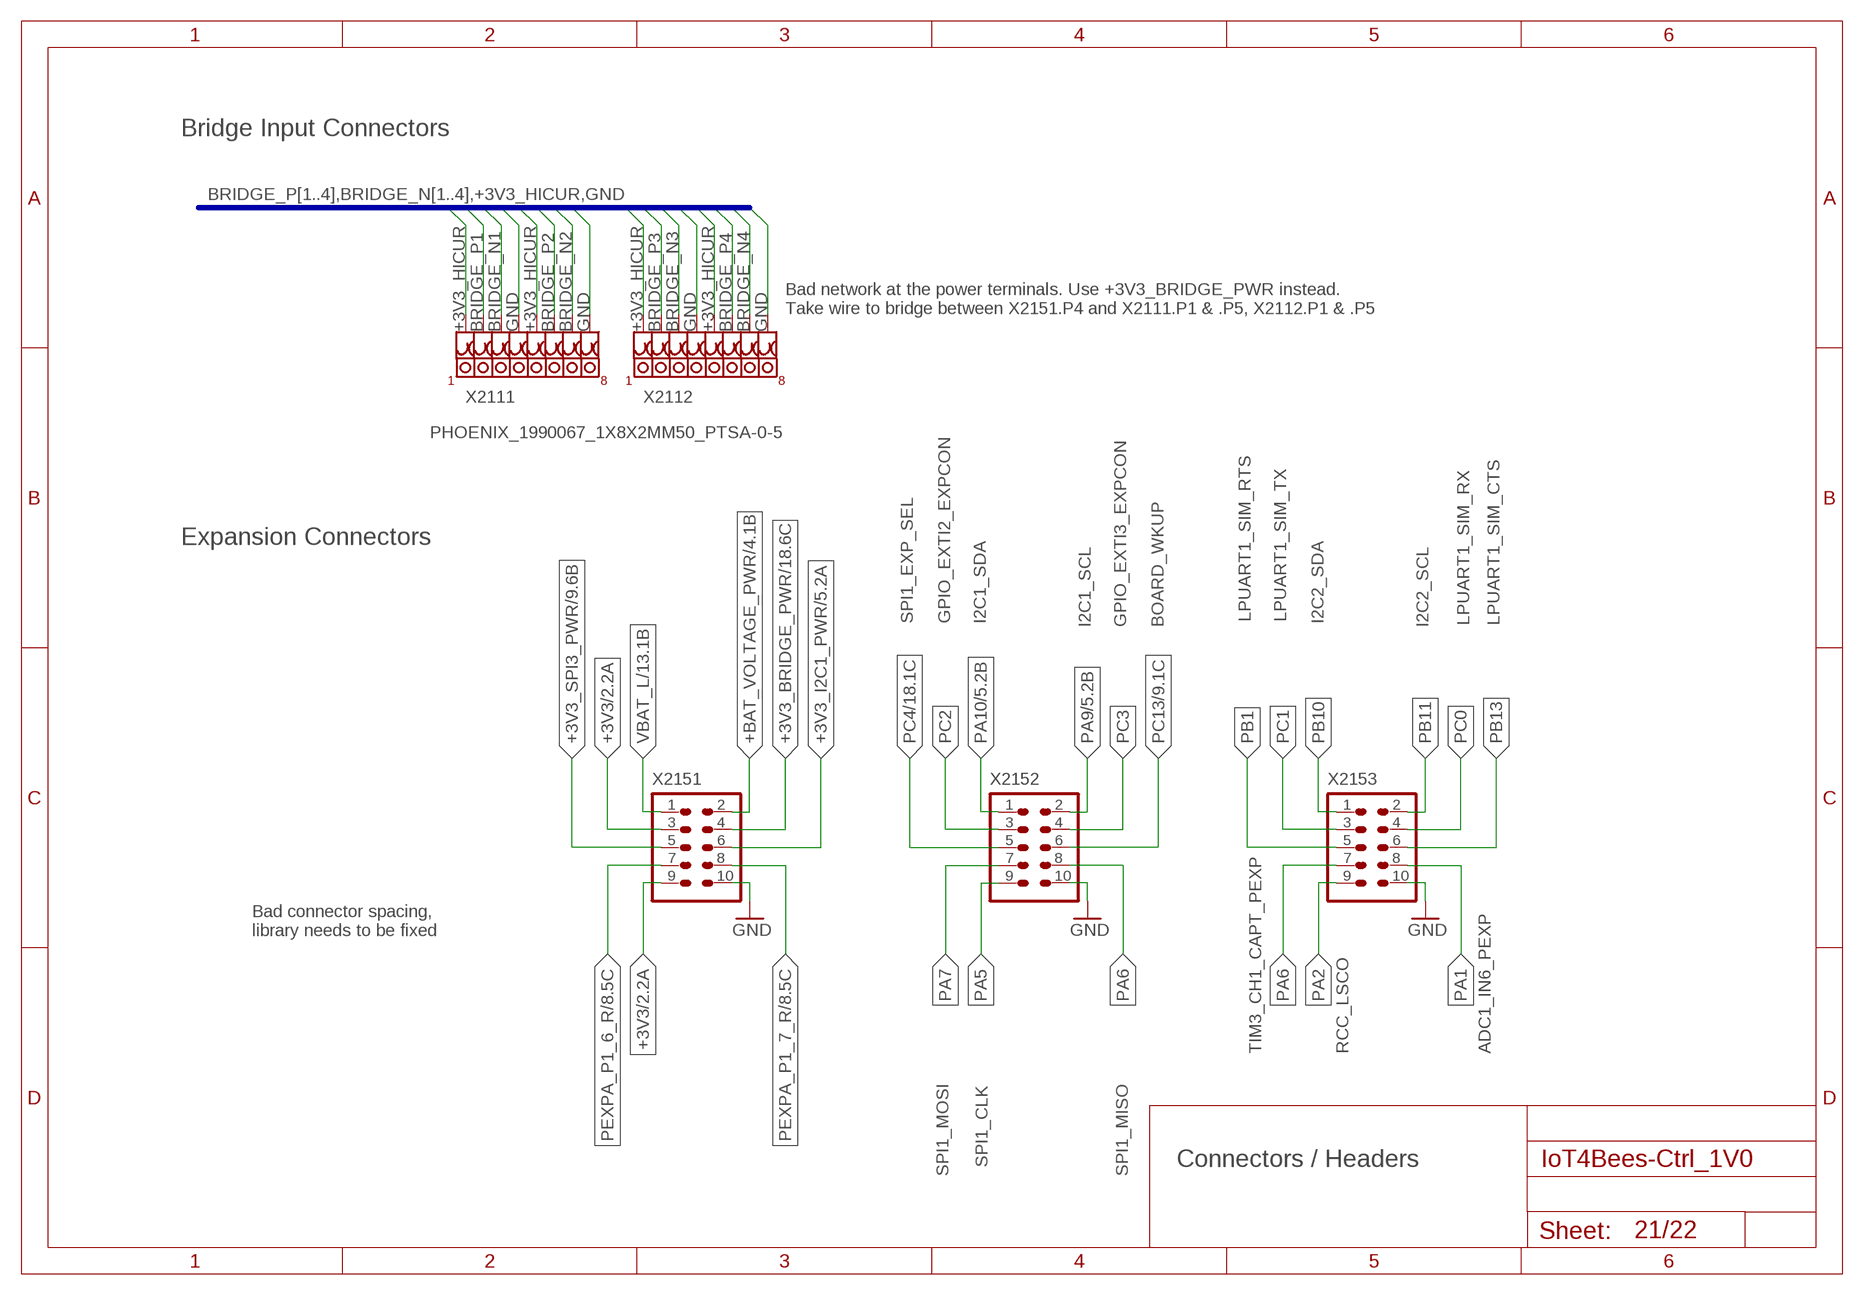
[diagram p20: schematic, sheet 21]

### Parts
X2111  PHOENIX_1990067_1X8X2MM50_PTSA-0-5  [PHOENIX_1990067_1X8X2MM50_PTSA-0-5]
X2112  PHOENIX_1990067_1X8X2MM50_PTSA-0-5  [PHOENIX_1990067_1X8X2MM50_PTSA-0-5]  (not fitted in variant Std)
X2151  HEADER-2X5_1MM27_BAD  [2X05_1MM27_BAD]  (not fitted in variant Std)
X2152  HEADER-2X5_1MM27_BAD  [2X05_1MM27_BAD]  (not fitted in variant Std)
X2153  HEADER-2X5_1MM27_BAD  [2X05_1MM27_BAD]  (not fitted in variant Std)

### Nets
+3V3: X2151.3 X2151.9 ; also sheet 2,4,13,14,15,16,17,18,20
+3V3_BRIDGE_PWR: X2151.4 ; also sheet 18,19
+3V3_HICUR: X2111.1 X2111.5 X2112.1 X2112.5
+3V3_I2C1_PWR: X2151.6 ; also sheet 5,6,7,8,11,15
+3V3_SPI3_PWR: X2151.5 ; also sheet 9,10,16
+BAT_VOLTAGE_PWR: X2151.2 ; also sheet 4,18
BRIDGE_N1: X2111.3 ; also sheet 19
BRIDGE_N2: X2111.7 ; also sheet 19
BRIDGE_N3: X2112.3 ; also sheet 19
BRIDGE_N4: X2112.7 ; also sheet 19
BRIDGE_P1: X2111.2 ; also sheet 19
BRIDGE_P2: X2111.6 ; also sheet 19
BRIDGE_P3: X2112.2 ; also sheet 19
BRIDGE_P4: X2112.6 ; also sheet 19
GND: X2111.4 X2111.8 X2112.4 X2112.8 X2151.10 X2152.10 X2153.10 ; also sheet 1,2,3,4,6,7,8,9,10,11,12,13,14,15,16,17,18,19,20,22
PA1: X2153.8 ; also sheet 1
PA2: X2153.9 ; also sheet 1
PA5: X2152.9 ; also sheet 1
PA6: X2152.8 X2153.7 ; also sheet 1
PA7: X2152.7 ; also sheet 1
PA9: X2152.2 ; also sheet 1,5,6,7,8,11
PA10: X2152.1 ; also sheet 1,5,6,7,8,11
PB1: X2153.5 ; also sheet 1
PB10 [mil6_nofill]: X2153.1 ; also sheet 1
PB11: X2153.2 ; also sheet 1
PB13 [mil6_nofill]: X2153.6 ; also sheet 1
PC0 [mil6_nofill]: X2153.4 ; also sheet 1
PC1: X2153.3 ; also sheet 1
PC2 [mil6_nofill]: X2152.3 ; also sheet 1
PC3: X2152.4 ; also sheet 1
PC4: X2152.5 ; also sheet 1,18
PC13: X2152.6 ; also sheet 1,9
PEXPA_P1_6_R: X2151.7 ; also sheet 8
PEXPA_P1_7_R: X2151.8 ; also sheet 8
VBAT_L: X2151.1 ; also sheet 13,18,20

### Buses
BRIDGE_P[1..4],BRIDGE_N[1..4],+3V3_HICUR,GND

### Notes on the sheet
- Bridge Input Connectors
- Bad network at the power terminals. Use +3V3_BRIDGE_PWR instead.
  Take wire to bridge between X2151.P4 and X2111.P1 & .P5, X2112.P1 & .P5
- Expansion Connectors
- SPI1_EXP_SEL | GPIO_EXTI2_EXPCON | I2C1_SDA | LPUART1_SIM_RTS | LPUART1_SIM_TX | I2C2_SDA | LPUART1_SIM_RX | LPUART1_SIM_CTS
- I2C1_SCL | GPIO_EXTI3_EXPCON | BOARD_WKUP | I2C2_SCL
- Bad connector spacing,
  library needs to be fixed
- TIM3_CH1_CAPT_PEXP | RCC_LSCO | ADC1_IN6_PEXP
- SPI1_CLK | Connectors / Headers
- SPI1_MOSI | SPI1_MISO

## Sheet 22 of 22: Mounting holes
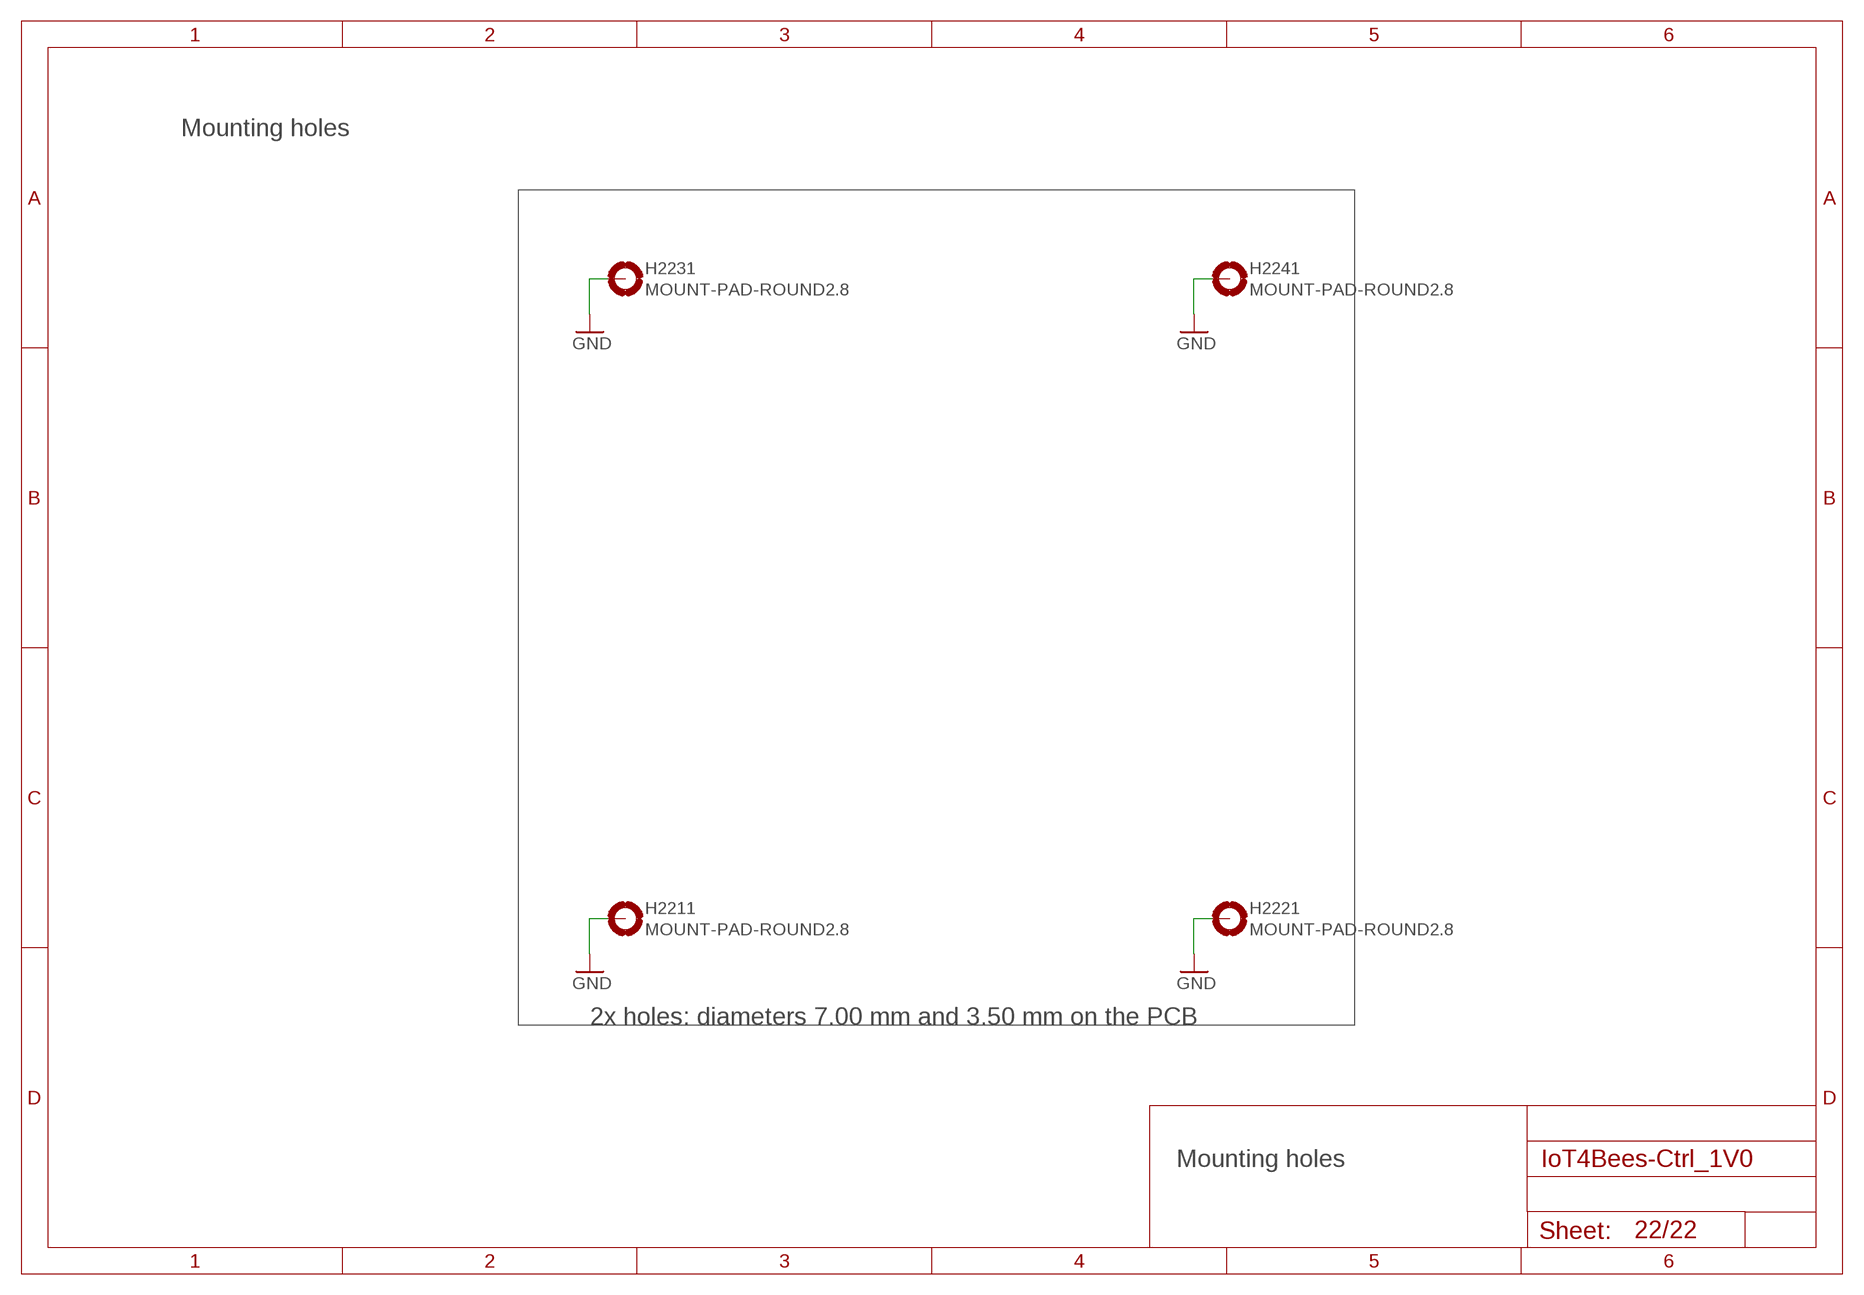
[diagram p21: schematic, sheet 22]

### Parts
H2211  MOUNT-PAD-ROUND2.8  [2,8-PAD]
H2221  MOUNT-PAD-ROUND2.8  [2,8-PAD]
H2231  MOUNT-PAD-ROUND2.8  [2,8-PAD]
H2241  MOUNT-PAD-ROUND2.8  [2,8-PAD]

### Nets
GND: H2211.B2,8(MOUNT) H2221.B2,8(MOUNT) H2231.B2,8(MOUNT) H2241.B2,8(MOUNT) ; also sheet 1,2,3,4,6,7,8,9,10,11,12,13,14,15,16,17,18,19,20,21

### Notes on the sheet
- Mounting holes
- 2x holes: diameters 7.00 mm and 3.50 mm on the PCB
- Mounting holes

## Library data of the parts
BUZZER+ BUZZER- VIN+ VIN- = wirepad:SMD5: SMD PAD
C0213 C0311 C0332 C0401-C0403 C0410 C0412 C0413 C0451 C0461 C0601 C0701 C0702 C0711 C0721-C0724 C0751 C0752 C0801 C0901-C0903 C0921 C0922 C1001-C1005 C1063-C1067 C1071 C1072 C1081-C1083 C1091-C1093 C1113 C1201 C1202 C1301 C1321 C1401 C1421 C1501 C1502 C1521 C1591 C1592 C1601 C1701 C1801 C1802 C1901 C1911 C1912 C1921 C1922 C1961 C1962 C1971 C1972 C2011 C2021 C2032 = df4iah_rcl:C-EU: CAPACITOR, European symbol
C0331 = df4iah_c-trimm:C-TRIMM: Trimm capacitor
D0901 = df4iah_diode:D_SOD923: DIODE with SOD923 footprint
H2211 H2221 H2231 H2241 = df4iah_holes:MOUNT-PAD-ROUND: MOUNTING PAD, round
L0411 L1001 L1002 L1062-L1064 L1082 L1091 L1311 L1411 L1911 L1912 L1921 L1922 L1961 L1962 L1971 L1972 L2011 = df4iah_rcl:L-EU: INDUCTOR, European symbol
Q0321 Q0921 = df4iah_crystal:ABS07-32.768KHZ: ABRACON ABS07 32.768 kHz SMD LOW PROFILE CRYSTAL Source: http://www.abracon.com/Resonators/ABS07.pdf; FARNELL: 2467865; MANUFACTURER: ABS07-32.768KHZ-1-T
Q1011 = df4iah_crystal:ABM3B: ABM3B Ceramic SMD Crystal Package: 5mm x 3.2mm x 1.1mm Variants: 16.0000 MHz 32.0000 MHz
R0201 R0202 R0221 R0401 R0421 R0441 R0461 R0462 R0511 R0512 R0731 R0802 R0811 R0901-R0904 R0931 R0932 R1011 R1021 R1024 R1051-R1053 R1071 R1111 R1112 R1257 R1266 R1271 R1272 R1901-R1906 R1911 R1912 R1921 R1922 R1961 R1962 R1971 R1972 R1990 R1991 R2021 = df4iah_rcl:R-EU_: RESISTOR, European symbol
S0212 = df4iah_switch:KSR223G_SMD_1POL: KSR223G KSR Series Subminiature Tact Switch for SMT
S2031 = switch-reed:REED-SWITCH-: Reed Sensor; OC_FARNELL: unknown
TP_+1V2_MCU TP_+3V3_BRIDGES TP_+3V3_I2C1 TP_+3V3_SPI3 TP_+3V3_USART1 TP_BAT_VOLTAGE TP_SX_DIO1-TP_SX_DIO3 TP_VBAT = testpad:PTR1: TEST PIN
U0101 = df4iah_stm32l4:STM32L452RET_64PIN_SMPS: STM32L452RET6P 64LQFP
U0611 = df4iah_memory:FEDR44V064B-02_FRAM_8K-8_I2C: FEDR44V064B-02 / MR44V064B 64k Bit(8,192-Word × 8-Bit) FeRAM (Ferroelectric Random Access Memory) I2C 8,192-word × 8-bit configuration I2C BUS Interface A single 3.3 V typ (1.8V to 3.6V) power supply Operating frequency: 3.4MHz(Max) HS-mode 1MHz(Max) F/S-mode Plus Read/write tolerance 1012 cycles/bit Data retention 10 years Guaranteed operating temperature range −40 to 85°C Package options: 8-pin plastic SOP (P-SOP8-200-1.27-T2K) RoHS (Restriction of hazardous substances) compliant
U0711 = df4iah_adc:NAU7802_24BIT_I2C: NAU7802 24-Bit Dual-Channel ADC for Bridge Sensors I²C Interface
U0751 = df4iah_powersupply:MAX6129_VREF: MAX6129 Ultra-Low-Power Series Voltage Reference Ultra-Low 5.25μA (max) Supply Current 4mA Output Source Current 1mA Output Sink Current ±0.4% (max) Initial Accuracy 40ppm/°C (max) Temperature Coefficient 2.5V to 12.6V Supply Range Low 200mV Dropout Stable with Capacitive Loads Up to 10μF No External Capacitors Required Miniature 5-Pin SOT23 Package
U0811 U1111 = df4iah_dataconvertion:PCAL6416A: NXP PCAL6416A Low-voltage translating 16-bit I²C-bus/SMBus I/O expander with interrupt output, reset, and configuration registers
U0911 = df4iah_sensors:BNO085: hillcrestlabs BNO085 triaxial Accelerometer triaxial Gyroscope triaxial Magnetometer 32-bit ARM® Cortex™-M0+ Low latency, 1kHz gyro rotation vector 28 pin LGA 3.8mm x 5.2mm x 1.1mm package
U1001 = df4iah_rf:SX1261: Semtech SX1261/2 Long Range, Low Power, sub-GHz RF Transceiver FRF = 434/490/868/915 MHz FXOSC = 32 MHz Synthesizer frequency range: 150 - 960 MHz Synthesizer frequency step: 0.95 Hz
U1071 = df4iah_rf:PE4259: pSemi PE4259 SPDT High Power UltraCMOS® 10 MHz–3.0 GHz RF Switch Low insertion loss: 0.35 dB @ 1000 MHz, 0.5 dB @ 2000 MHz Isolation of 30 dB @ 1000 MHz Typical input 1 dB compression point of +33.5 dBm 6-lead SC-70 package Reference: http://www.psemi.com/products/rf-switches/pe4259
U1211 = df4iah_rf:ESP-12F__2P00_24MM-X-16MM: AI-THINKER ESP-12F based on ESP8266
U1311 = df4iah_powersupply:TPS62745: TPS62745 Dual-cell Ultra Low IQ Step Down Converter for Low Power Wireless Applications Input Voltage Range VIN from 3.3 V to 10 V Typical 400 nA Quiescent Current Up to 90% efficiency with load currents >15 μA Up to 300 mA Output Current RF Friendly DCS-Control™ Low Output Ripple Voltage 16 Selectable Output Voltages from 1.8 V to 3.3 V (TPS62745) 1.3 V to 2.8 V (TPS627451) Integrated input voltage switch Integrated Discharge Function at VOUT Open Drain Power Good Output Operates with a Tiny 3.3 μH or 4.7 μH Inductor Small 3 mm x 2 mm WSON Package
U1411 = df4iah_powersupply:TPS62743: TPS62743 300/400 mA High Efficiency Buck Converter with Ultra-low Quiescent Current Input Voltage Range VIN from 2.15 V to 5.5 V Input Voltage Range Down to 2.0 V Once Started Output Current TPS62743 300 mA TPS627431 400mA 360 nA Operational Quiescent Current Up to 90% Efficiency at 10-μA Output Current Power Save Mode Operation Selectable Output Voltages 8 voltage options between 1.2 V to 3.3 V Output Voltage Discharge Low Output Voltage Ripple Automatic Transition to No Ripple 100% Mode RF Friendly DCS-Control™ Total Solution Size <10mm2 Small 1.6 mm × 0.9 mm, 8 Ball WCSP Package
U1511 U1601 U1701 U1801 U1911 U1912 U1921 U1922 = df4iah_sc-switches:TS5A23166: TS5A23166 0.9-Ω Dual-SPST Analog Switch
X0201 = df4iah_connector:2X05_1MM27_SHROUDED_CORTEX_JTAG_SWD: Header 2X5 1.27mm 0.05" shrouded - CORTEX JTAG-SWD SAMTEC FTSH-105-01-F-D-K HARWIN M50-3500542
X0222 = df4iah_connector:HEADER-1X2: Header 1X2 2.54mm
X1081 = _c2h:ANTENNA: SMA Antenna Connector End launch SMA connector. The paste layer has been removed so that the connector can be hand soldered onto the board after reflow.
X2111 X2112 = df4iah_connector:PHOENIX_1990067_1X8X2MM50_PTSA-0-5: PCB terminal block - PTSA 0,5/8-2,5-Z - 1990067 PCB terminal block, nominal current: 2 A, nom. voltage: 250 V, pitch: 2.5 mm, number of positions: 8, connection method: Push-in spring connection, mounting: Wave soldering, conductor/PCB connection direction: 45 °
X2151-X2153 = df4iah_connector:HEADER-2X5_1MM27_BAD: Header 2X5 1.27mm 0.05" bad spacing between the rows!

## Net classes
0 default: drill 0.3 mm
1 pwr_relay: width 1.5 mm, clearance 0.5 mm
2 pwr_ttl: width 0.75 mm, clearance 0.5 mm
3 usb_pair: width 0.254 mm, clearance 0.152 mm
4 pwrA5: width 0.4 mm
5 single50R: width 0.838 mm, clearance 0.152 mm
6 mil6_nofill: width 0.152 mm, clearance 0.254 mm